# EAGLE schematic pdp8i-io (EAGLE 6.6.0), part 1 of 2

## Sheet 1 of 40
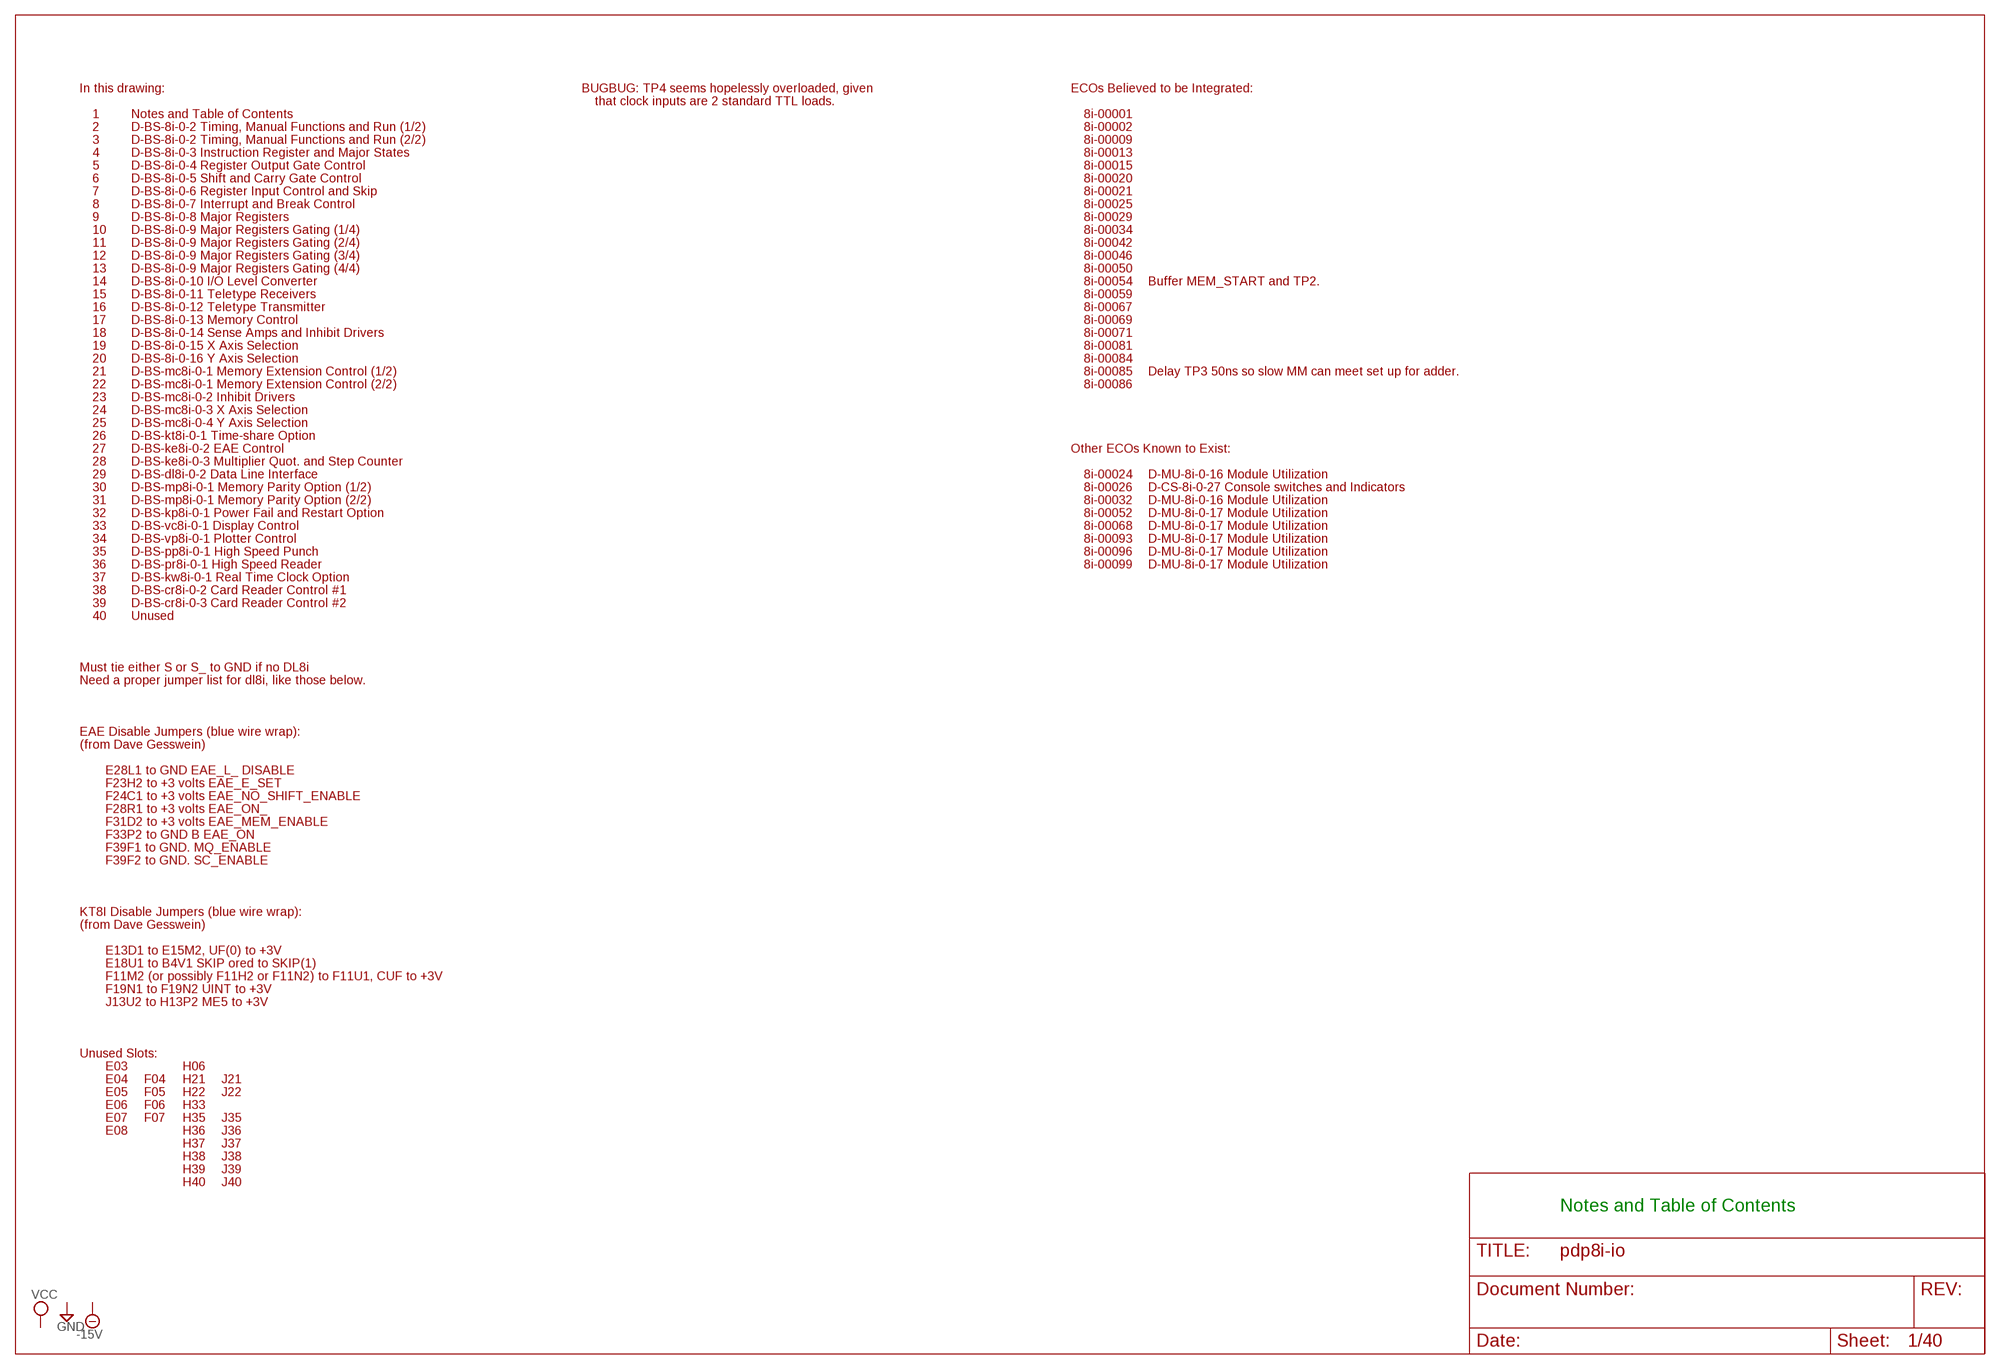
[diagram p0: schematic, sheet 1]

### Parts
E03  EMPTY  [H807]
E04  EMPTY  [H807]
E05  EMPTY  [H807]
E06  EMPTY  [H807]
E07  EMPTY  [H807]
E08  EMPTY  [H807]
F04  EMPTY  [H807]
F05  EMPTY  [H807]
F06  EMPTY  [H807]
F07  EMPTY  [H807]
H06  EMPTY  [H807]
H21  EMPTY  [H807]
H22  EMPTY  [H807]
H33  EMPTY  [H807]
H35  EMPTY  [H807]
H36  EMPTY  [H807]
H37  EMPTY  [H807]
H38  EMPTY  [H807]
H39  EMPTY  [H807]
H40  EMPTY  [H807]
J21  EMPTY  [H807]
J22  EMPTY  [H807]
J35  EMPTY  [H807]
J36  EMPTY  [H807]
J37  EMPTY  [H807]
J38  EMPTY  [H807]
J39  EMPTY  [H807]
J40  EMPTY  [H807]

### Notes on the sheet
- In this drawing: | BUGBUG: TP4 seems hopelessly overloaded, given | ECOs Believed to be Integrated:
- that clock inputs are 2 standard TTL loads.
- 1 | Notes and Table of Contents | 8i-00001
- 2 | D-BS-8i-0-2 Timing, Manual Functions and Run (1/2) | 8i-00002
- 3 | D-BS-8i-0-2 Timing, Manual Functions and Run (2/2) | 8i-00009
- 4 | D-BS-8i-0-3 Instruction Register and Major States | 8i-00013
- 5 | D-BS-8i-0-4 Register Output Gate Control | 8i-00015
- 6 | D-BS-8i-0-5 Shift and Carry Gate Control | 8i-00020
- 7 | D-BS-8i-0-6 Register Input Control and Skip | 8i-00021
- 8 | D-BS-8i-0-7 Interrupt and Break Control | 8i-00025
- 9 | D-BS-8i-0-8 Major Registers | 8i-00029
- 10 | D-BS-8i-0-9 Major Registers Gating (1/4) | 8i-00034
- 11 | D-BS-8i-0-9 Major Registers Gating (2/4) | 8i-00042
- 12 | D-BS-8i-0-9 Major Registers Gating (3/4) | 8i-00046
- 13 | D-BS-8i-0-9 Major Registers Gating (4/4) | 8i-00050
- 14 | D-BS-8i-0-10 I/O Level Converter | 8i-00054 | Buffer MEM_START and TP2.
- 15 | D-BS-8i-0-11 Teletype Receivers | 8i-00059
- 16 | D-BS-8i-0-12 Teletype Transmitter | 8i-00067
- 17 | D-BS-8i-0-13 Memory Control | 8i-00069
- 18 | D-BS-8i-0-14 Sense Amps and Inhibit Drivers | 8i-00071
- 19 | D-BS-8i-0-15 X Axis Selection | 8i-00081
- 20 | D-BS-8i-0-16 Y Axis Selection | 8i-00084
- 21 | D-BS-mc8i-0-1 Memory Extension Control (1/2) | 8i-00085 | Delay TP3 50ns so slow MM can meet set up for adder.
- 22 | D-BS-mc8i-0-1 Memory Extension Control (2/2) | 8i-00086
- 23 | D-BS-mc8i-0-2 Inhibit Drivers
- 24 | D-BS-mc8i-0-3 X Axis Selection
- 25 | D-BS-mc8i-0-4 Y Axis Selection
- 26 | D-BS-kt8i-0-1 Time-share Option
- 27 | D-BS-ke8i-0-2 EAE Control | Other ECOs Known to Exist:
- 28 | D-BS-ke8i-0-3 Multiplier Quot. and Step Counter
- 29 | D-BS-dl8i-0-2 Data Line Interface | 8i-00024 | D-MU-8i-0-16 Module Utilization
- 30 | D-BS-mp8i-0-1 Memory Parity Option (1/2) | 8i-00026 | D-CS-8i-0-27 Console switches and Indicators
- 31 | D-BS-mp8i-0-1 Memory Parity Option (2/2) | 8i-00032 | D-MU-8i-0-16 Module Utilization
- 32 | D-BS-kp8i-0-1 Power Fail and Restart Option | 8i-00052 | D-MU-8i-0-17 Module Utilization
- 33 | D-BS-vc8i-0-1 Display Control | 8i-00068 | D-MU-8i-0-17 Module Utilization
- 34 | D-BS-vp8i-0-1 Plotter Control | 8i-00093 | D-MU-8i-0-17 Module Utilization
- 35 | D-BS-pp8i-0-1 High Speed Punch | 8i-00096 | D-MU-8i-0-17 Module Utilization
- 36 | D-BS-pr8i-0-1 High Speed Reader | 8i-00099 | D-MU-8i-0-17 Module Utilization
- 37 | D-BS-kw8i-0-1 Real Time Clock Option
- 38 | D-BS-cr8i-0-2 Card Reader Control #1
- 39 | D-BS-cr8i-0-3 Card Reader Control #2
- 40 | Unused
- Must tie either S or S_ to GND if no DL8i
- Need a proper jumper list for dl8i, like those below.
- EAE Disable Jumpers (blue wire wrap):
- (from Dave Gesswein)
- E28L1 to GND EAE_L_ DISABLE
- F23H2 to +3 volts EAE_E_SET
- F24C1 to +3 volts EAE_NO_SHIFT_ENABLE
- F28R1 to +3 volts EAE_ON_
- F31D2 to +3 volts EAE_MEM_ENABLE
- F33P2 to GND B EAE_ON
- F39F1 to GND. MQ_ENABLE
- F39F2 to GND. SC_ENABLE
- KT8I Disable Jumpers (blue wire wrap):
- (from Dave Gesswein)
- E13D1 to E15M2, UF(0) to +3V
- E18U1 to B4V1 SKIP ored to SKIP(1)
- F11M2 (or possibly F11H2 or F11N2) to F11U1, CUF to +3V
- F19N1 to F19N2 UINT to +3V
- J13U2 to H13P2 ME5 to +3V
- Unused Slots:
- Notes and Table of Contents

## Sheet 2 of 40
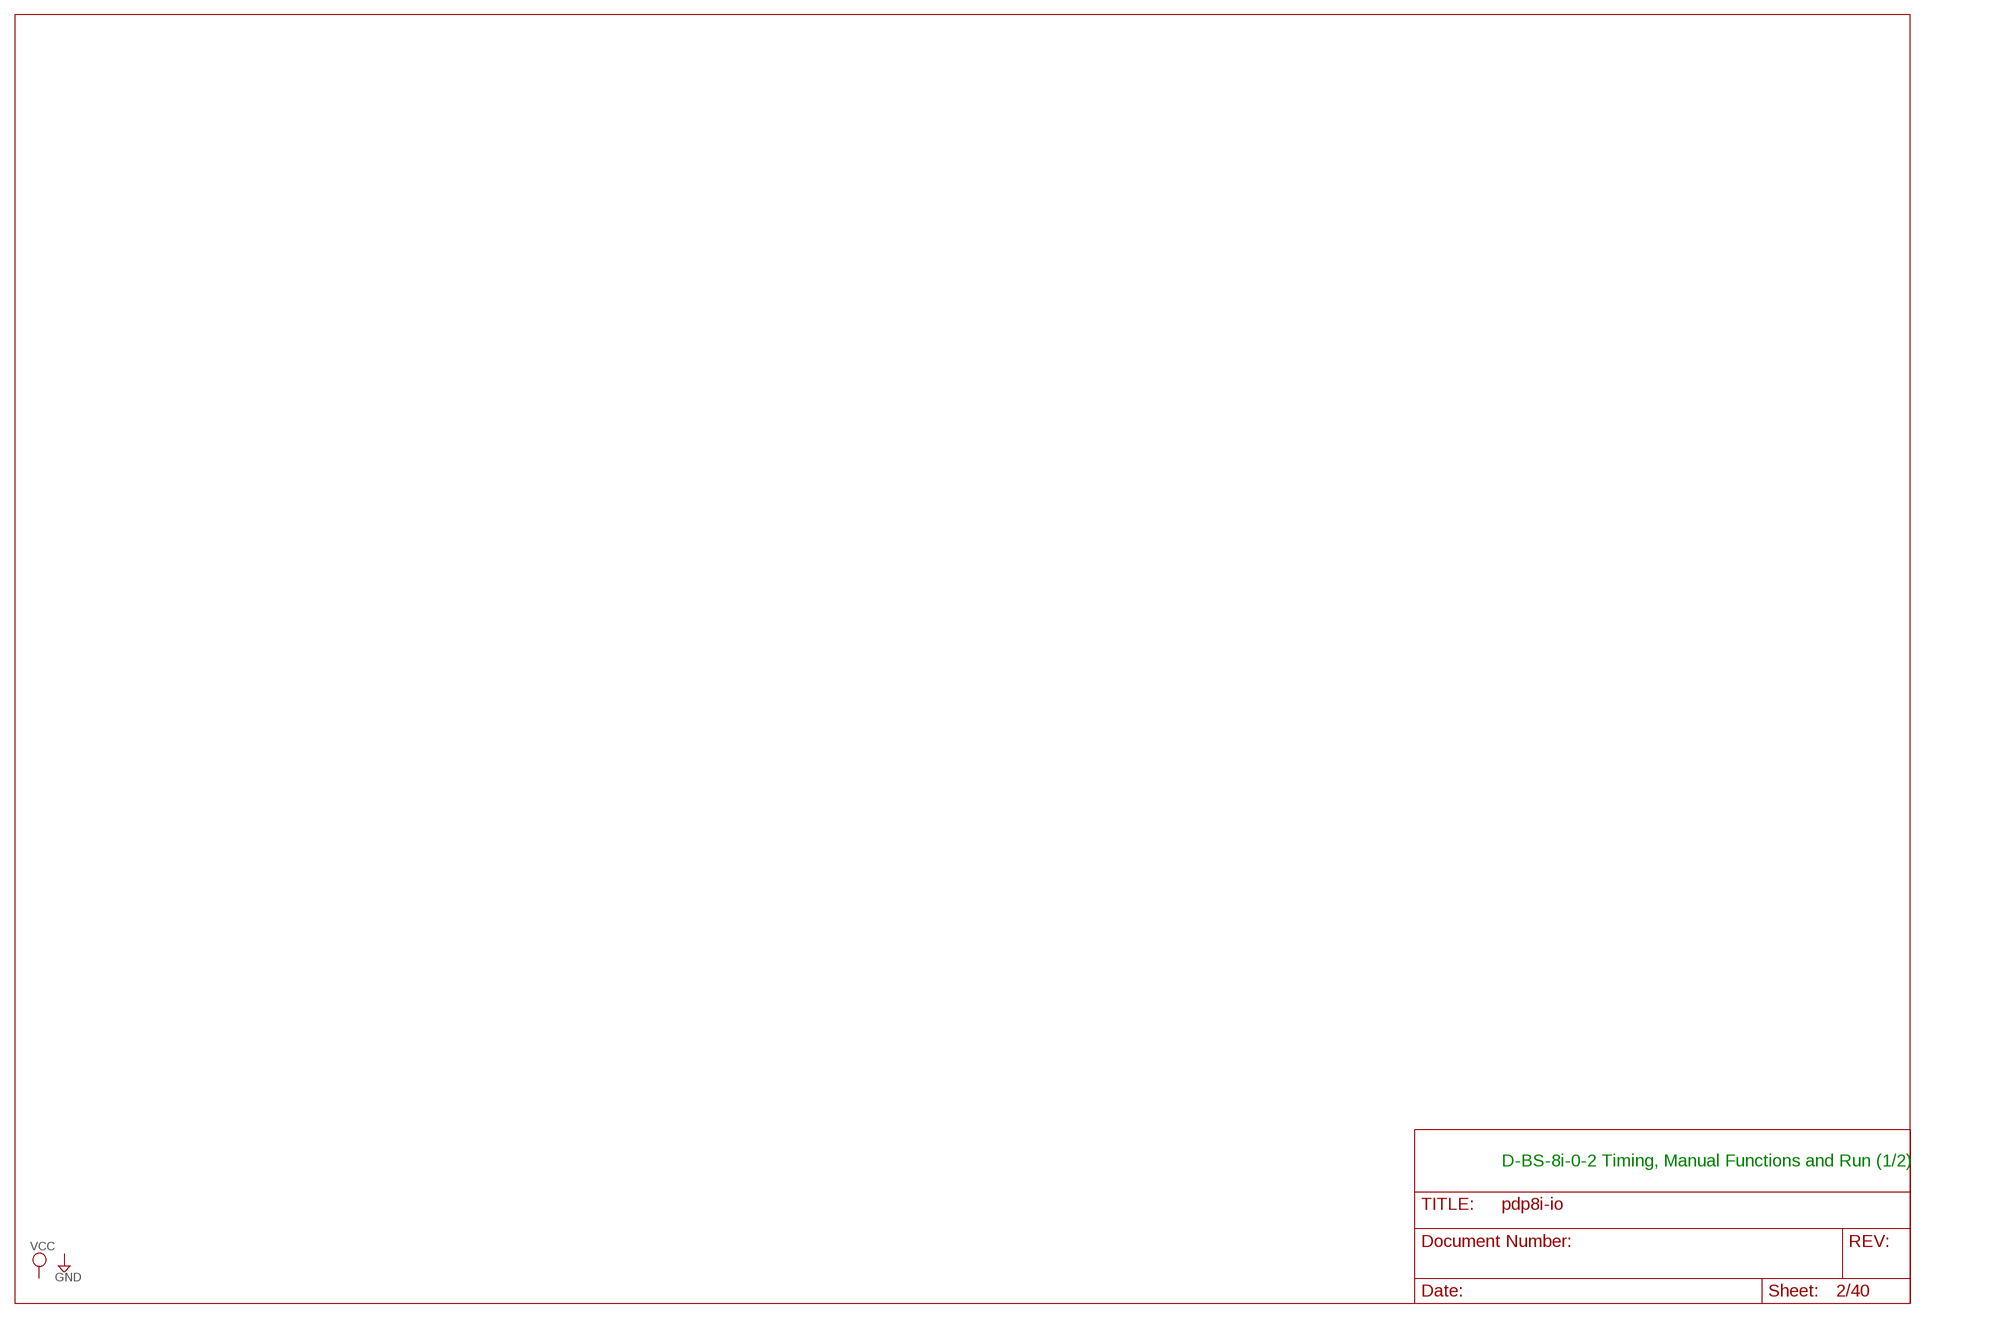
[diagram p1: schematic, sheet 2]

### Notes on the sheet
- D-BS-8i-0-2 Timing, Manual Functions and Run (1/2)

## Sheet 3 of 40
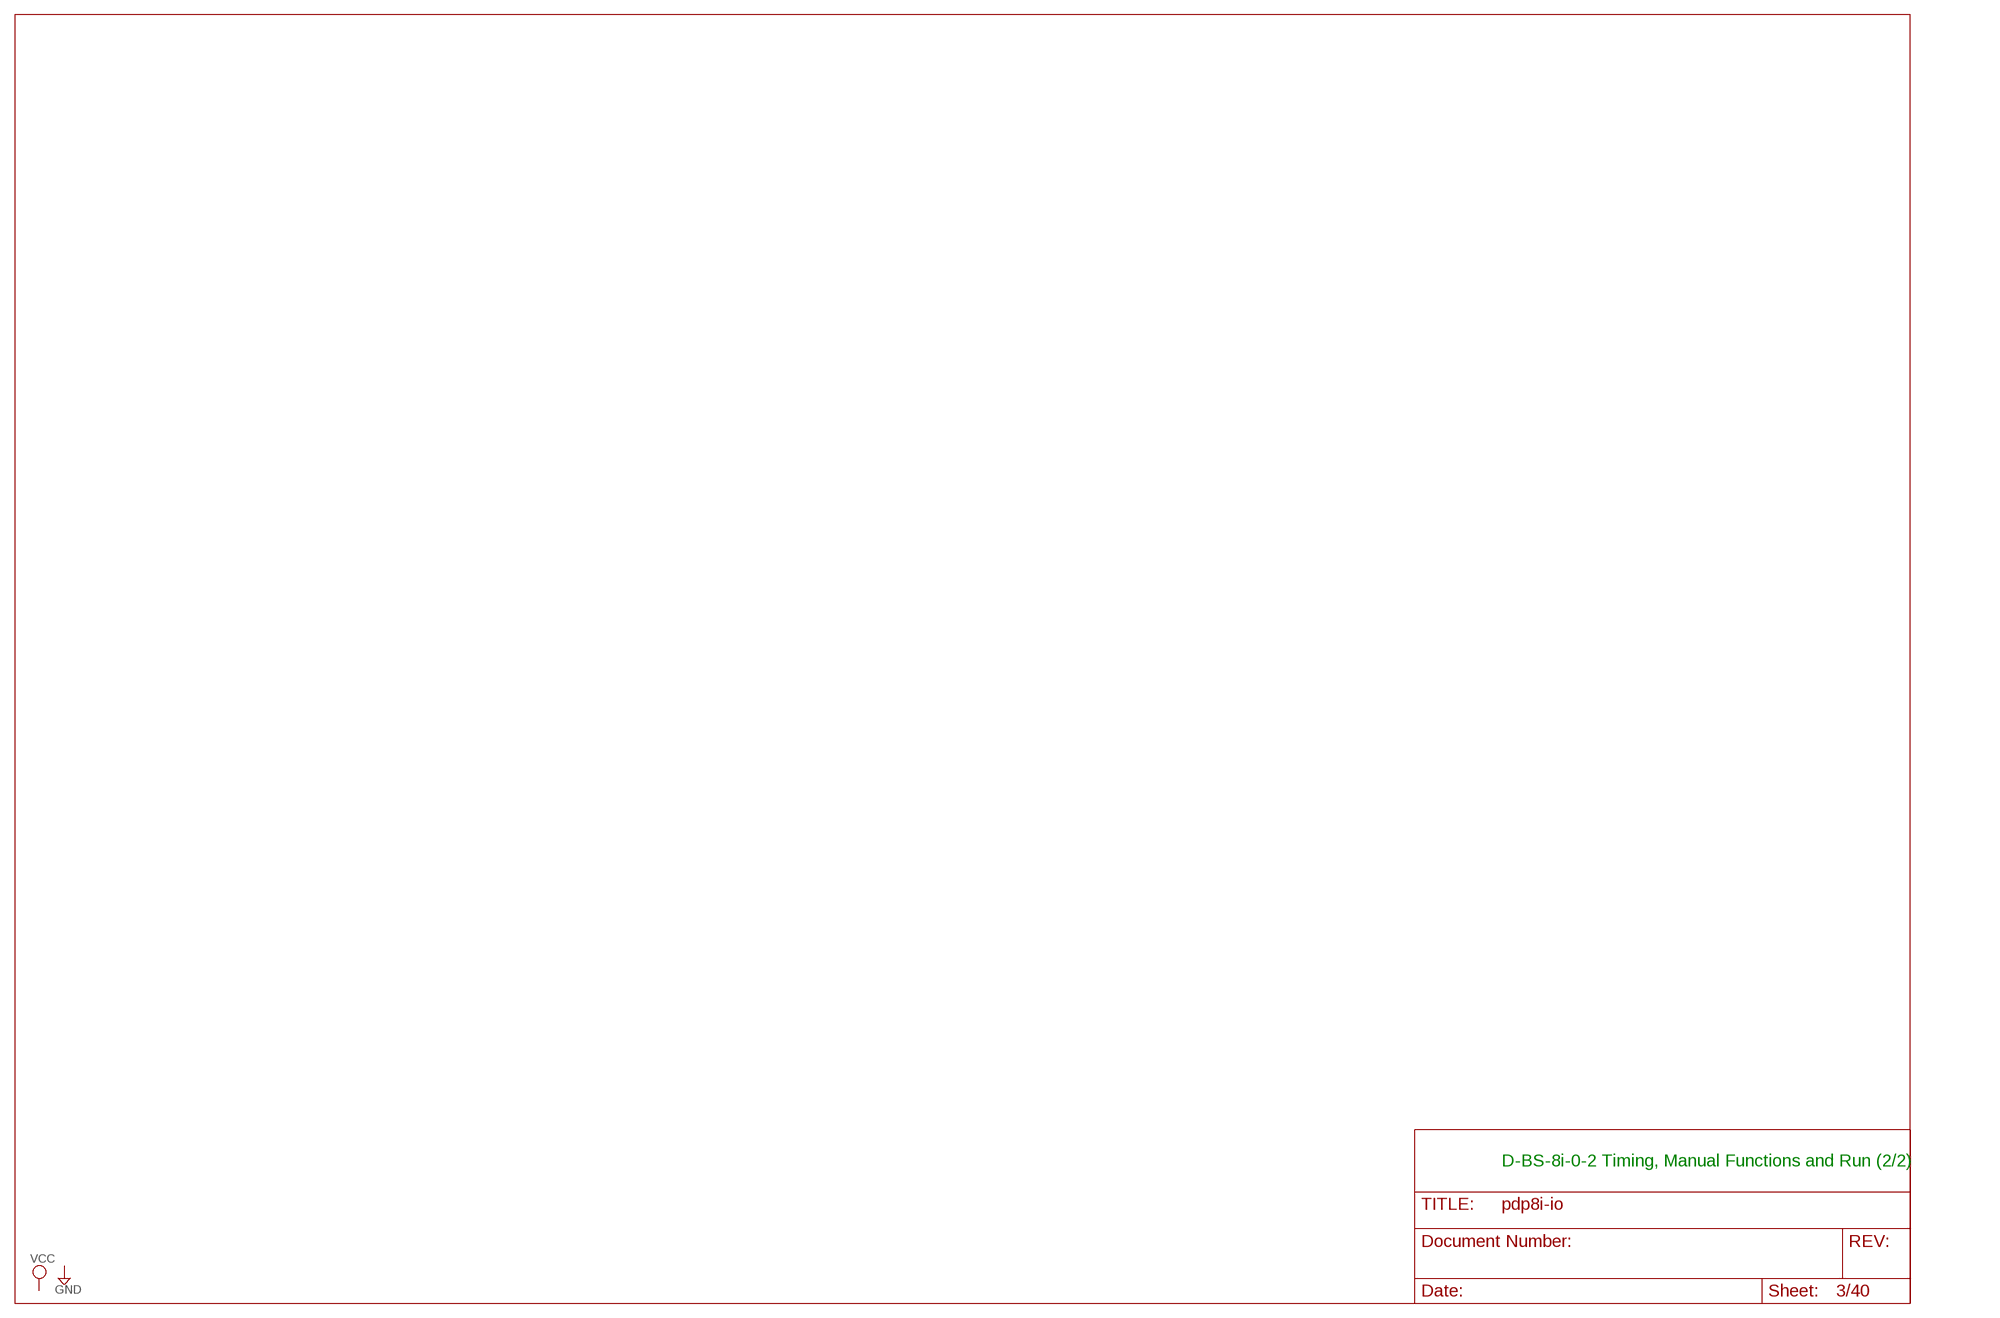
[diagram p2: schematic, sheet 3]

### Notes on the sheet
- D-BS-8i-0-2 Timing, Manual Functions and Run (2/2)

## Sheet 4 of 40
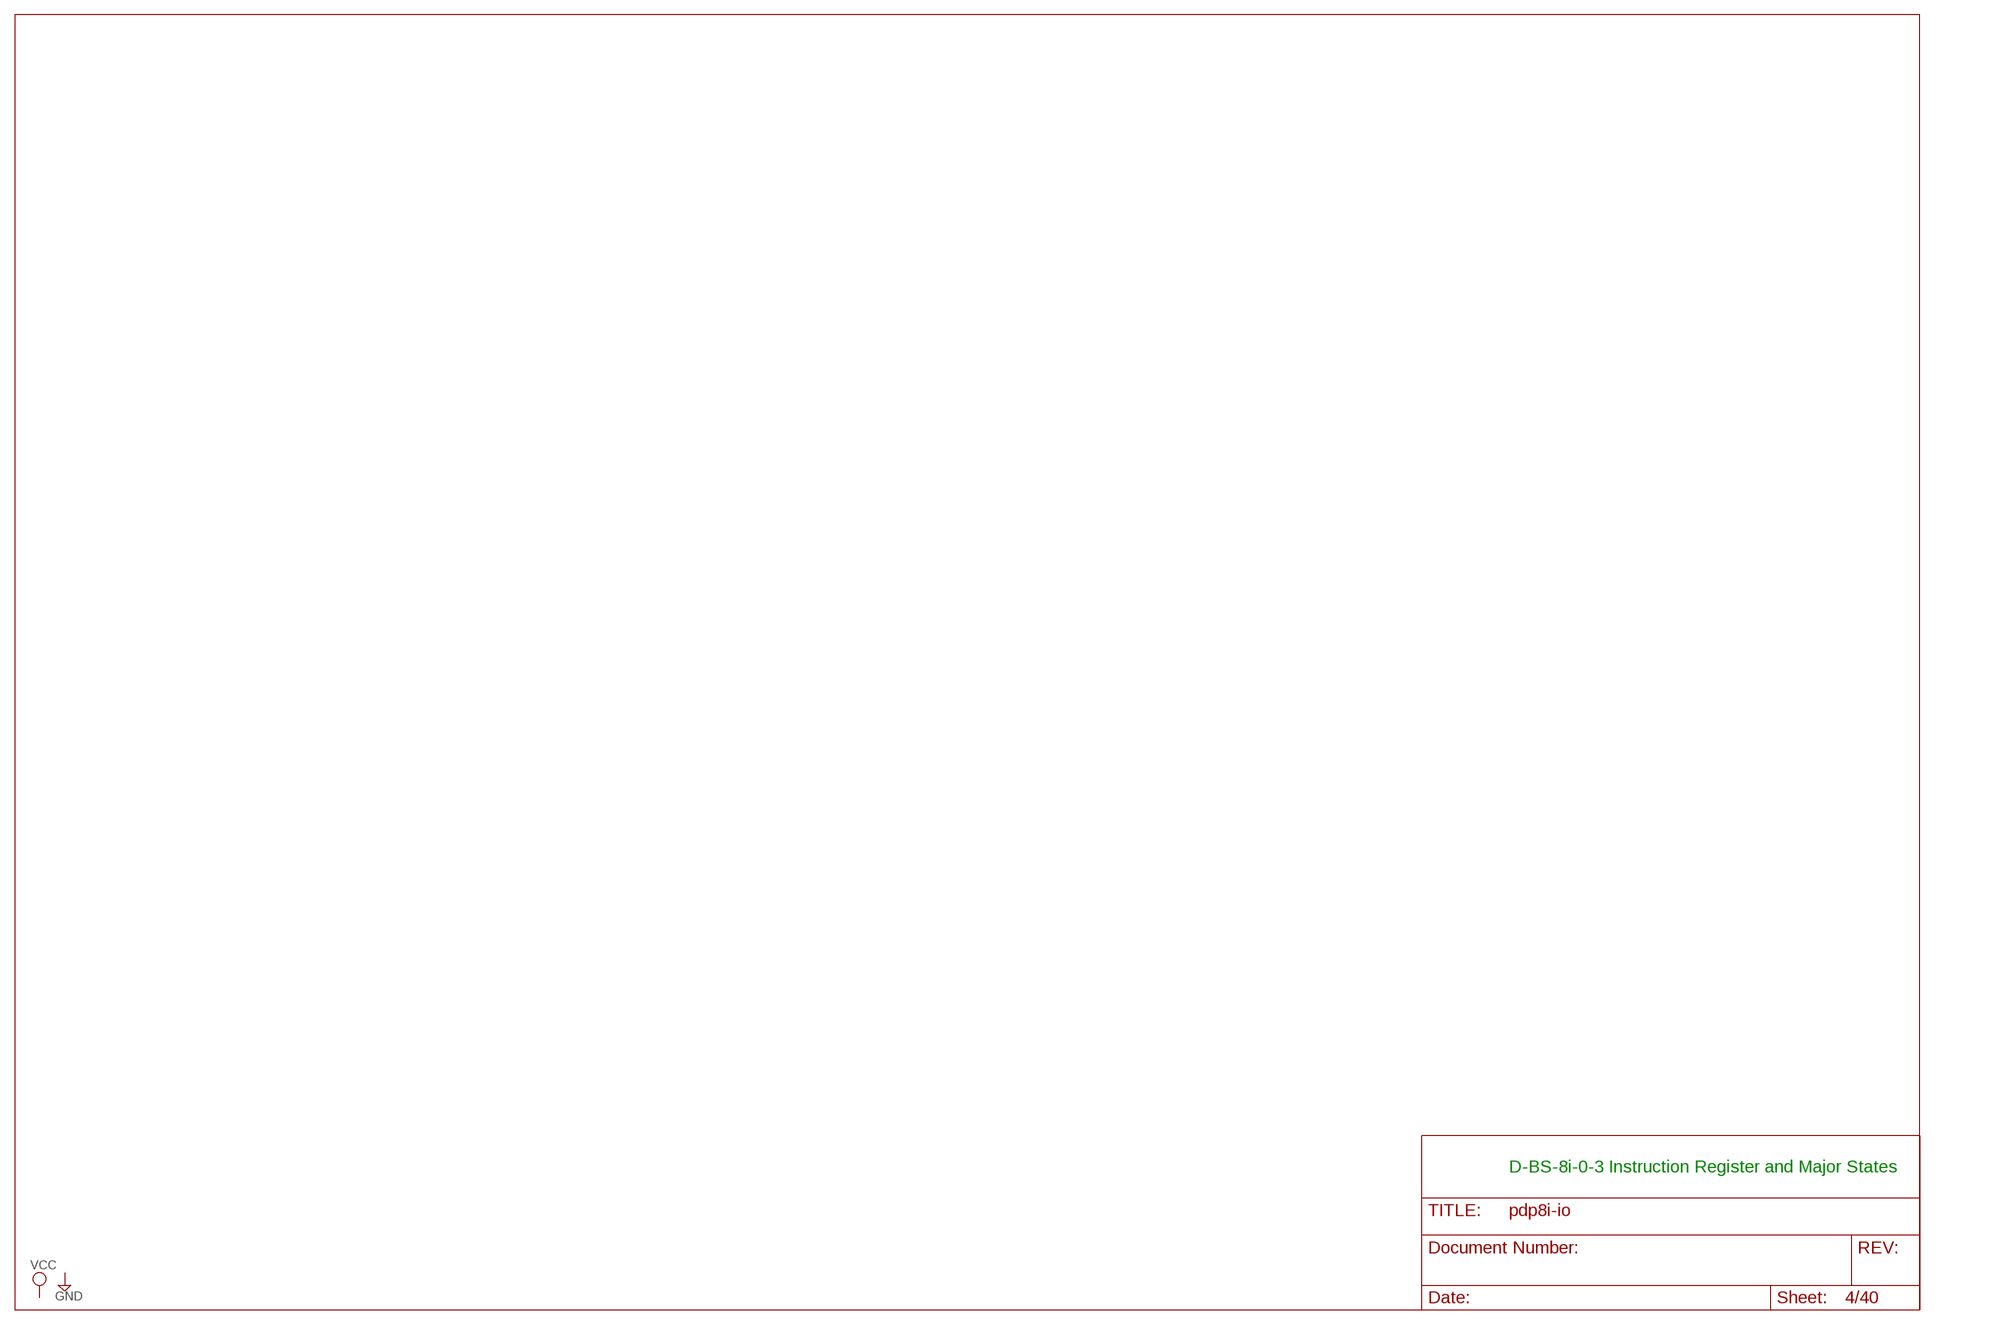
[diagram p3: schematic, sheet 4]

### Notes on the sheet
- D-BS-8i-0-3 Instruction Register and Major States

## Sheet 5 of 40
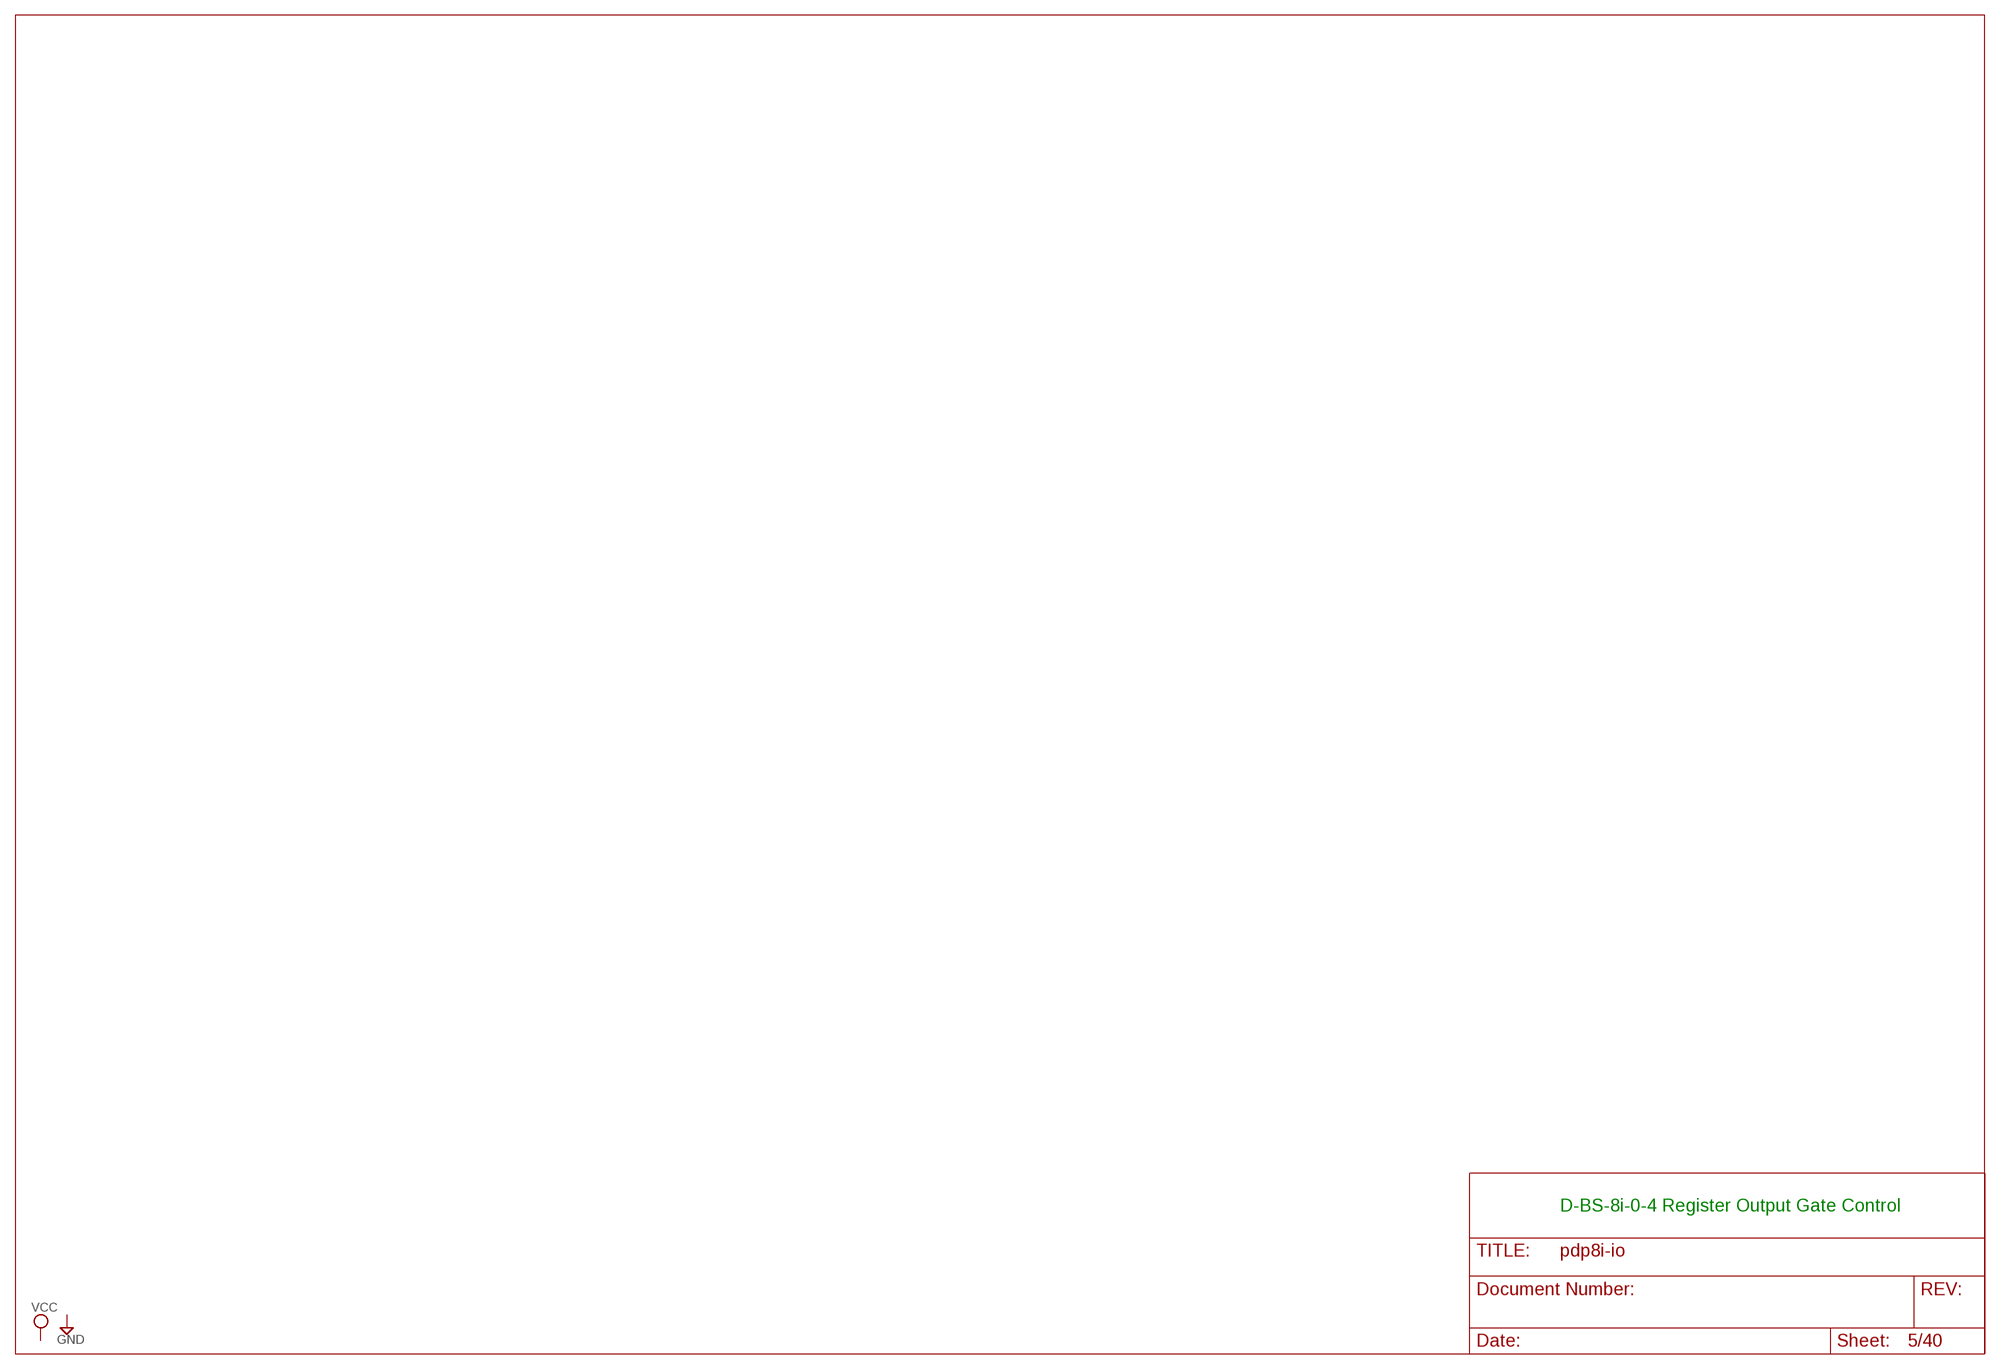
[diagram p4: schematic, sheet 5]

### Notes on the sheet
- D-BS-8i-0-4 Register Output Gate Control

## Sheet 6 of 40
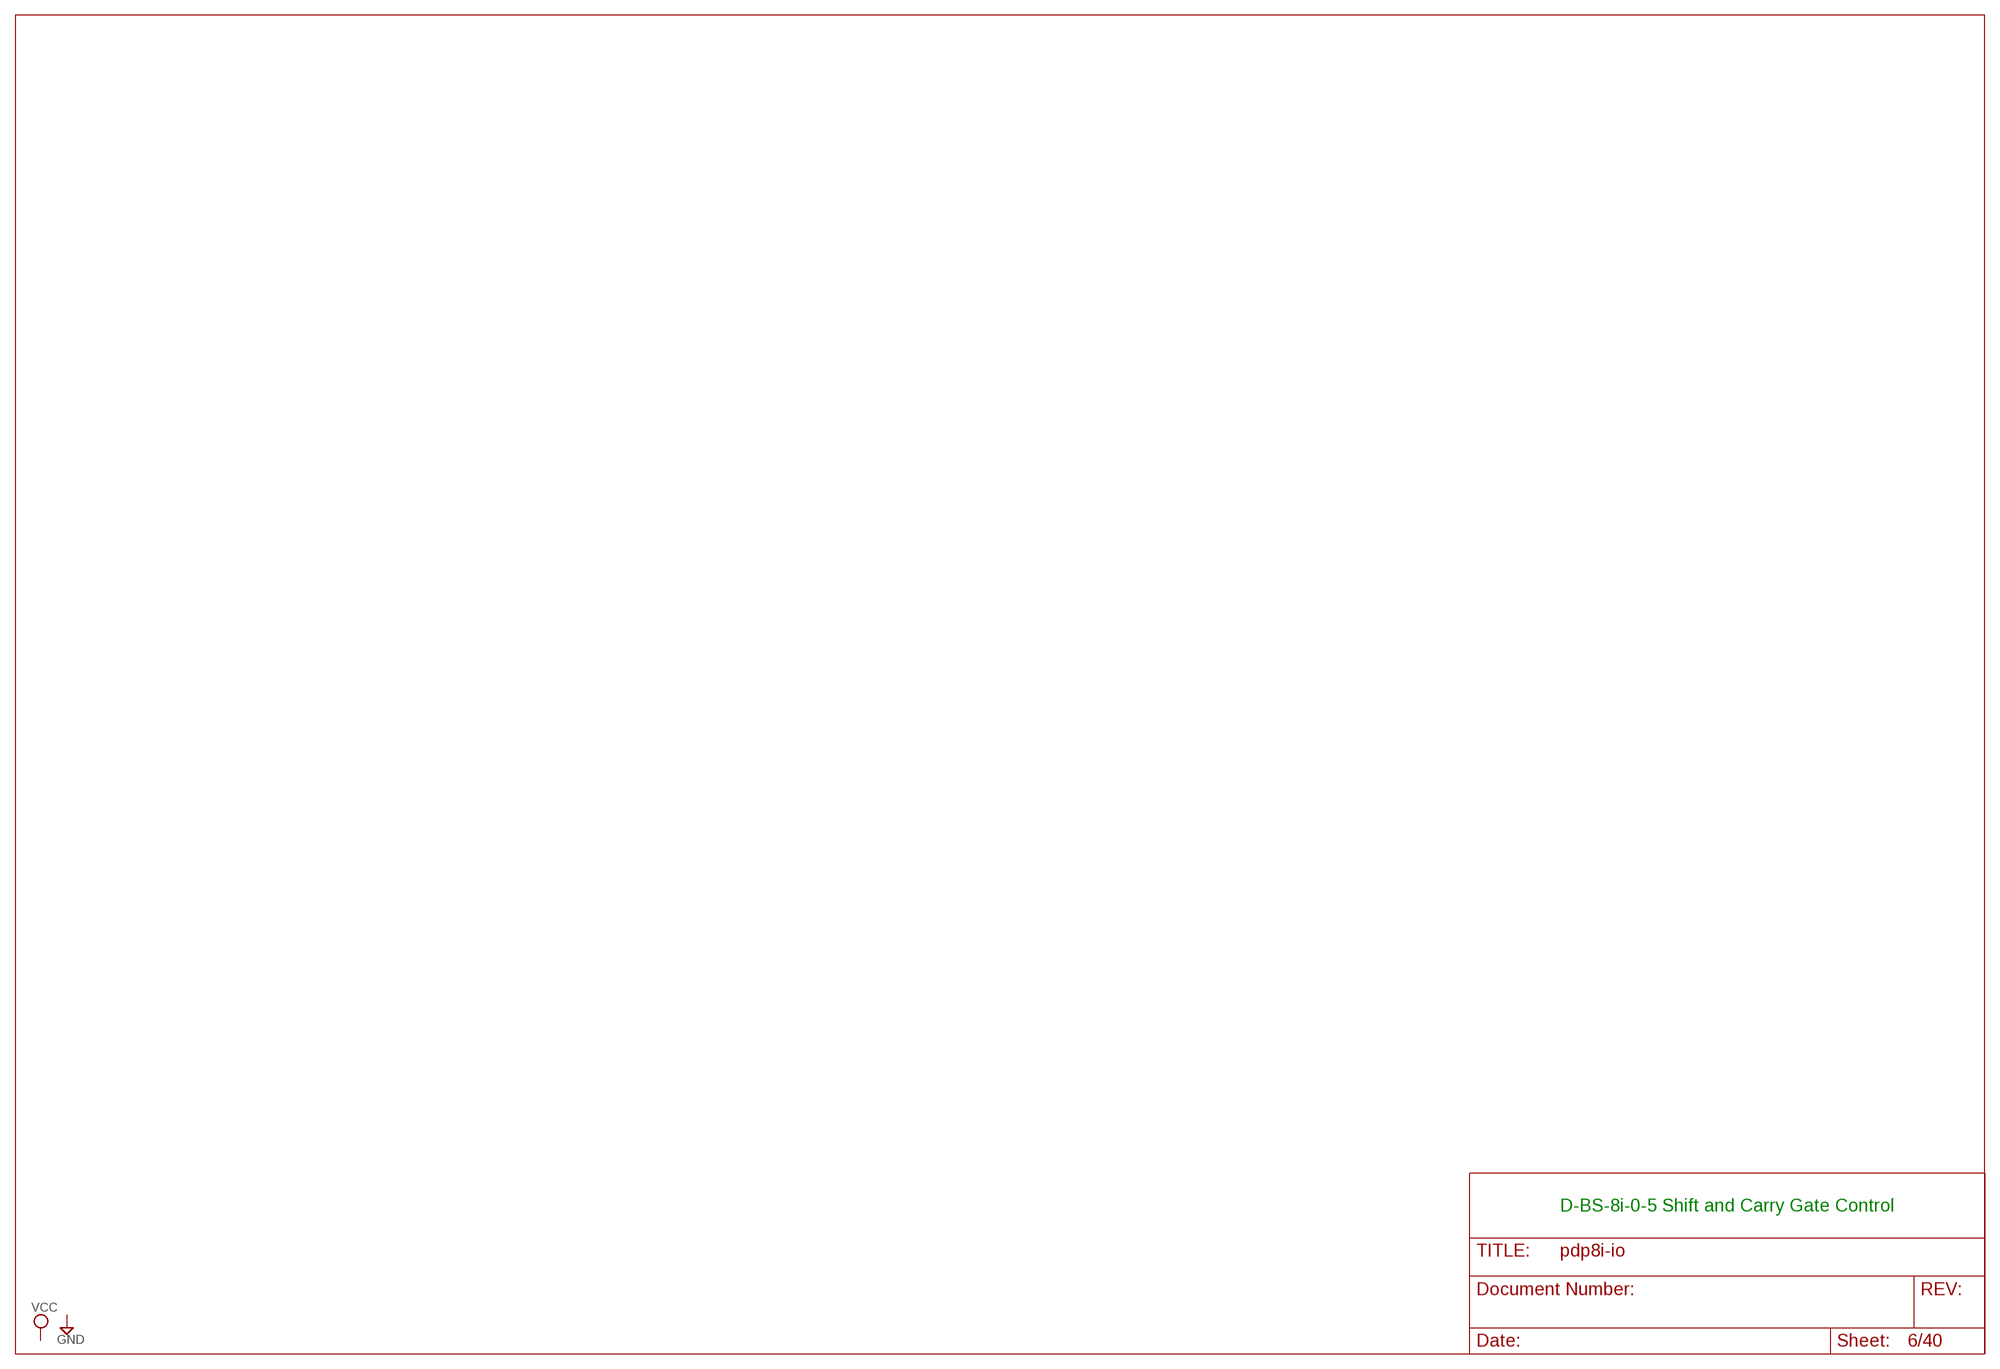
[diagram p5: schematic, sheet 6]

### Notes on the sheet
- D-BS-8i-0-5 Shift and Carry Gate Control

## Sheet 7 of 40
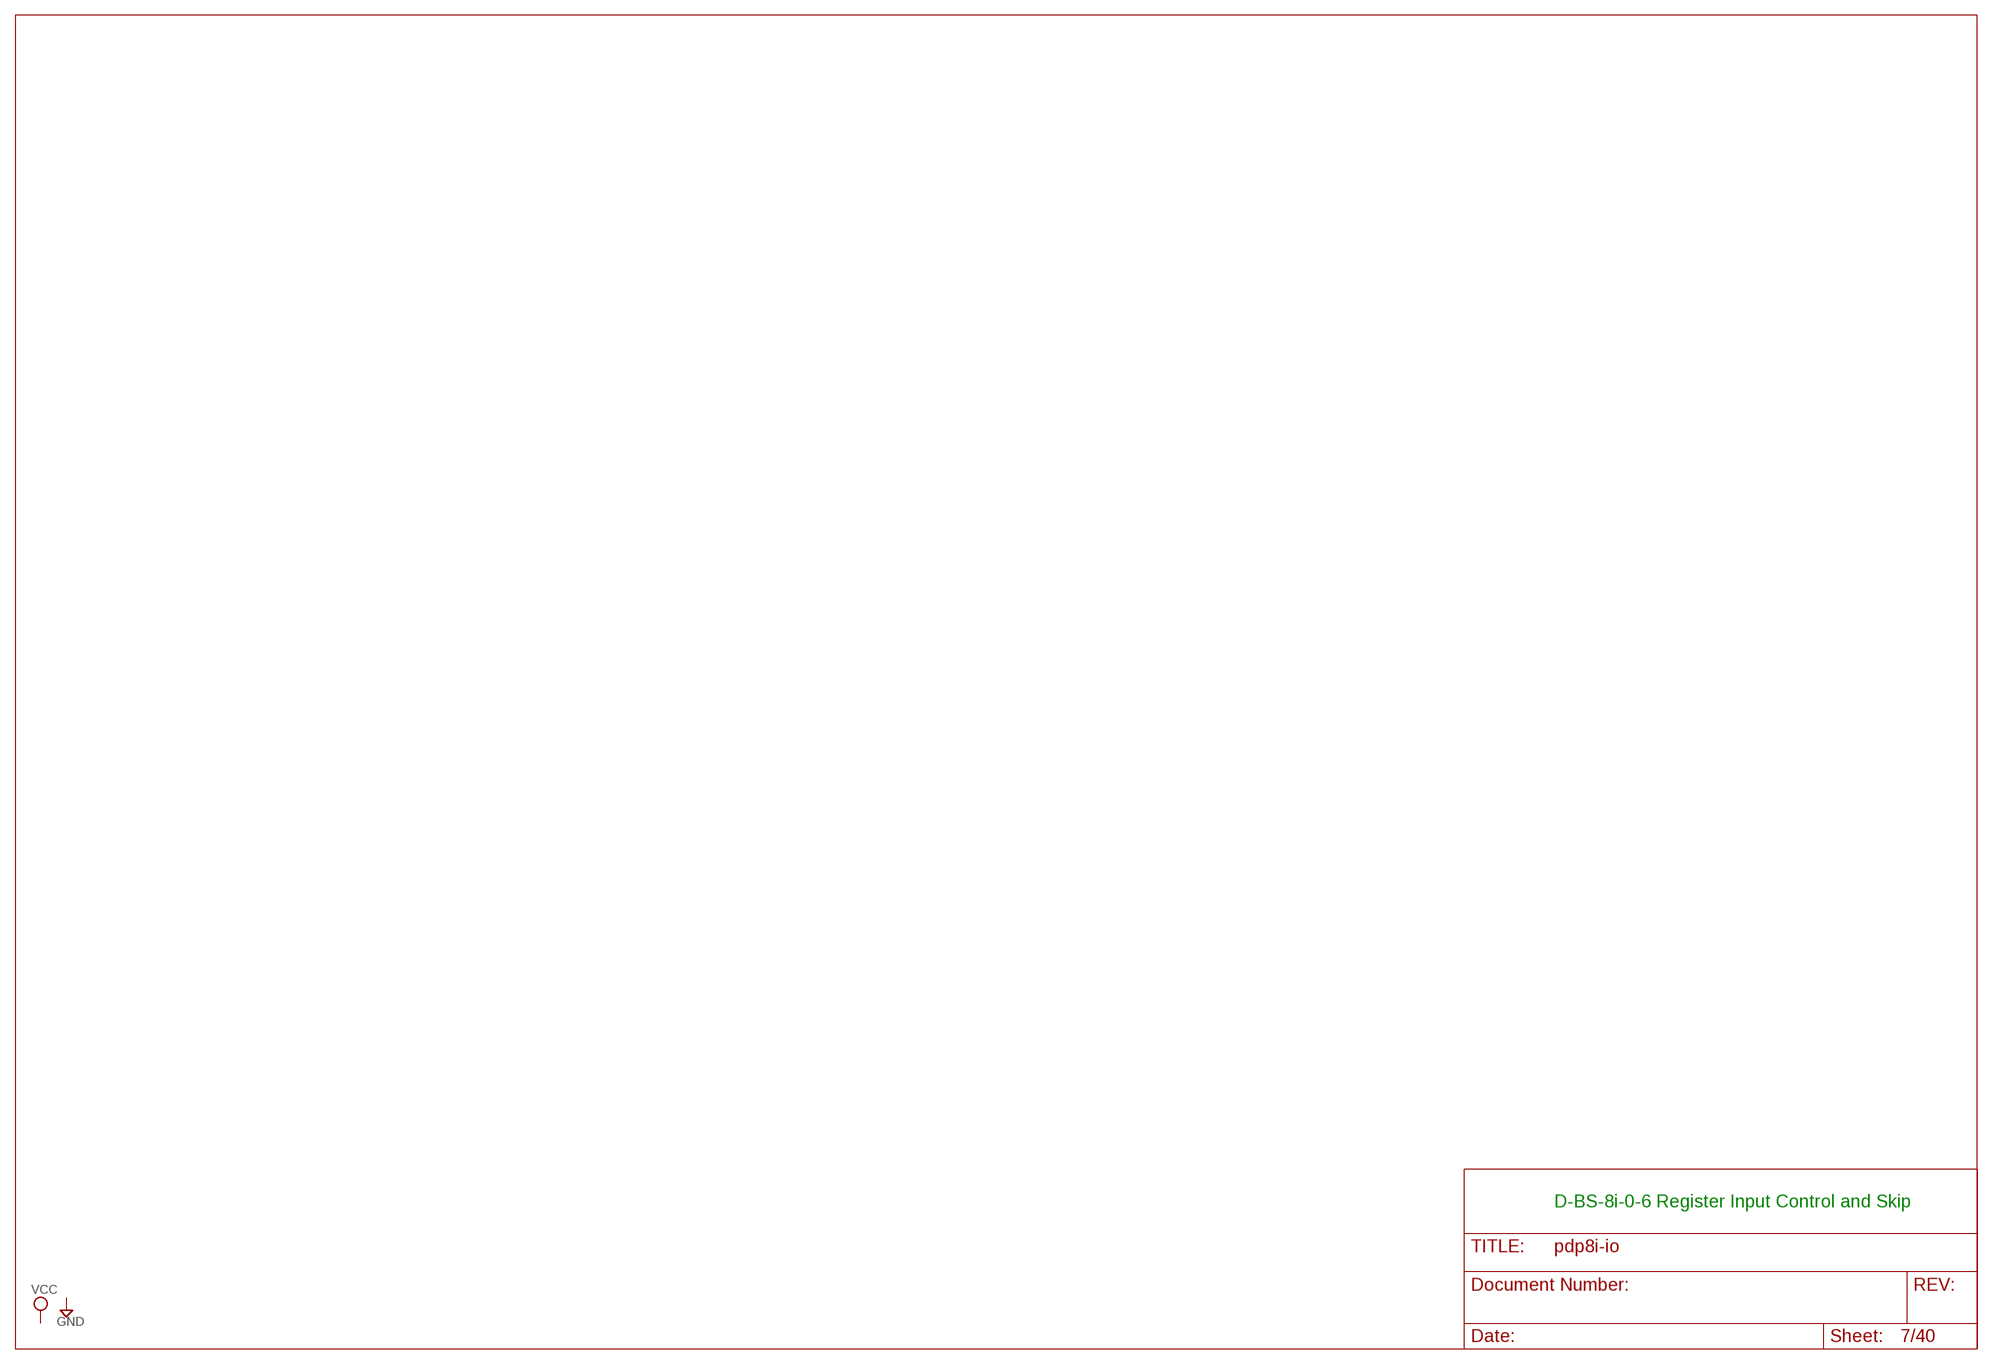
[diagram p6: schematic, sheet 7]

### Notes on the sheet
- D-BS-8i-0-6 Register Input Control and Skip

## Sheet 8 of 40
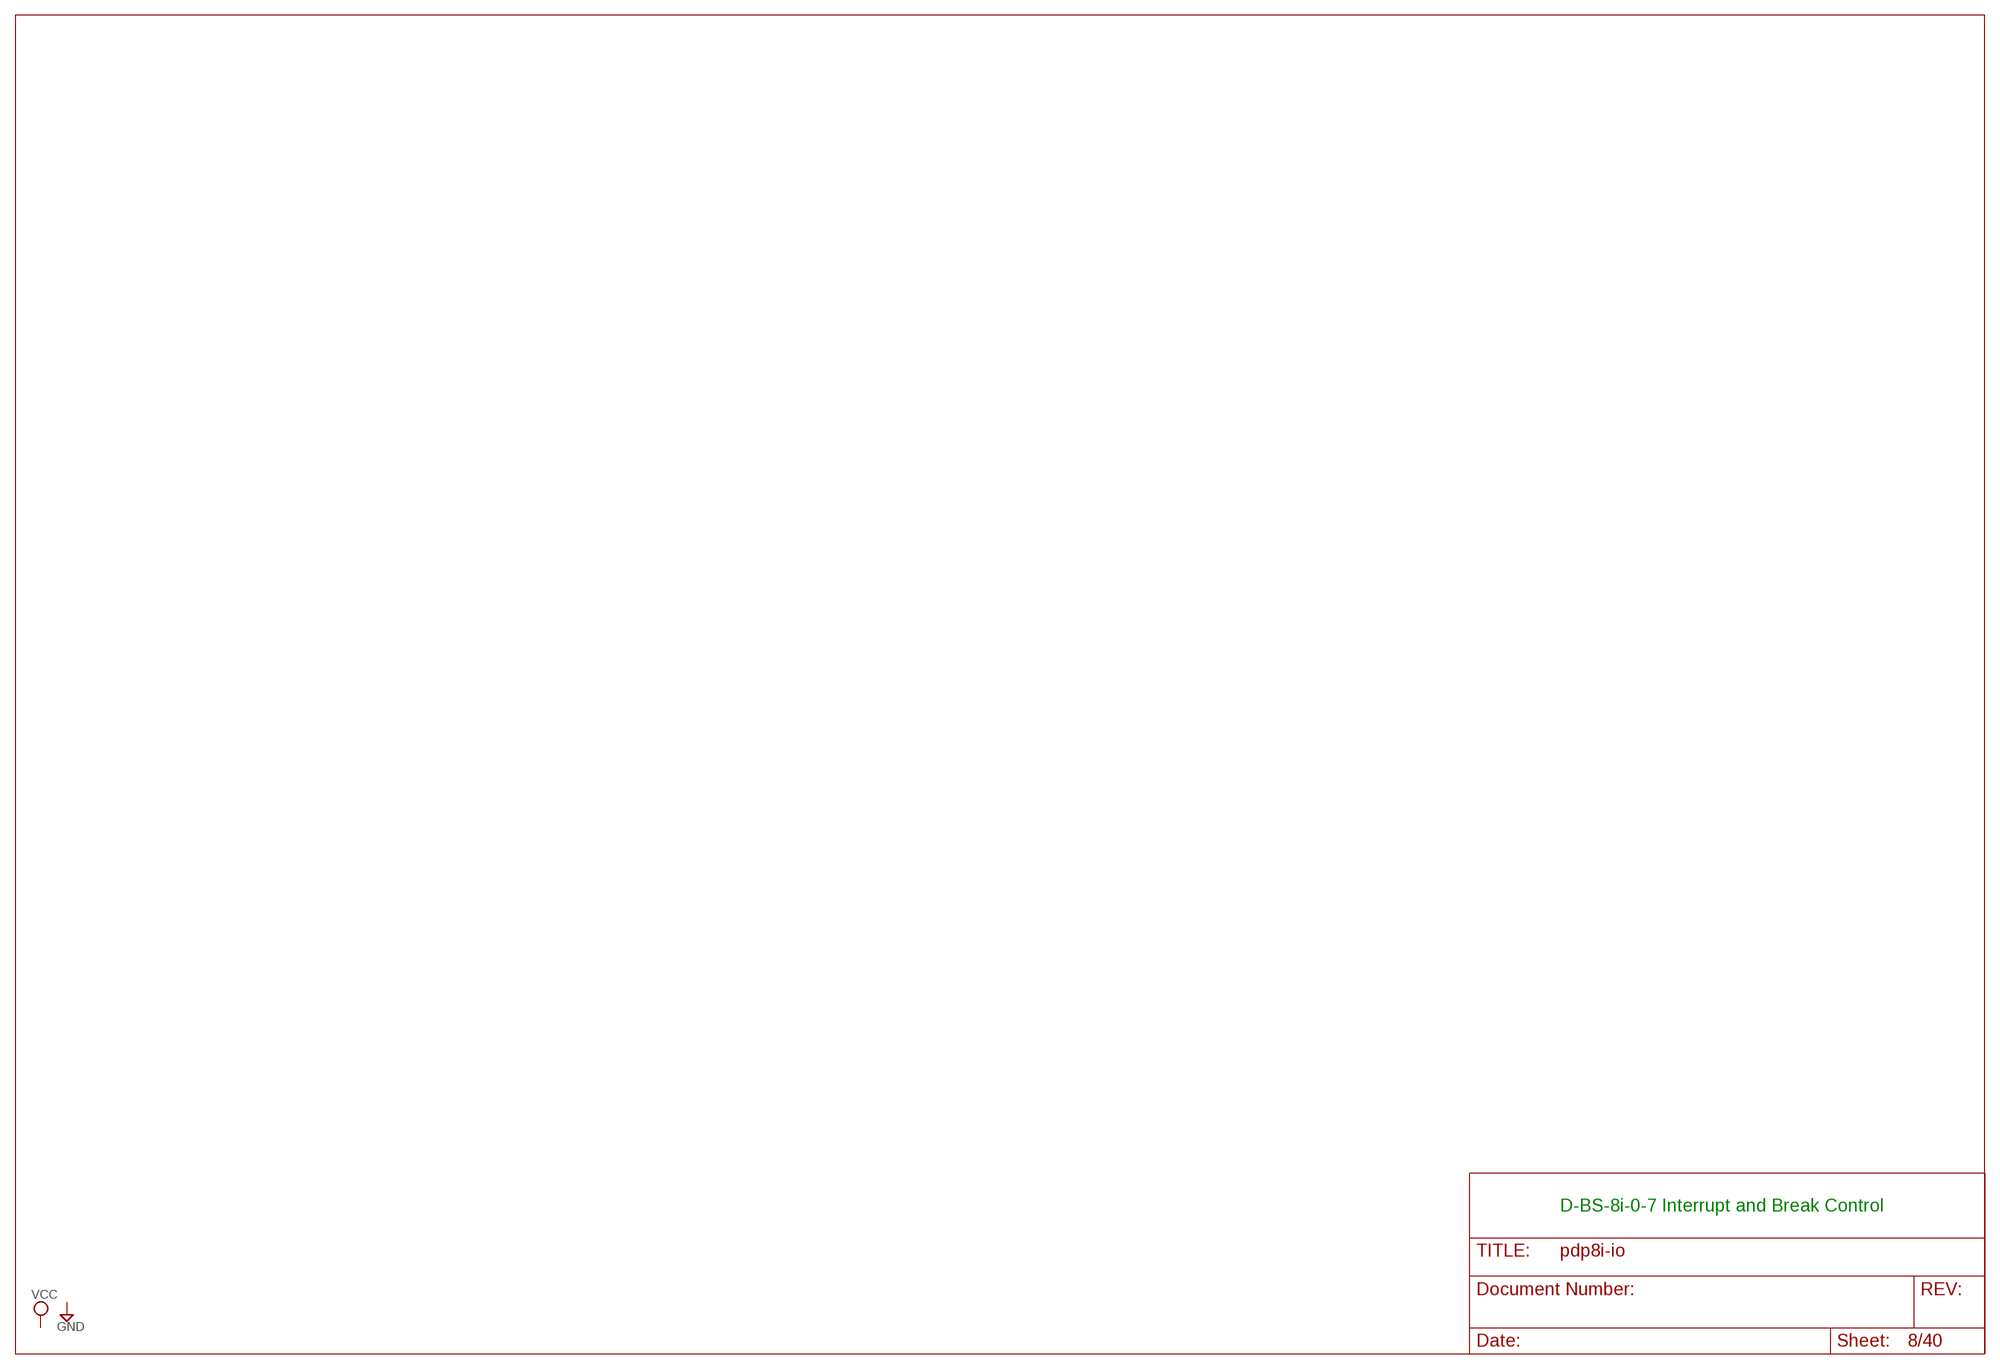
[diagram p7: schematic, sheet 8]

### Notes on the sheet
- D-BS-8i-0-7 Interrupt and Break Control

## Sheet 9 of 40
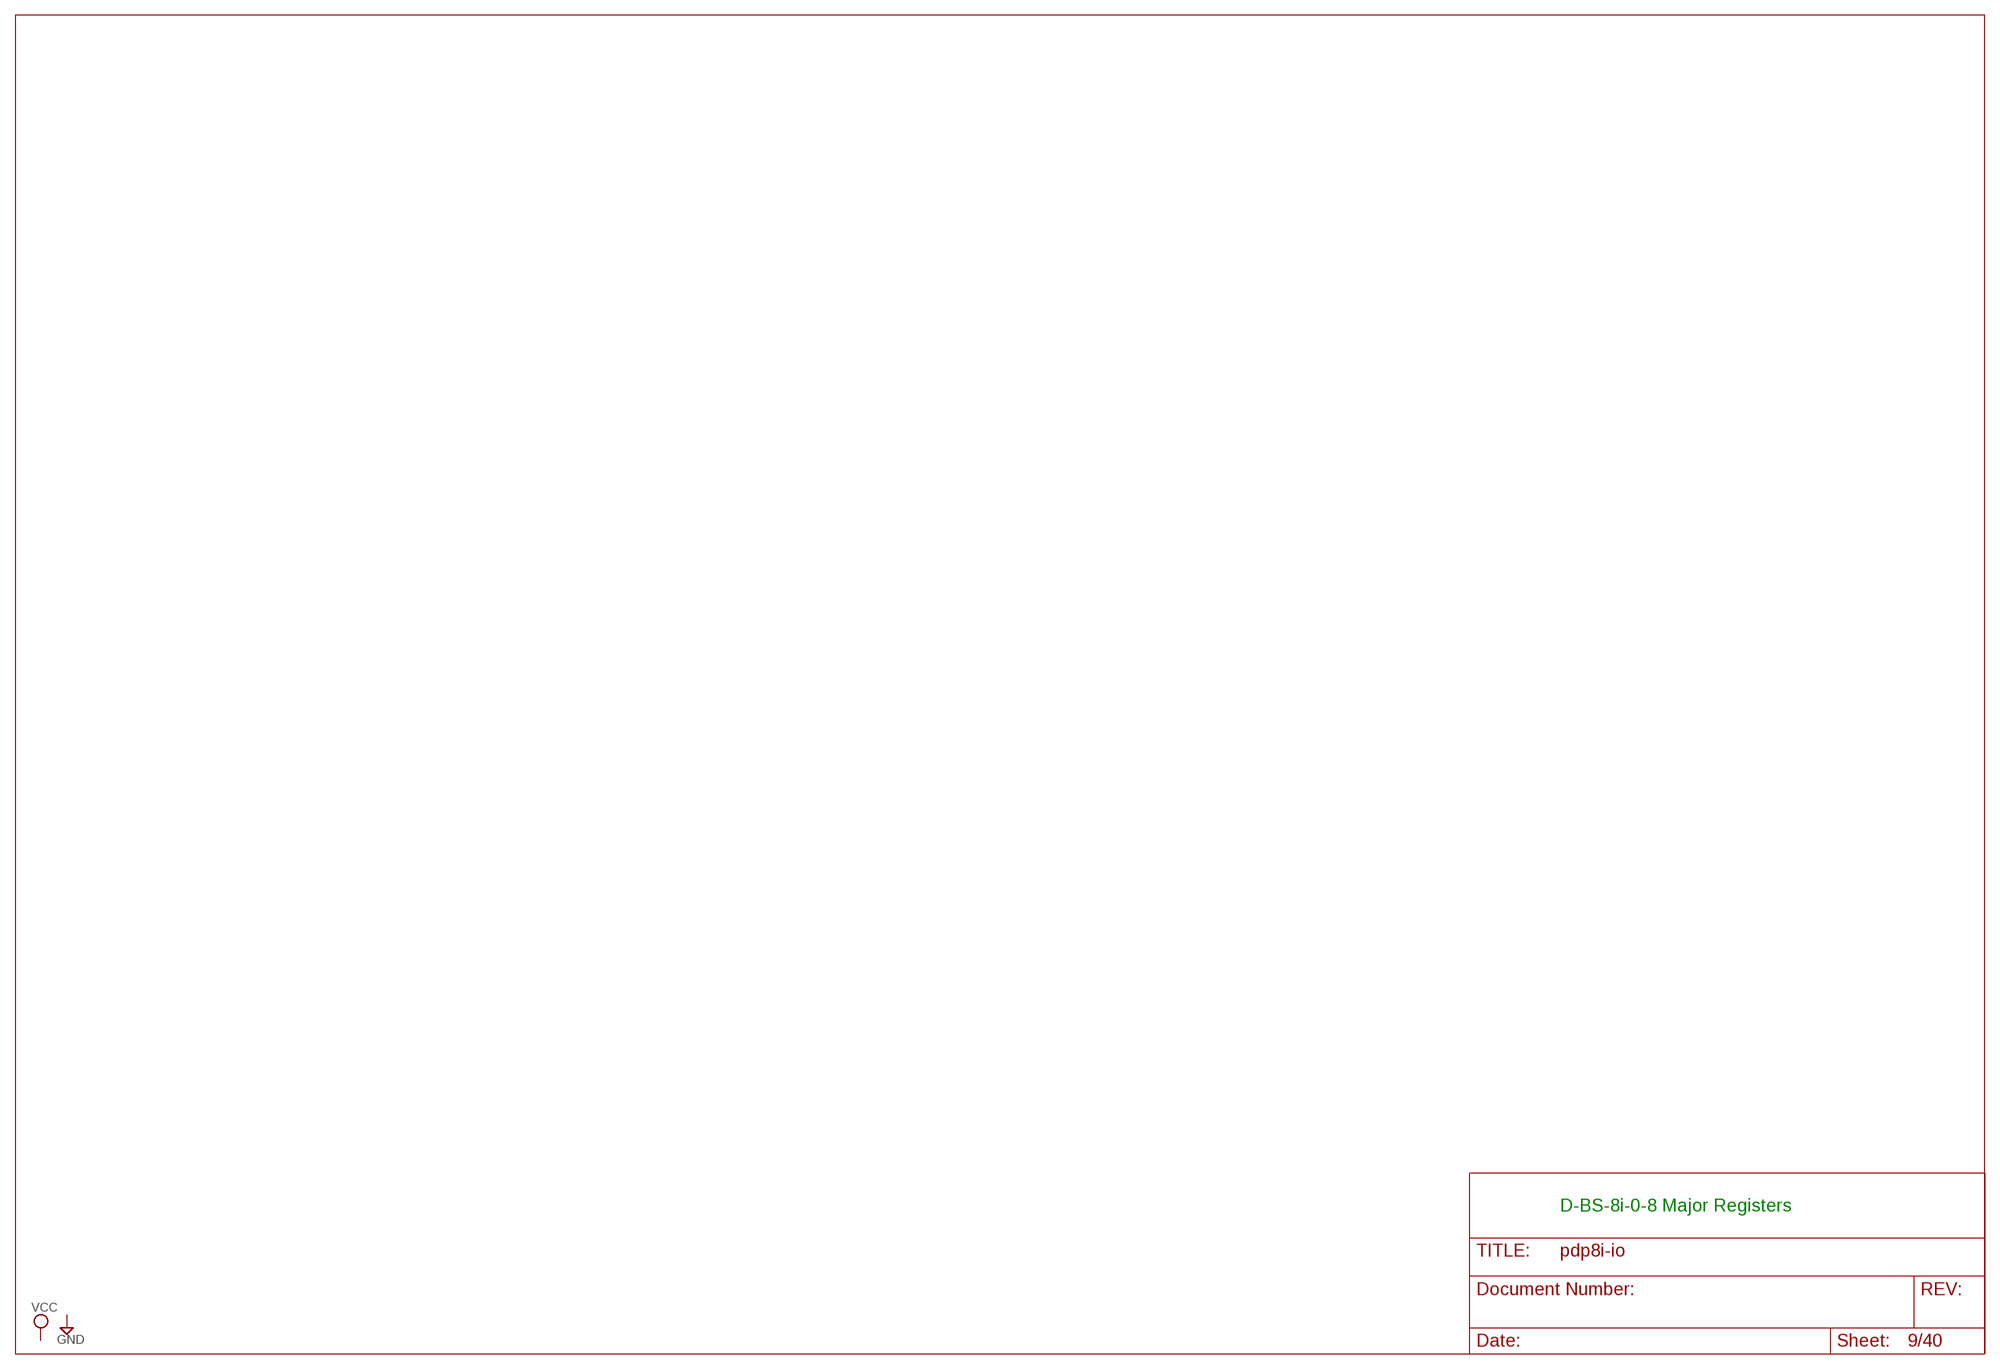
[diagram p8: schematic, sheet 9]

### Notes on the sheet
- D-BS-8i-0-8 Major Registers

## Sheet 10 of 40
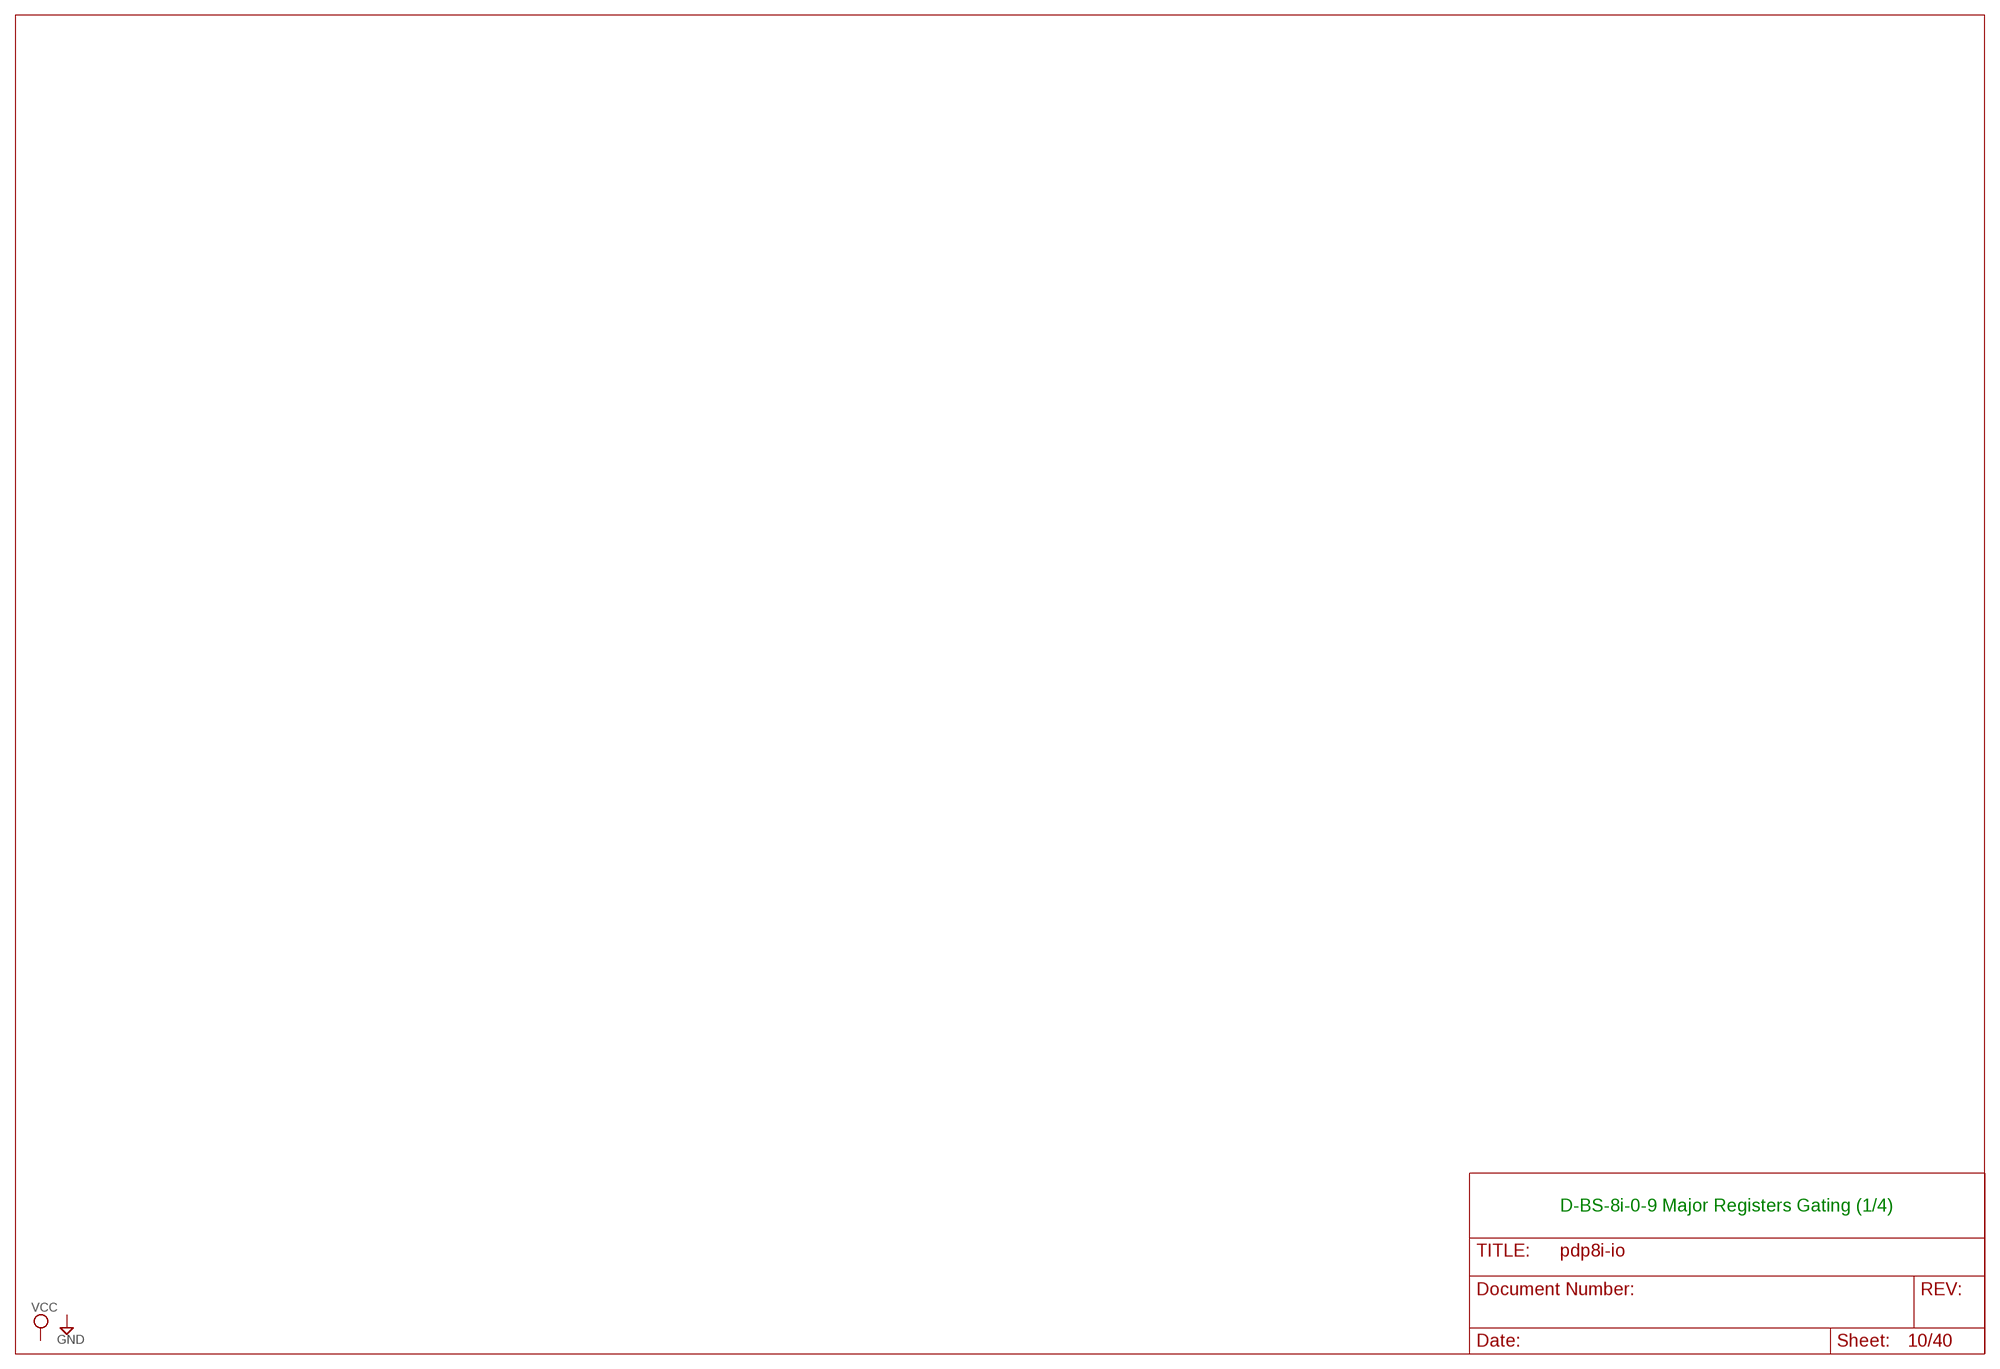
[diagram p9: schematic, sheet 10]

### Notes on the sheet
- D-BS-8i-0-9 Major Registers Gating (1/4)

## Sheet 11 of 40
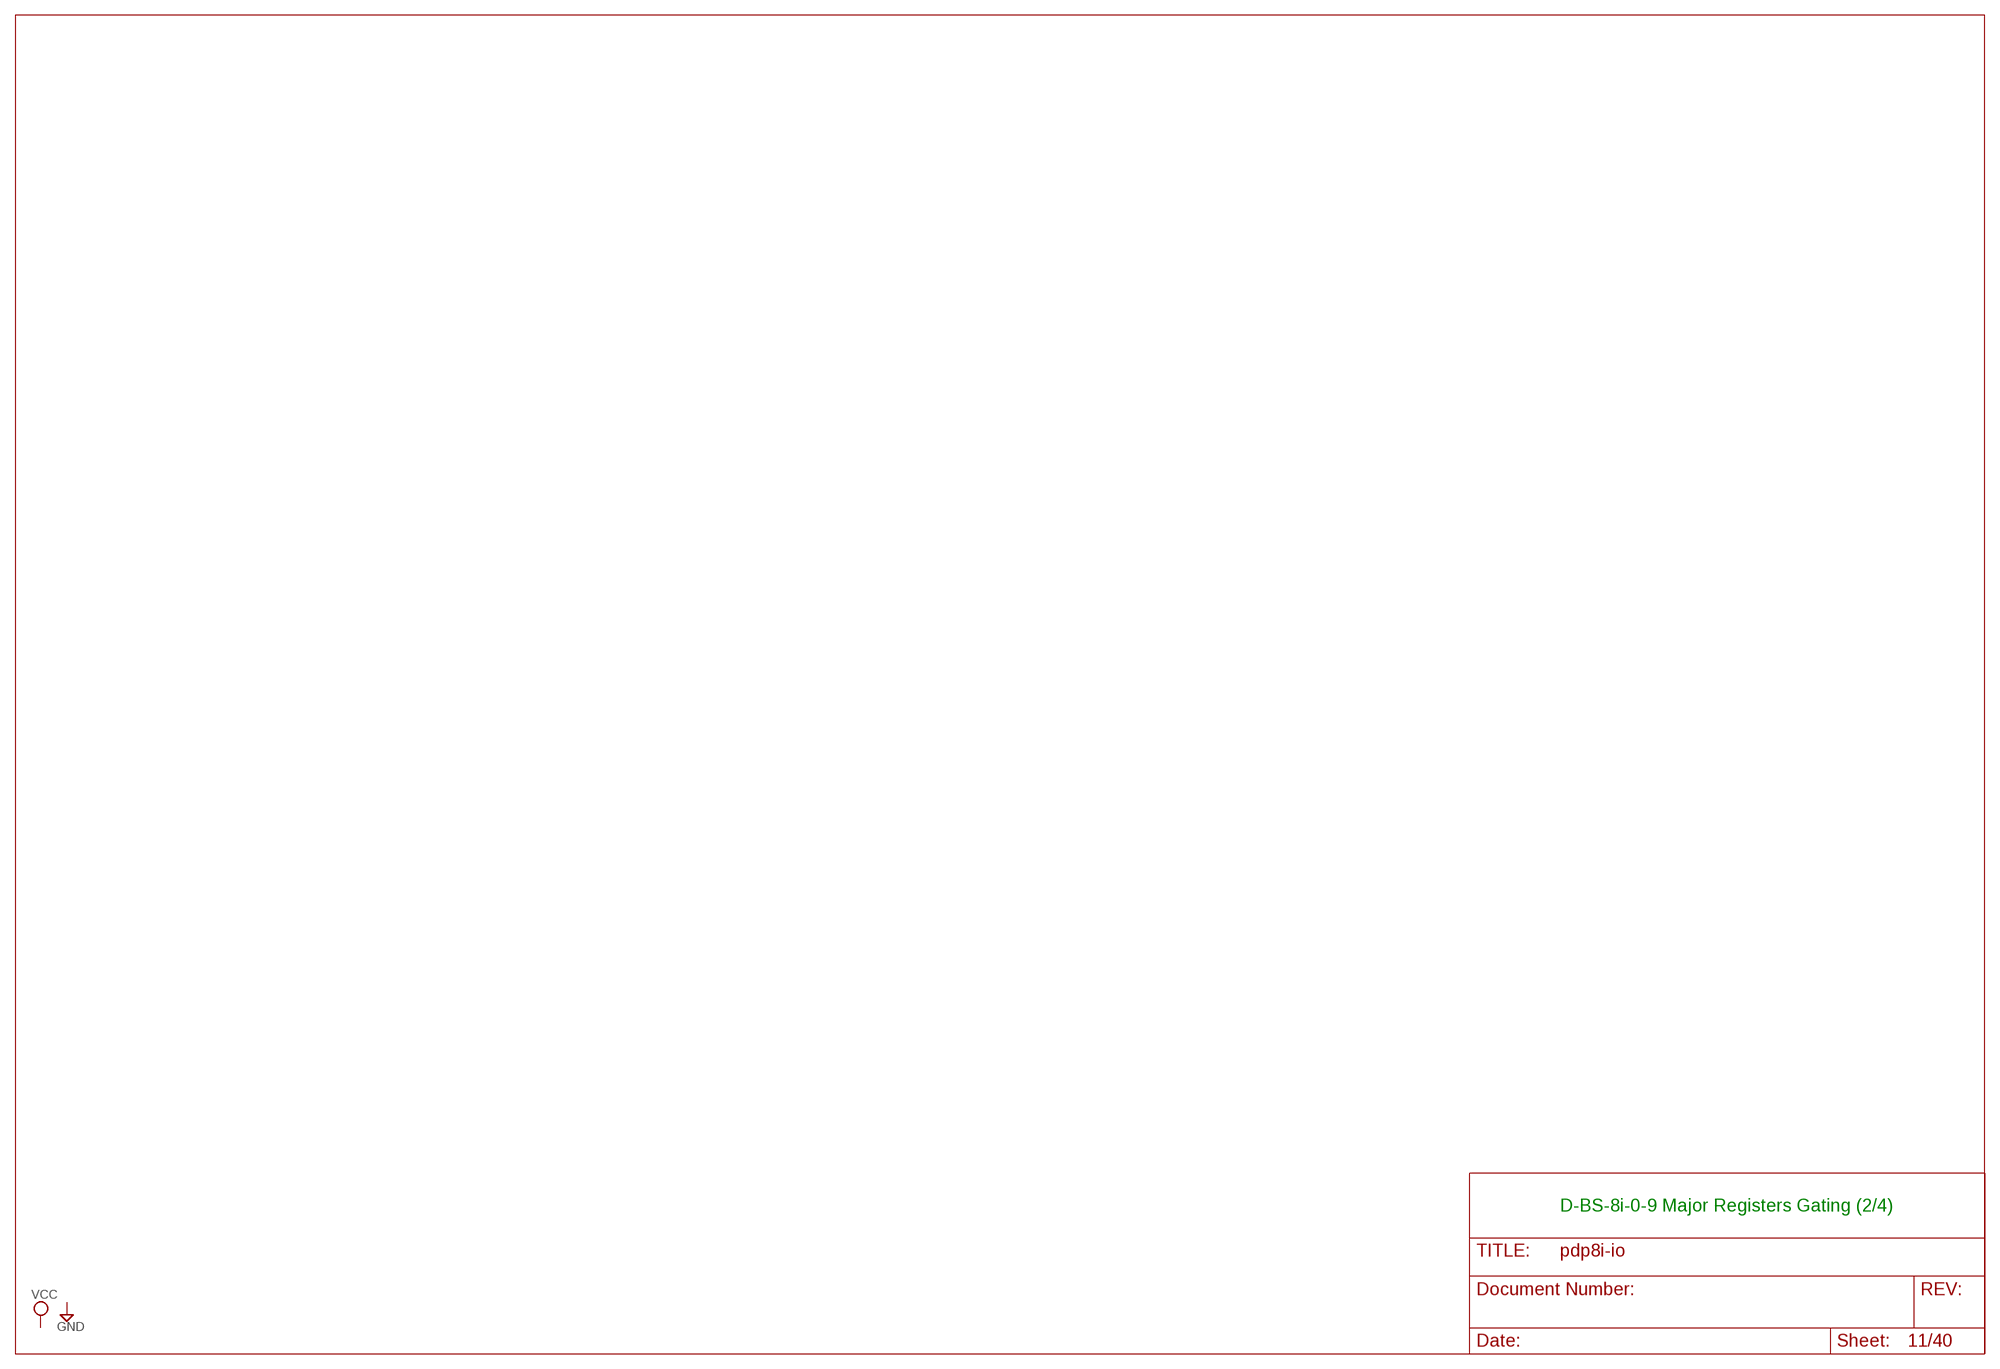
[diagram p10: schematic, sheet 11]

### Notes on the sheet
- D-BS-8i-0-9 Major Registers Gating (2/4)

## Sheet 12 of 40
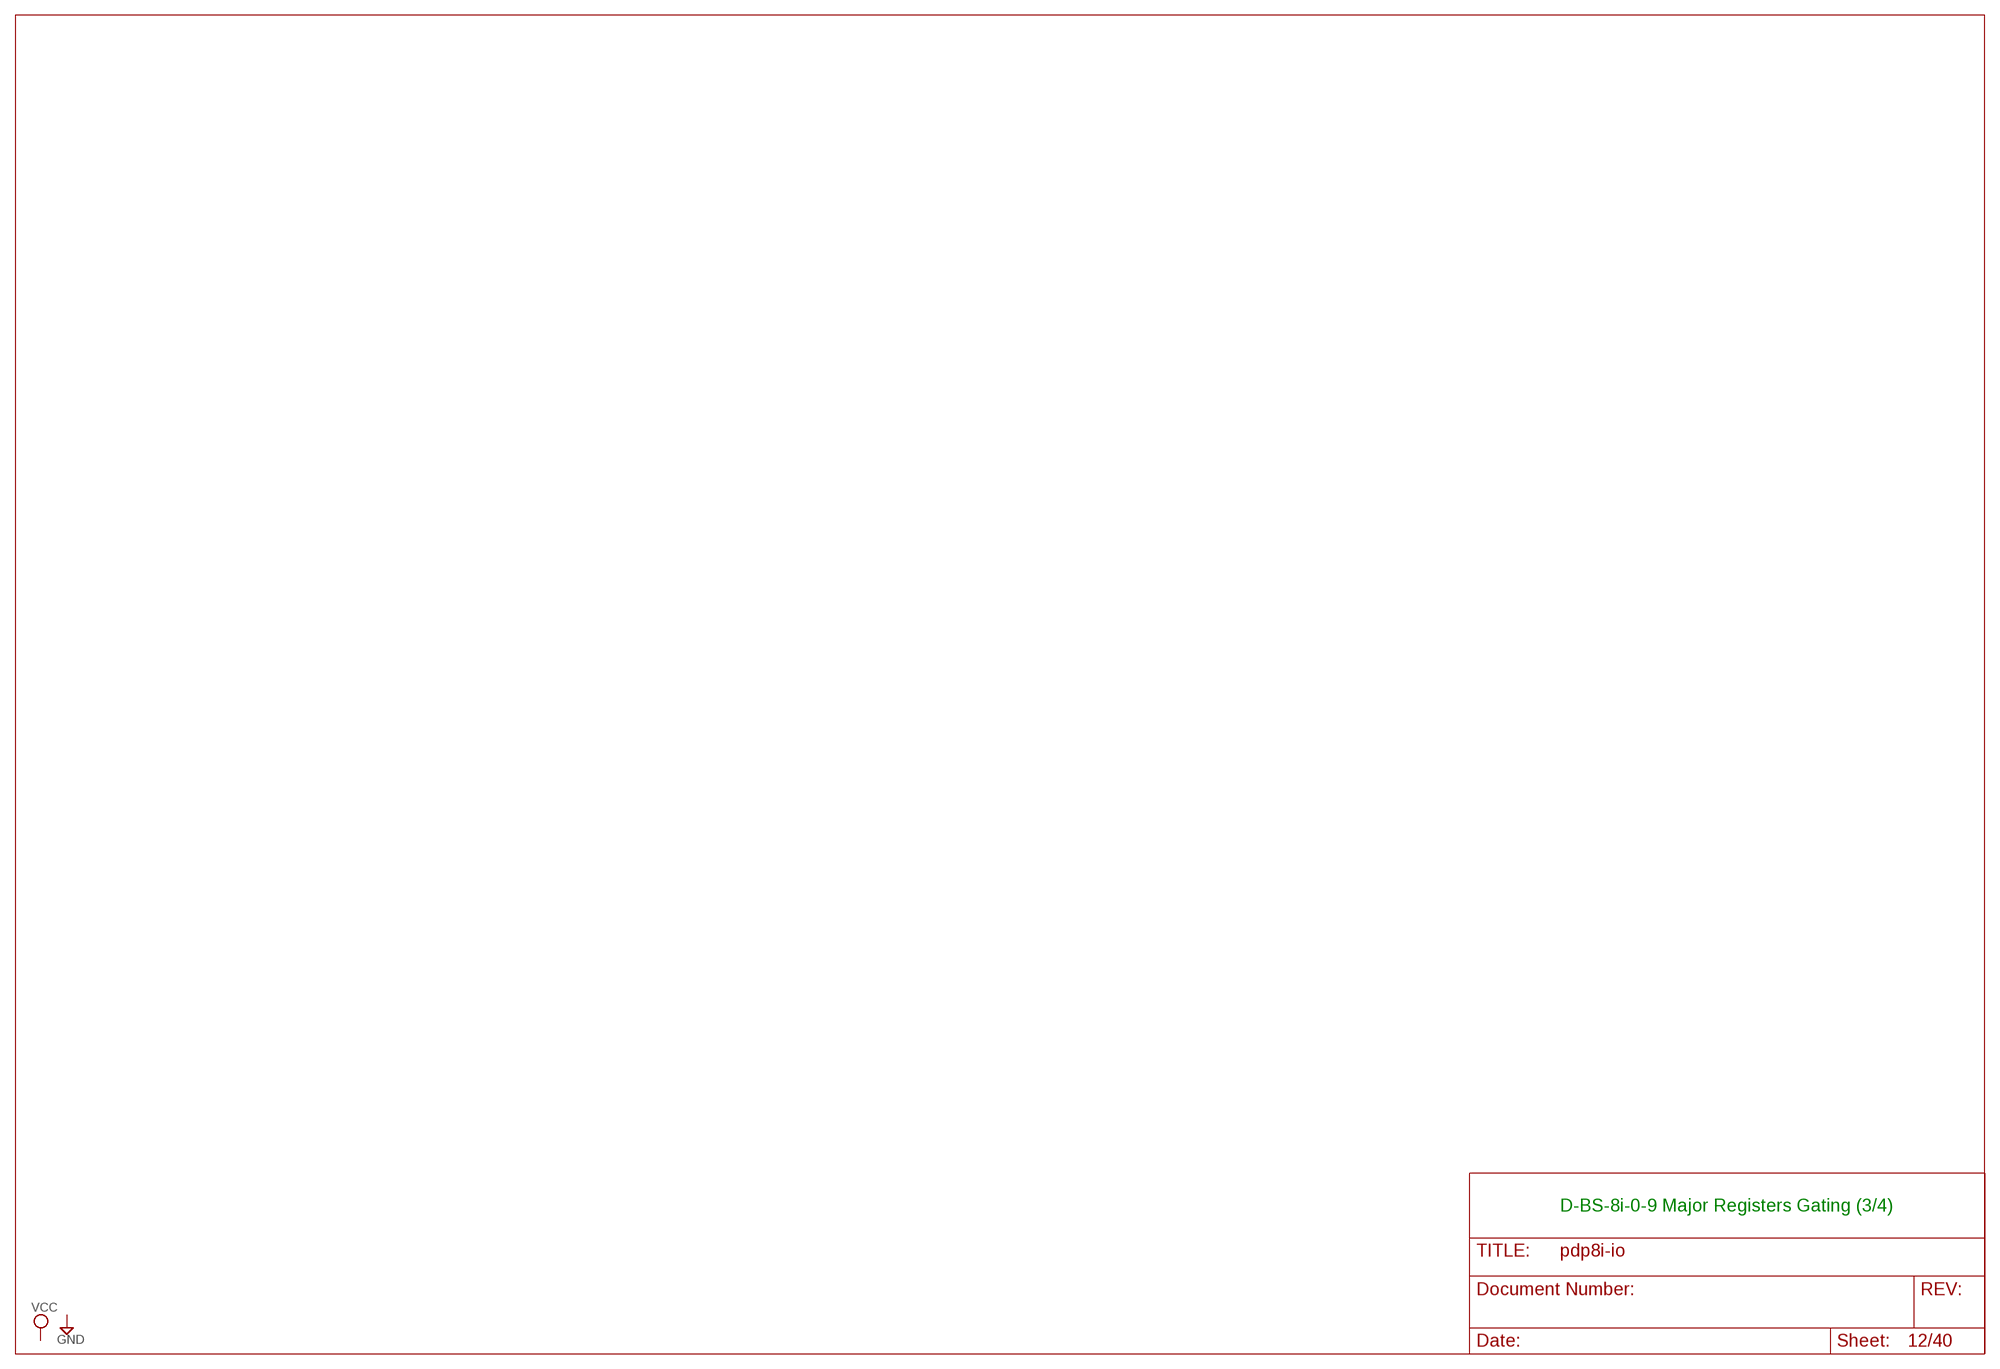
[diagram p11: schematic, sheet 12]

### Notes on the sheet
- D-BS-8i-0-9 Major Registers Gating (3/4)

## Sheet 13 of 40
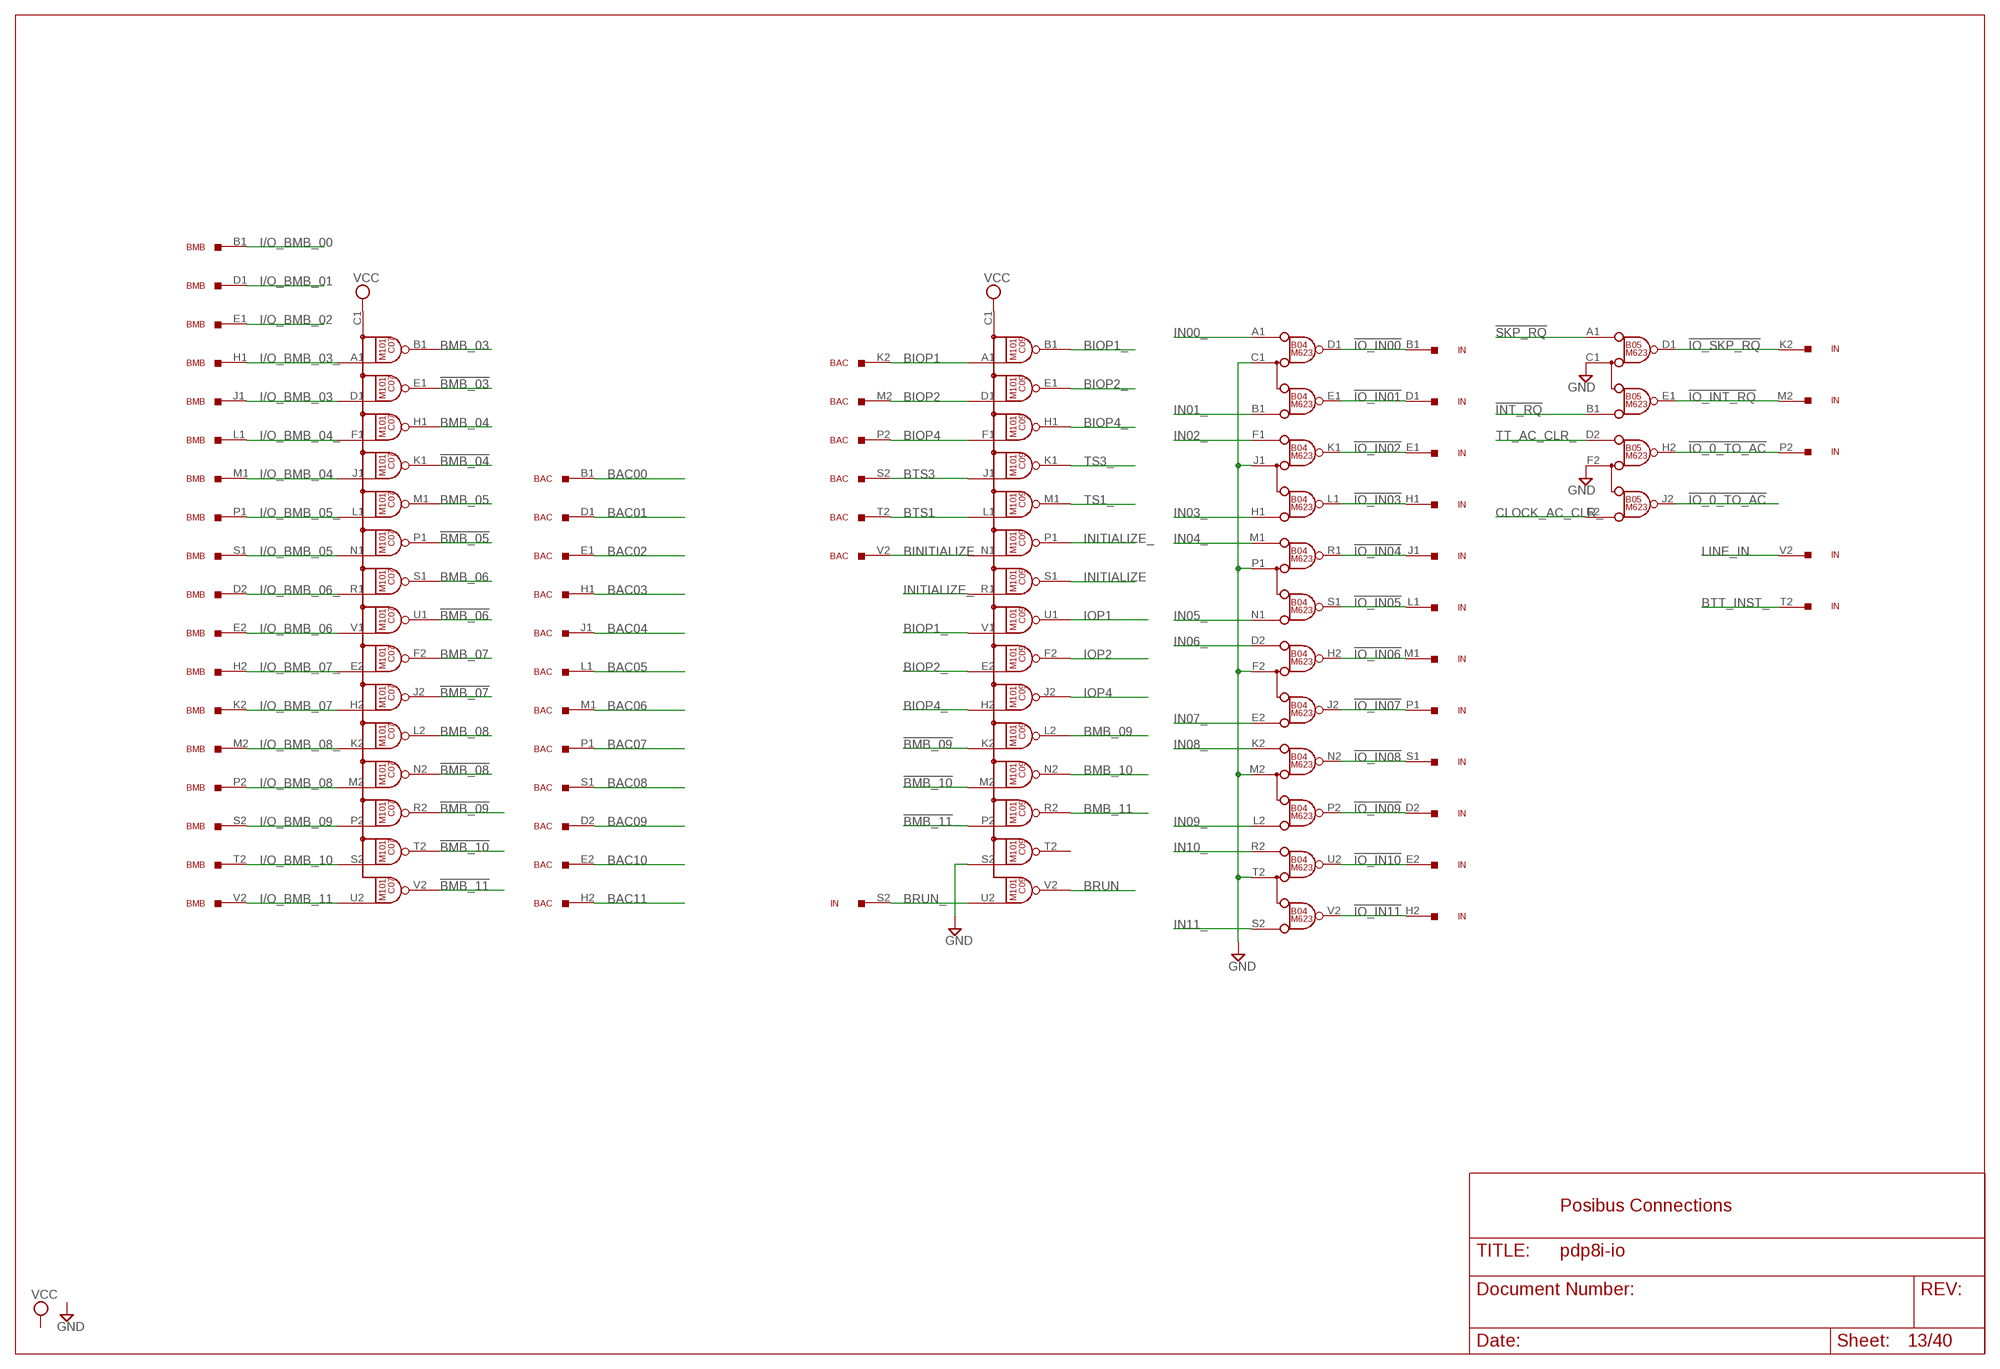
[diagram p12: schematic, sheet 13]

### Parts
B04  M623  [H807]
B05  M623  [H807]
BAC  M903  [H807]
BMB  M903  [H807]
C07  M101  M101-ARRAY  [H807]
C09  M101  M101-ARRAY  [H807]
IN  M903  [H807]

### Nets
!BMB_03: C07.E1(O2) ; also sheet 15,16,33,35,36,37
!BMB_04: C07.K1(O4) ; also sheet 15,16,33,34,35,36,37
!BMB_05: C07.P1(O6) ; also sheet 15,16,33,35,36,38
!BMB_06: C07.U1(O8) ; also sheet 15,34,35,36,37,38
!BMB_07: C07.J2(O10) ; also sheet 16,33,34,36
!BMB_08: C07.N2(O12) ; also sheet 16,33,34,35
!BMB_09: C07.R2(O13) C09.K2(IN11) ; also sheet 33,37
!BMB_10: C07.T2(O14) C09.M2(IN12) ; also sheet 37
!BMB_11: C07.V2(O15) C09.P2(IN13)
!INT_RQ: B05.B1(D1:B) ; also sheet 33,34,35,36,37,38
!IO_0_TO_AC: B05.H2(H2:D) B05.J2(H2:E) IN.P2 ; also sheet 14,16
!IO_IN00: B04.D1(D1:D) IN.B1 ; also sheet 14
!IO_IN01: B04.E1(D1:E) IN.D1 ; also sheet 14
!IO_IN02: B04.K1(K1:D) IN.E1 ; also sheet 14
!IO_IN03: B04.L1(K1:E) IN.H1 ; also sheet 14
!IO_IN04: B04.R1(R1:D) IN.J1 ; also sheet 14,15
!IO_IN05: B04.S1(R1:E) IN.L1 ; also sheet 14,15
!IO_IN06: B04.H2(H2:D) IN.M1 ; also sheet 14,15
!IO_IN07: B04.J2(H2:E) IN.P1 ; also sheet 14,15
!IO_IN08: B04.N2(N2:D) IN.S1 ; also sheet 14,15
!IO_IN09: B04.P2(N2:E) IN.D2 ; also sheet 14,15
!IO_IN10: B04.U2(U2:D) IN.E2 ; also sheet 14,15
!IO_IN11: B04.V2(U2:E) IN.H2 ; also sheet 14,15
!IO_INT_RQ: B05.E1(D1:E) IN.M2 ; also sheet 14,16
!IO_SKP_RQ: B05.D1(D1:D) IN.K2 ; also sheet 14,16
!SKP_RQ: B05.A1(D1:A) ; also sheet 33,34,35,36,37,38
BAC00: BAC.B1 ; also sheet 14,37
BAC01: BAC.D1 ; also sheet 14,37
BAC02: BAC.E1 ; also sheet 14,33,37
BAC03: BAC.H1 ; also sheet 14,33,37
BAC04: BAC.J1 ; also sheet 14,16,33,35,37
BAC05: BAC.L1 ; also sheet 14,16,33,35,37
BAC06: BAC.M1 ; also sheet 14,16,33,35,37
BAC07: BAC.P1 ; also sheet 14,16,33,35,37
BAC08: BAC.S1 ; also sheet 14,16,33,35,37
BAC09: BAC.D2 ; also sheet 14,16,33,35,37
BAC10: BAC.E2 ; also sheet 14,16,33,35,37
BAC11: BAC.H2 ; also sheet 14,16,33,35,37
BINITIALIZE: BAC.V2 C09.N1(IN6)
BIOP1: BAC.K2 C09.A1(IN1) ; also sheet 38
BIOP1_: C09.B1(O1) C09.V1(IN8) ; also sheet 14,34,37
BIOP2: BAC.M2 C09.D1(IN2) ; also sheet 38
BIOP2_: C09.E1(O2) C09.E2(IN9) ; also sheet 14,34,37
BIOP4: BAC.P2 C09.F1(IN3) ; also sheet 38
BIOP4_: C09.H1(O3) C09.H2(IN10) ; also sheet 14,37
BMB_03: C07.B1(O1) ; also sheet 34,38
BMB_04: C07.H1(O3) ; also sheet 38
BMB_05: C07.M1(O5) ; also sheet 34,37
BMB_06: C07.S1(O7) ; also sheet 16,33,38
BMB_07: C07.F2(O9) ; also sheet 15,33,34,35,37,38
BMB_08: C07.L2(O11) ; also sheet 15,33,34,36,37,38
BMB_09: C09.L2(O11) ; also sheet 37
BMB_10: C09.N2(O12) ; also sheet 33,37
BMB_11: C09.R2(O13) ; also sheet 33,37
BRUN: C09.V2(O15)
BRUN_: C09.U2(IN15) IN.S2 ; also sheet 14
BTS1: BAC.T2 C09.L1(IN5) ; also sheet 14
BTS3: BAC.S2 C09.J1(IN4) ; also sheet 14
BTT_INST_: IN.T2 ; also sheet 14
CLOCK_AC_CLR_: B05.E2(H2:B) ; also sheet 37
GND [Suppply]: B04.C1(D1:C) B04.F2(H2:C) B04.J1(K1:C) B04.M2(N2:C) B04.P1(R1:C) B04.T2(U2:C) B05.C1(D1:C) B05.F2(H2:C) C09.S2(IN14) ; also sheet 15,16,33,34,35,39
I/O_BMB_00: BMB.B1 ; also sheet 14
I/O_BMB_01: BMB.D1 ; also sheet 14
I/O_BMB_02: BMB.E1 ; also sheet 14
I/O_BMB_03: BMB.J1 C07.D1(IN2) ; also sheet 14
I/O_BMB_03_: BMB.H1 C07.A1(IN1) ; also sheet 14
I/O_BMB_04: BMB.M1 C07.J1(IN4) ; also sheet 14
I/O_BMB_04_: BMB.L1 C07.F1(IN3) ; also sheet 14
I/O_BMB_05: BMB.S1 C07.N1(IN6) ; also sheet 14
I/O_BMB_05_: BMB.P1 C07.L1(IN5) ; also sheet 14
I/O_BMB_06: BMB.E2 C07.V1(IN8) ; also sheet 14
I/O_BMB_06_: BMB.D2 C07.R1(IN7) ; also sheet 14
I/O_BMB_07: BMB.K2 C07.H2(IN10) ; also sheet 14
I/O_BMB_07_: BMB.H2 C07.E2(IN9) ; also sheet 14
I/O_BMB_08: BMB.P2 C07.M2(IN12) ; also sheet 14
I/O_BMB_08_: BMB.M2 C07.K2(IN11) ; also sheet 14
I/O_BMB_09: BMB.S2 C07.P2(IN13) ; also sheet 14
I/O_BMB_10: BMB.T2 C07.S2(IN14) ; also sheet 14
I/O_BMB_11: BMB.V2 C07.U2(IN15) ; also sheet 14
IN00_: B04.A1(D1:A) ; also sheet 37,39
IN01_: B04.B1(D1:B) ; also sheet 37,39
IN02_: B04.F1(K1:A) ; also sheet 37,39
IN03_: B04.H1(K1:B) ; also sheet 37,39
IN04_: B04.M1(R1:A) ; also sheet 36,37,39
IN05_: B04.N1(R1:B) ; also sheet 36,37,39
IN06_: B04.D2(H2:A) ; also sheet 36,37,39
IN07_: B04.E2(H2:B) ; also sheet 36,37,39
IN08_: B04.K2(N2:A) ; also sheet 36,37,39
IN09_: B04.L2(N2:B) ; also sheet 36,37,39
IN10_: B04.R2(U2:A) ; also sheet 36,37,39
IN11_: B04.S2(U2:B) ; also sheet 36,37,39
INITIALIZE: C09.S1(O7) ; also sheet 15,16,33,34,36
INITIALIZE_: C09.P1(O6) C09.R1(IN7)
IOP1: C09.U1(O8) ; also sheet 15,16,33,34,35,36
IOP2: C09.F2(O9) ; also sheet 15,16,33,34,35,36
IOP4: C09.J2(O10) ; also sheet 15,16,33,34,35,36
LINE_IN: IN.V2 ; also sheet 14
TS1_: C09.M1(O5)
TS3_: C09.K1(O4)
TT_AC_CLR_: B05.D2(H2:A) ; also sheet 15,16
VCC [Suppply]: C07.C1(ENABLE) C09.C1(ENABLE) ; also sheet 33
Unconnected: B05.F1(K1:A) B05.H1(K1:B) B05.J1(K1:C) B05.K1(K1:D) B05.K2(N2:A) B05.L1(K1:E) B05.L2(N2:B) B05.M1(R1:A) B05.M2(N2:C) B05.N1(R1:B) B05.N2(N2:D) B05.P1(R1:C) B05.P2(N2:E) B05.R1(R1:D) B05.R2(U2:A) B05.S1(R1:E) B05.S2(U2:B) B05.T2(U2:C) B05.U2(U2:D) B05.V2(U2:E) BAC.A2 BAC.B2 BAC.U1 BAC.V1 BMB.A2 BMB.B2 BMB.U1 BMB.V1 C09.T2(O14) IN.A2 IN.B2 IN.U1 IN.V1

### Notes on the sheet
- Posibus Connections

## Sheet 14 of 40
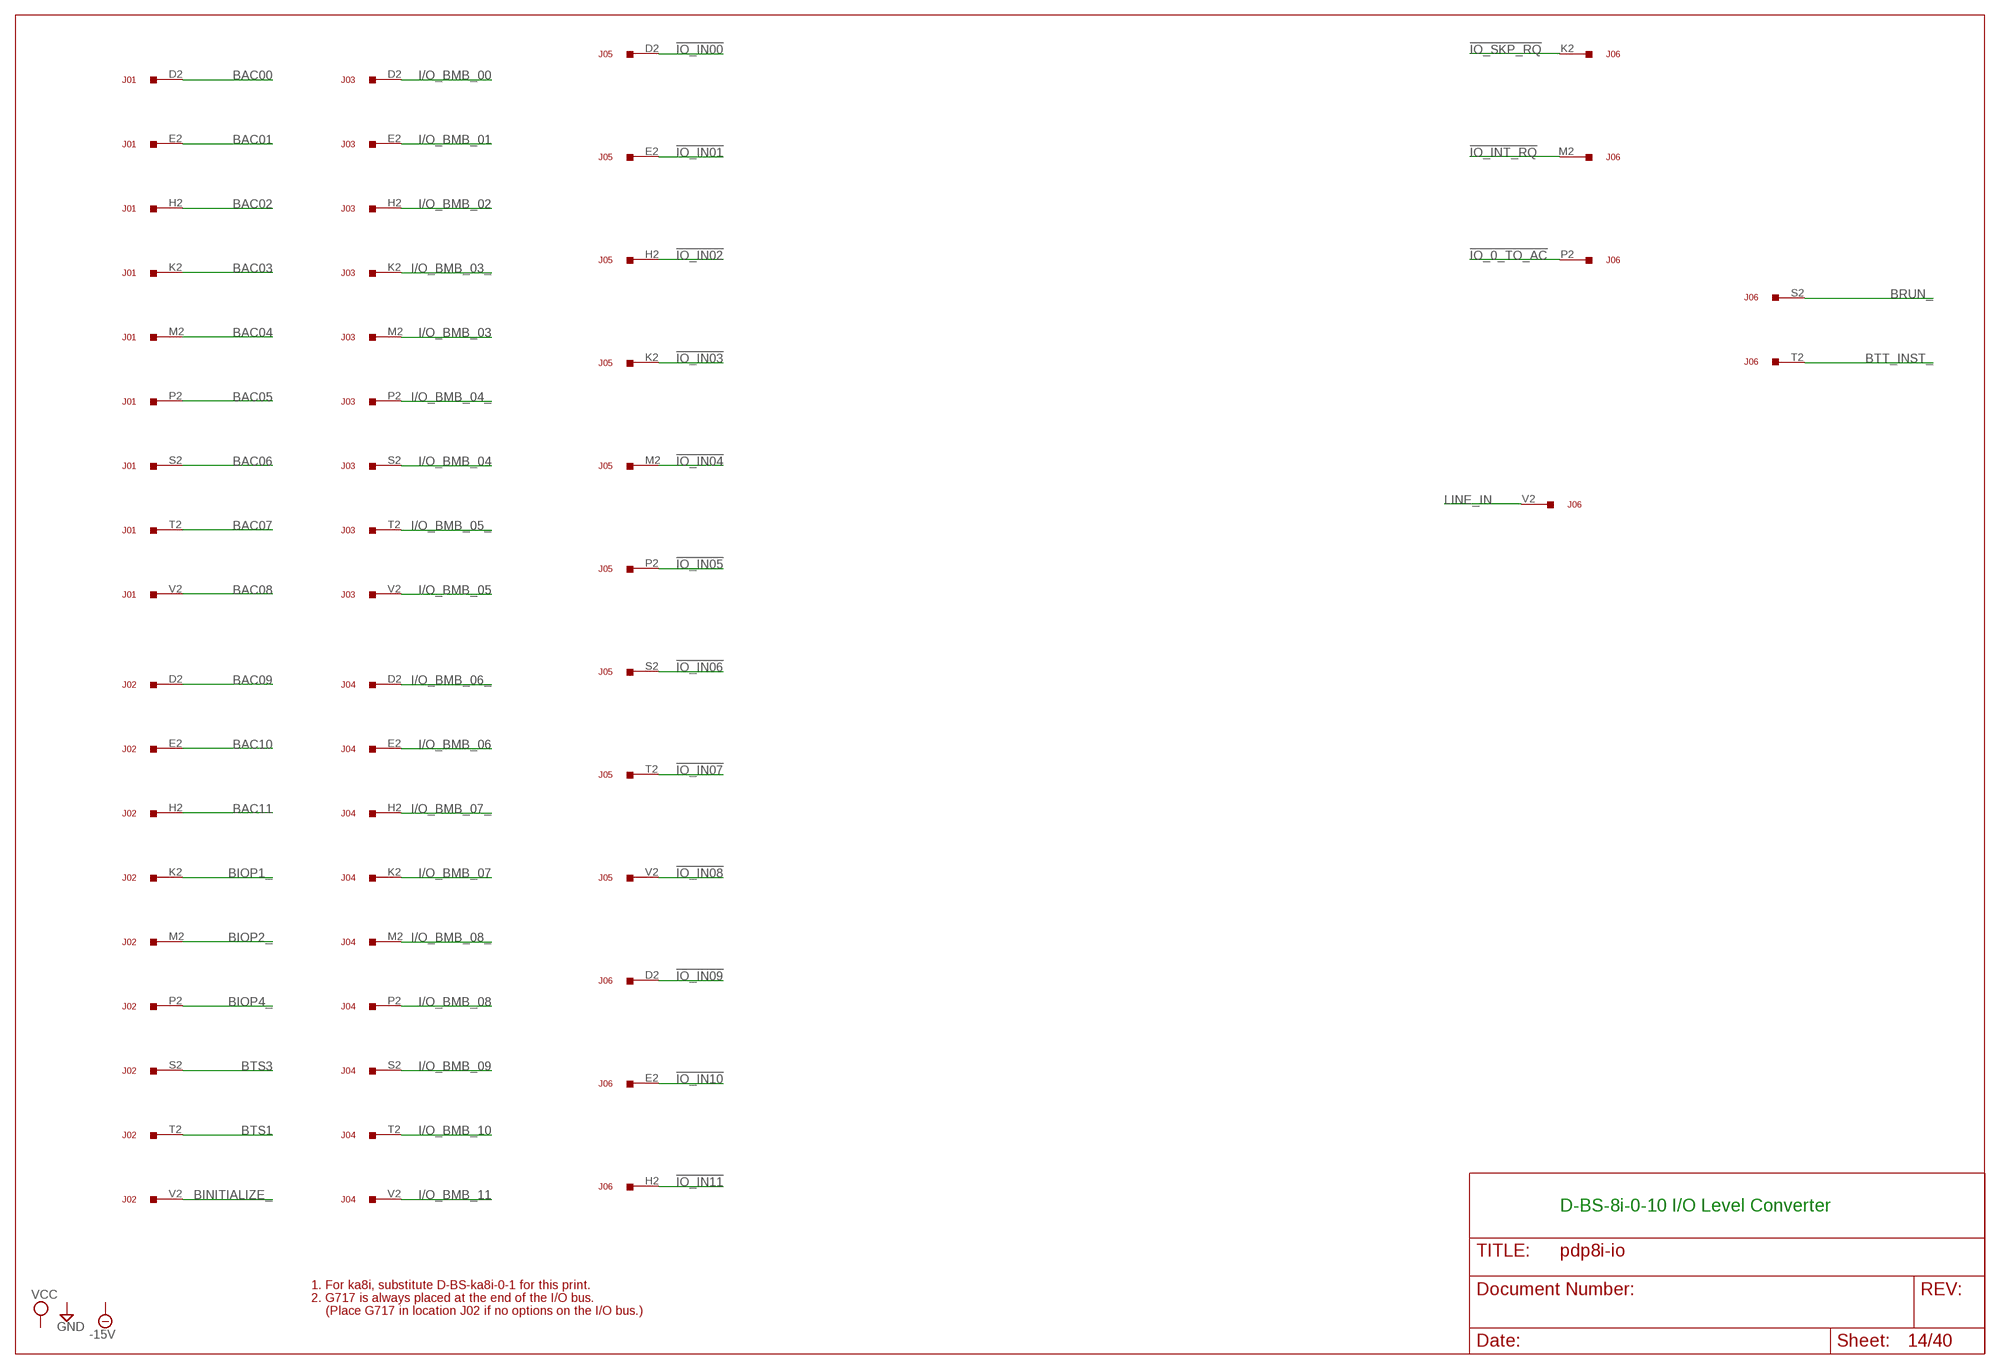
[diagram p13: schematic, sheet 14]

### Parts
J01  W011  [H807]
J02  W011  [H807]
J03  W011  [H807]
J04  W011  [H807]
J05  W011  [H807]
J06  W011  [H807]

### Nets
!IO_0_TO_AC: J06.P2 ; also sheet 13,16
!IO_IN00: J05.D2 ; also sheet 13
!IO_IN01: J05.E2 ; also sheet 13
!IO_IN02: J05.H2 ; also sheet 13
!IO_IN03: J05.K2 ; also sheet 13
!IO_IN04: J05.M2 ; also sheet 13,15
!IO_IN05: J05.P2 ; also sheet 13,15
!IO_IN06: J05.S2 ; also sheet 13,15
!IO_IN07: J05.T2 ; also sheet 13,15
!IO_IN08: J05.V2 ; also sheet 13,15
!IO_IN09: J06.D2 ; also sheet 13,15
!IO_IN10: J06.E2 ; also sheet 13,15
!IO_IN11: J06.H2 ; also sheet 13,15
!IO_INT_RQ: J06.M2 ; also sheet 13,16
!IO_SKP_RQ: J06.K2 ; also sheet 13,16
BAC00: J01.D2 ; also sheet 13,37
BAC01: J01.E2 ; also sheet 13,37
BAC02: J01.H2 ; also sheet 13,33,37
BAC03: J01.K2 ; also sheet 13,33,37
BAC04: J01.M2 ; also sheet 13,16,33,35,37
BAC05: J01.P2 ; also sheet 13,16,33,35,37
BAC06: J01.S2 ; also sheet 13,16,33,35,37
BAC07: J01.T2 ; also sheet 13,16,33,35,37
BAC08: J01.V2 ; also sheet 13,16,33,35,37
BAC09: J02.D2 ; also sheet 13,16,33,35,37
BAC10: J02.E2 ; also sheet 13,16,33,35,37
BAC11: J02.H2 ; also sheet 13,16,33,35,37
BINITIALIZE_: J02.V2 ; also sheet 35,36,37,38,39
BIOP1_: J02.K2 ; also sheet 13,34,37
BIOP2_: J02.M2 ; also sheet 13,34,37
BIOP4_: J02.P2 ; also sheet 13,37
BRUN_: J06.S2 ; also sheet 13
BTS1: J02.T2 ; also sheet 13
BTS3: J02.S2 ; also sheet 13
BTT_INST_: J06.T2 ; also sheet 13
I/O_BMB_00: J03.D2 ; also sheet 13
I/O_BMB_01: J03.E2 ; also sheet 13
I/O_BMB_02: J03.H2 ; also sheet 13
I/O_BMB_03: J03.M2 ; also sheet 13
I/O_BMB_03_: J03.K2 ; also sheet 13
I/O_BMB_04: J03.S2 ; also sheet 13
I/O_BMB_04_: J03.P2 ; also sheet 13
I/O_BMB_05: J03.V2 ; also sheet 13
I/O_BMB_05_: J03.T2 ; also sheet 13
I/O_BMB_06: J04.E2 ; also sheet 13
I/O_BMB_06_: J04.D2 ; also sheet 13
I/O_BMB_07: J04.K2 ; also sheet 13
I/O_BMB_07_: J04.H2 ; also sheet 13
I/O_BMB_08: J04.P2 ; also sheet 13
I/O_BMB_08_: J04.M2 ; also sheet 13
I/O_BMB_09: J04.S2 ; also sheet 13
I/O_BMB_10: J04.T2 ; also sheet 13
I/O_BMB_11: J04.V2 ; also sheet 13
LINE_IN: J06.V2 ; also sheet 13

### Notes on the sheet
- D-BS-8i-0-10 I/O Level Converter
- 1. For ka8i, substitute D-BS-ka8i-0-1 for this print.
- 2. G717 is always placed at the end of the I/O bus.
- (Place G717 in location J02 if no options on the I/O bus.)

## Sheet 15 of 40
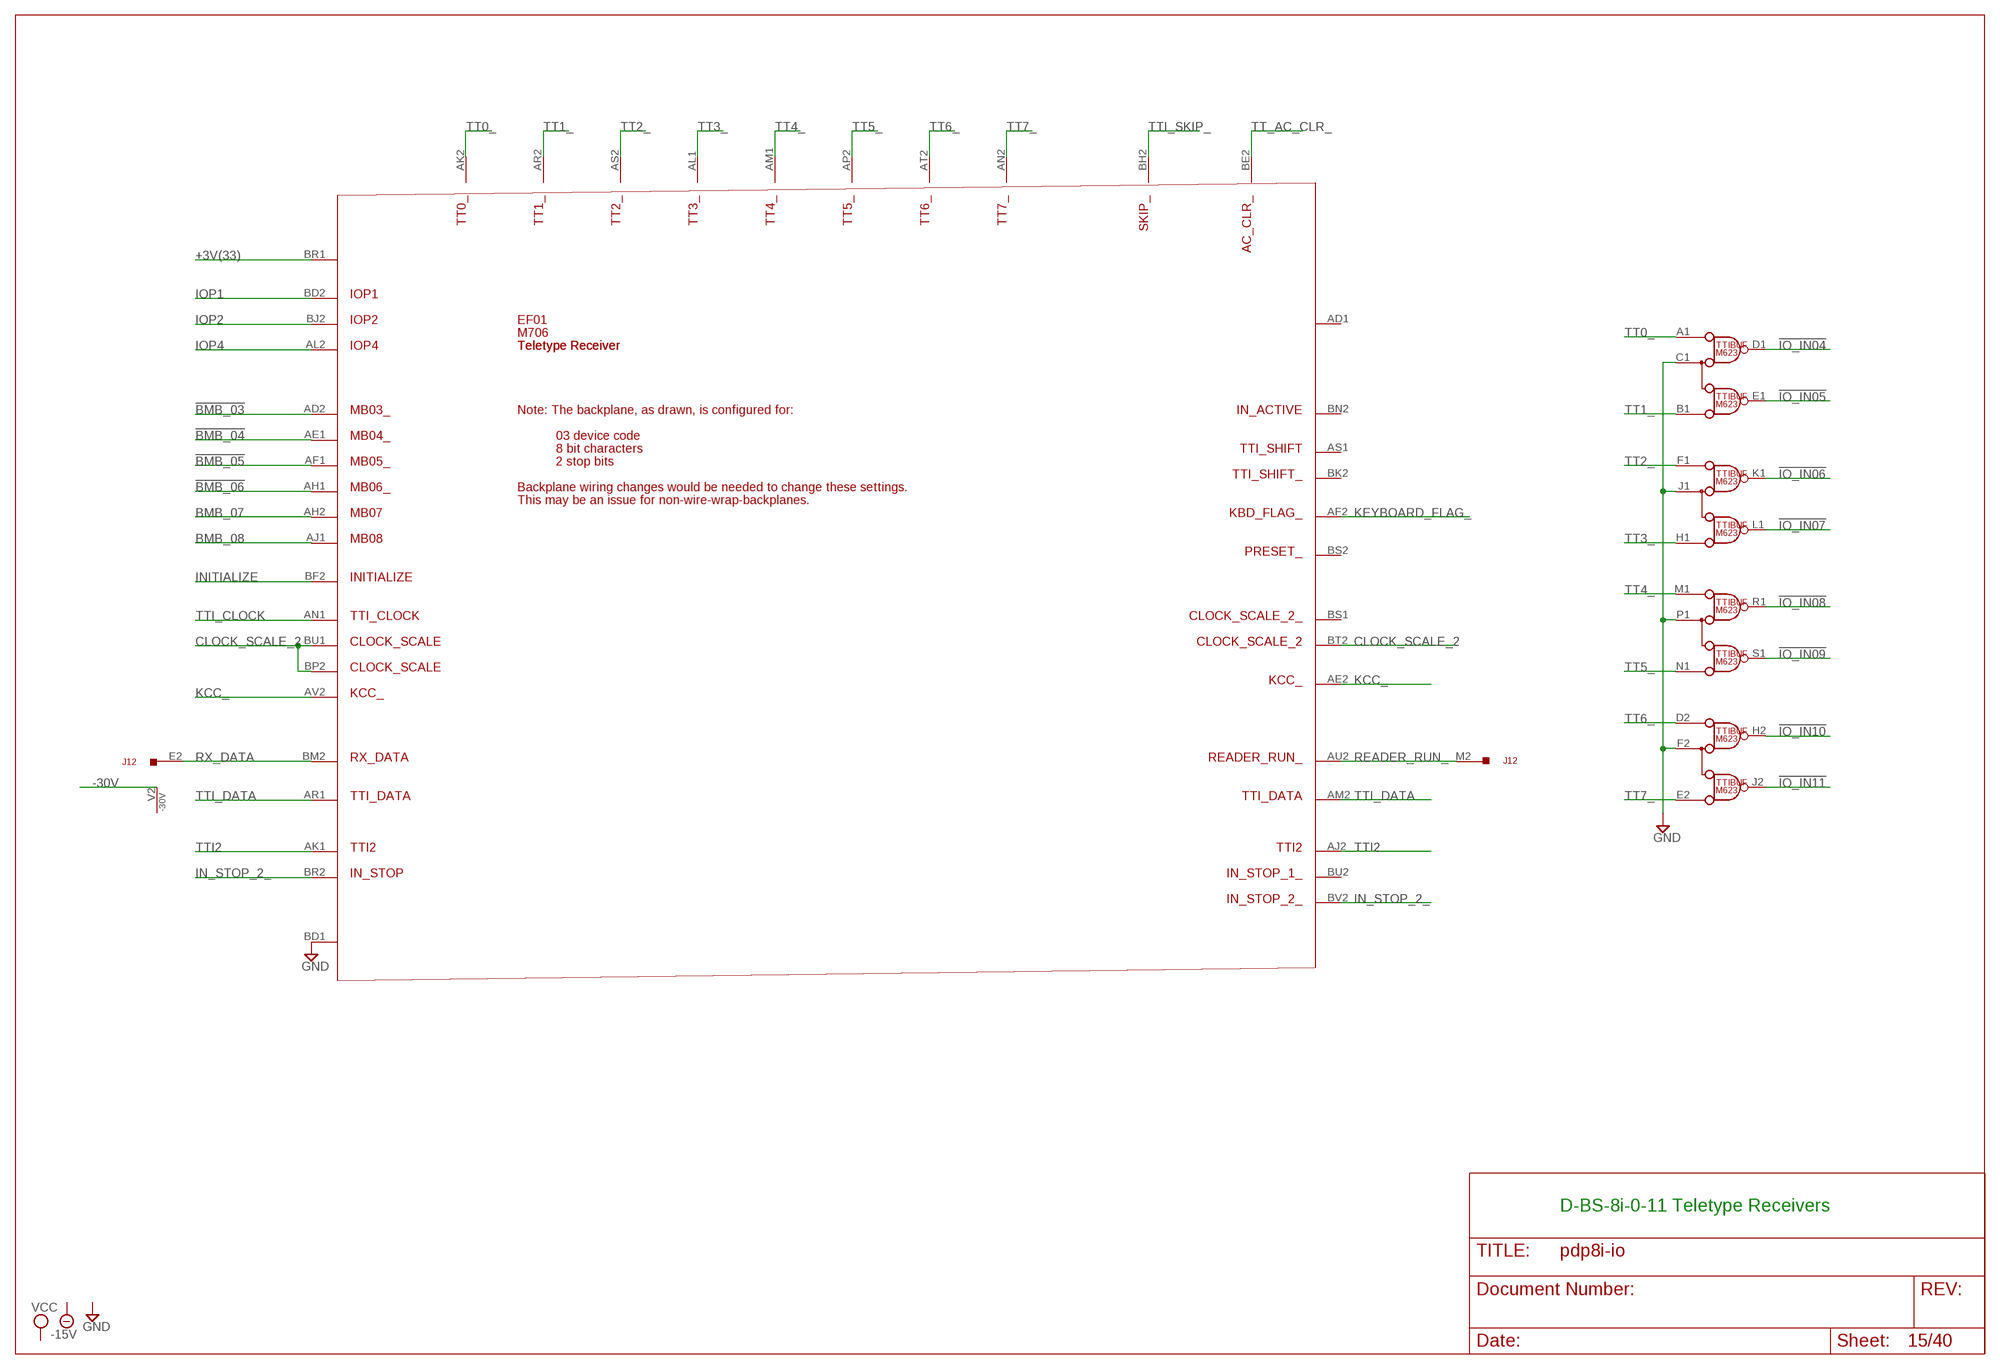
[diagram p14: schematic, sheet 15]

### Parts
EF01  M706  [H807-2]
J12  W076  [H807]
TTIBUF  M623  [H807]

### Nets
!BMB_03: EF01.AD2 ; also sheet 13,16,33,35,36,37
!BMB_04: EF01.AE1 ; also sheet 13,16,33,34,35,36,37
!BMB_05: EF01.AF1 ; also sheet 13,16,33,35,36,38
!BMB_06: EF01.AH1 ; also sheet 13,34,35,36,37,38
!IO_IN04: TTIBUF.D1(D1:D) ; also sheet 13,14
!IO_IN05: TTIBUF.E1(D1:E) ; also sheet 13,14
!IO_IN06: TTIBUF.K1(K1:D) ; also sheet 13,14
!IO_IN07: TTIBUF.L1(K1:E) ; also sheet 13,14
!IO_IN08: TTIBUF.R1(R1:D) ; also sheet 13,14
!IO_IN09: TTIBUF.S1(R1:E) ; also sheet 13,14
!IO_IN10: TTIBUF.H2(H2:D) ; also sheet 13,14
!IO_IN11: TTIBUF.J2(H2:E) ; also sheet 13,14
+3V(33): EF01.BR1 ; also sheet 16
-30V [Suppply]: J12.V2(-30V) ; also sheet 33
BMB_07: EF01.AH2 ; also sheet 13,33,34,35,37,38
BMB_08: EF01.AJ1 ; also sheet 13,33,34,36,37,38
CLOCK_SCALE_2: EF01.BP2 EF01.BT2 EF01.BU1
GND [Suppply]: EF01.BD1 TTIBUF.C1(D1:C) TTIBUF.F2(H2:C) TTIBUF.J1(K1:C) TTIBUF.P1(R1:C) ; also sheet 13,16,33,34,35,39
IN_STOP_2_: EF01.BR2 EF01.BV2
INITIALIZE: EF01.BF2 ; also sheet 13,16,33,34,36
IOP1: EF01.BD2 ; also sheet 13,16,33,34,35,36
IOP2: EF01.BJ2 ; also sheet 13,16,33,34,35,36
IOP4: EF01.AL2 ; also sheet 13,16,33,34,35,36
KCC_: EF01.AE2 EF01.AV2
KEYBOARD_FLAG_: EF01.AF2 ; also sheet 16
READER_RUN_: EF01.AU2 J12.M2
RX_DATA: EF01.BM2 J12.E2
TT0_: EF01.AK2 TTIBUF.A1(D1:A)
TT1_: EF01.AR2 TTIBUF.B1(D1:B)
TT2_: EF01.AS2 TTIBUF.F1(K1:A)
TT3_: EF01.AL1 TTIBUF.H1(K1:B)
TT4_: EF01.AM1 TTIBUF.M1(R1:A)
TT5_: EF01.AP2 TTIBUF.N1(R1:B)
TT6_: EF01.AT2 TTIBUF.D2(H2:A)
TT7_: EF01.AN2 TTIBUF.E2(H2:B)
TT_AC_CLR_: EF01.BE2 ; also sheet 13,16
TTI2: EF01.AJ2 EF01.AK1
TTI_CLOCK: EF01.AN1 ; also sheet 16
TTI_DATA: EF01.AM2 EF01.AR1
TTI_SKIP_: EF01.BH2 ; also sheet 16
Unconnected: EF01.AD1 EF01.AS1 EF01.BK2 EF01.BN2 EF01.BS1 EF01.BS2 EF01.BU2 J12.K2 J12.U2

### Notes on the sheet
- Teletype Receiver
- Note: The backplane, as drawn, is configured for:
- 03 device code
- 8 bit characters
- 2 stop bits
- Backplane wiring changes would be needed to change these settings.
- This may be an issue for non-wire-wrap-backplanes.
- D-BS-8i-0-11 Teletype Receivers

## Sheet 16 of 40
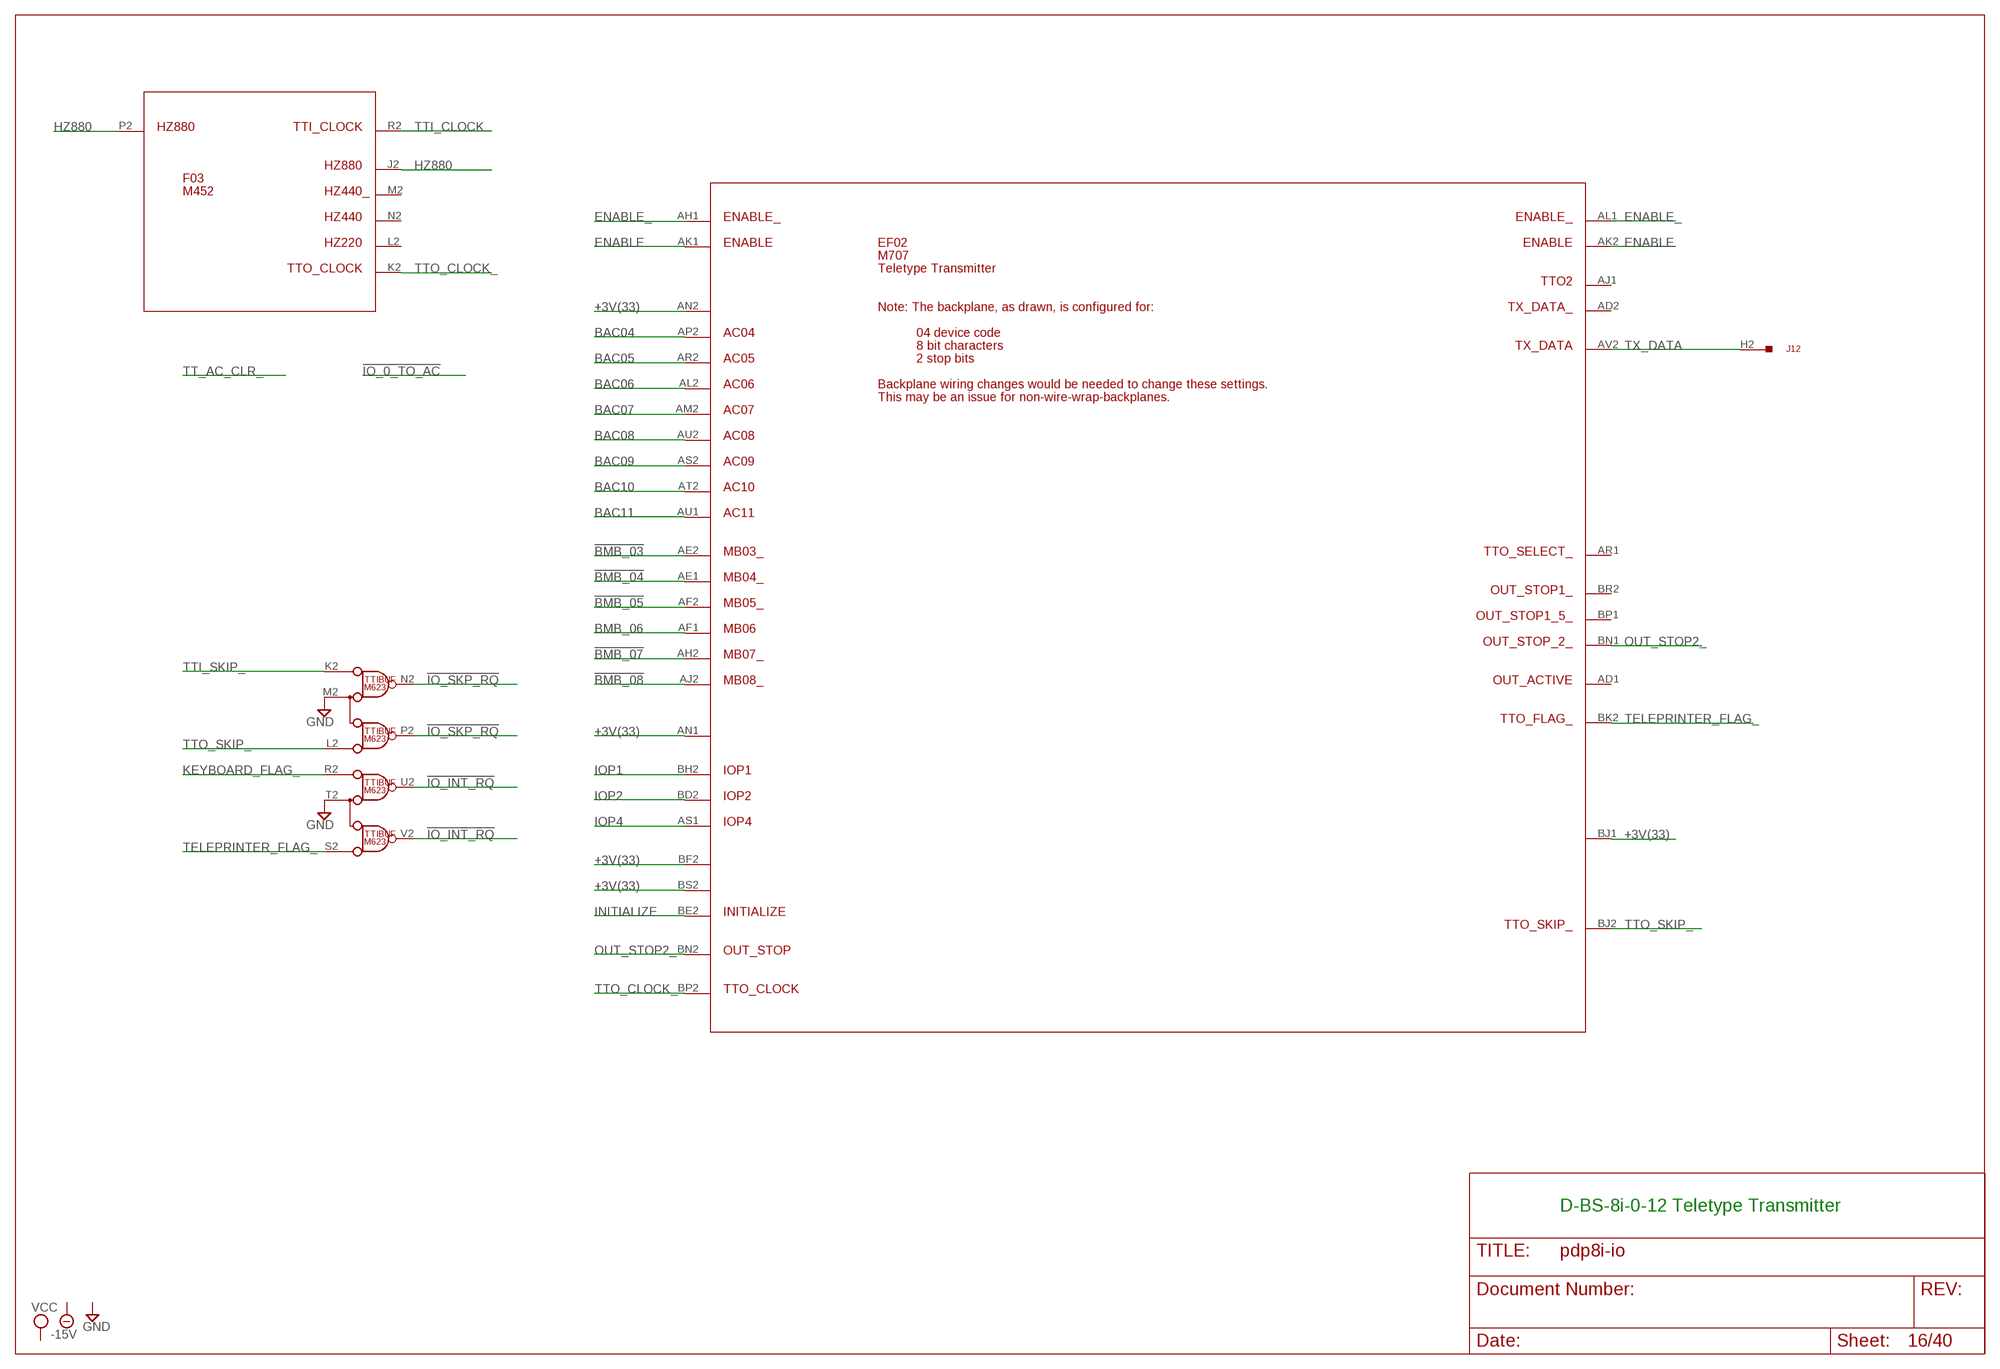
[diagram p15: schematic, sheet 16]

### Parts
EF02  M707  [H807-2]
F03  M452  [H807]

### Nets
!BMB_03: EF02.AE2 ; also sheet 13,15,33,35,36,37
!BMB_04: EF02.AE1 ; also sheet 13,15,33,34,35,36,37
!BMB_05: EF02.AF2 ; also sheet 13,15,33,35,36,38
!BMB_07: EF02.AH2 ; also sheet 13,33,34,36
!BMB_08: EF02.AJ2 ; also sheet 13,33,34,35
!IO_INT_RQ: TTIBUF.U2(U2:D) TTIBUF.V2(U2:E) ; also sheet 13,14
!IO_SKP_RQ: TTIBUF.N2(N2:D) TTIBUF.P2(N2:E) ; also sheet 13,14
+3V(33): EF02.AN1 EF02.AN2 EF02.BF2 EF02.BJ1 EF02.BS2 ; also sheet 15
BAC04: EF02.AP2 ; also sheet 13,14,33,35,37
BAC05: EF02.AR2 ; also sheet 13,14,33,35,37
BAC06: EF02.AL2 ; also sheet 13,14,33,35,37
BAC07: EF02.AM2 ; also sheet 13,14,33,35,37
BAC08: EF02.AU2 ; also sheet 13,14,33,35,37
BAC09: EF02.AS2 ; also sheet 13,14,33,35,37
BAC10: EF02.AT2 ; also sheet 13,14,33,35,37
BAC11: EF02.AU1 ; also sheet 13,14,33,35,37
BMB_06: EF02.AF1 ; also sheet 13,33,38
ENABLE: EF02.AK1 EF02.AK2
ENABLE_: EF02.AH1 EF02.AL1
GND [Suppply]: TTIBUF.M2(N2:C) TTIBUF.T2(U2:C) ; also sheet 13,15,33,34,35,39
HZ880: F03.J2 F03.P2
INITIALIZE: EF02.BE2 ; also sheet 13,15,33,34,36
IOP1: EF02.BH2 ; also sheet 13,15,33,34,35,36
IOP2: EF02.BD2 ; also sheet 13,15,33,34,35,36
IOP4: EF02.AS1 ; also sheet 13,15,33,34,35,36
KEYBOARD_FLAG_: TTIBUF.R2(U2:A) ; also sheet 15
OUT_STOP2_: EF02.BN1 EF02.BN2
TELEPRINTER_FLAG_: EF02.BK2 TTIBUF.S2(U2:B)
TTI_CLOCK: F03.R2 ; also sheet 15
TTI_SKIP_: TTIBUF.K2(N2:A) ; also sheet 15
TTO_CLOCK_: EF02.BP2 F03.K2
TTO_SKIP_: EF02.BJ2 TTIBUF.L2(N2:B)
TX_DATA: EF02.AV2 J12.H2
Unconnected: EF02.AD1 EF02.AD2 EF02.AJ1 EF02.AR1 EF02.BP1 EF02.BR2 F03.L2 F03.M2 F03.N2

### Notes on the sheet
- Note: The backplane, as drawn, is configured for:
- 04 device code
- 8 bit characters
- 2 stop bits
- Backplane wiring changes would be needed to change these settings.
- This may be an issue for non-wire-wrap-backplanes.
- D-BS-8i-0-12 Teletype Transmitter

## Sheet 17 of 40
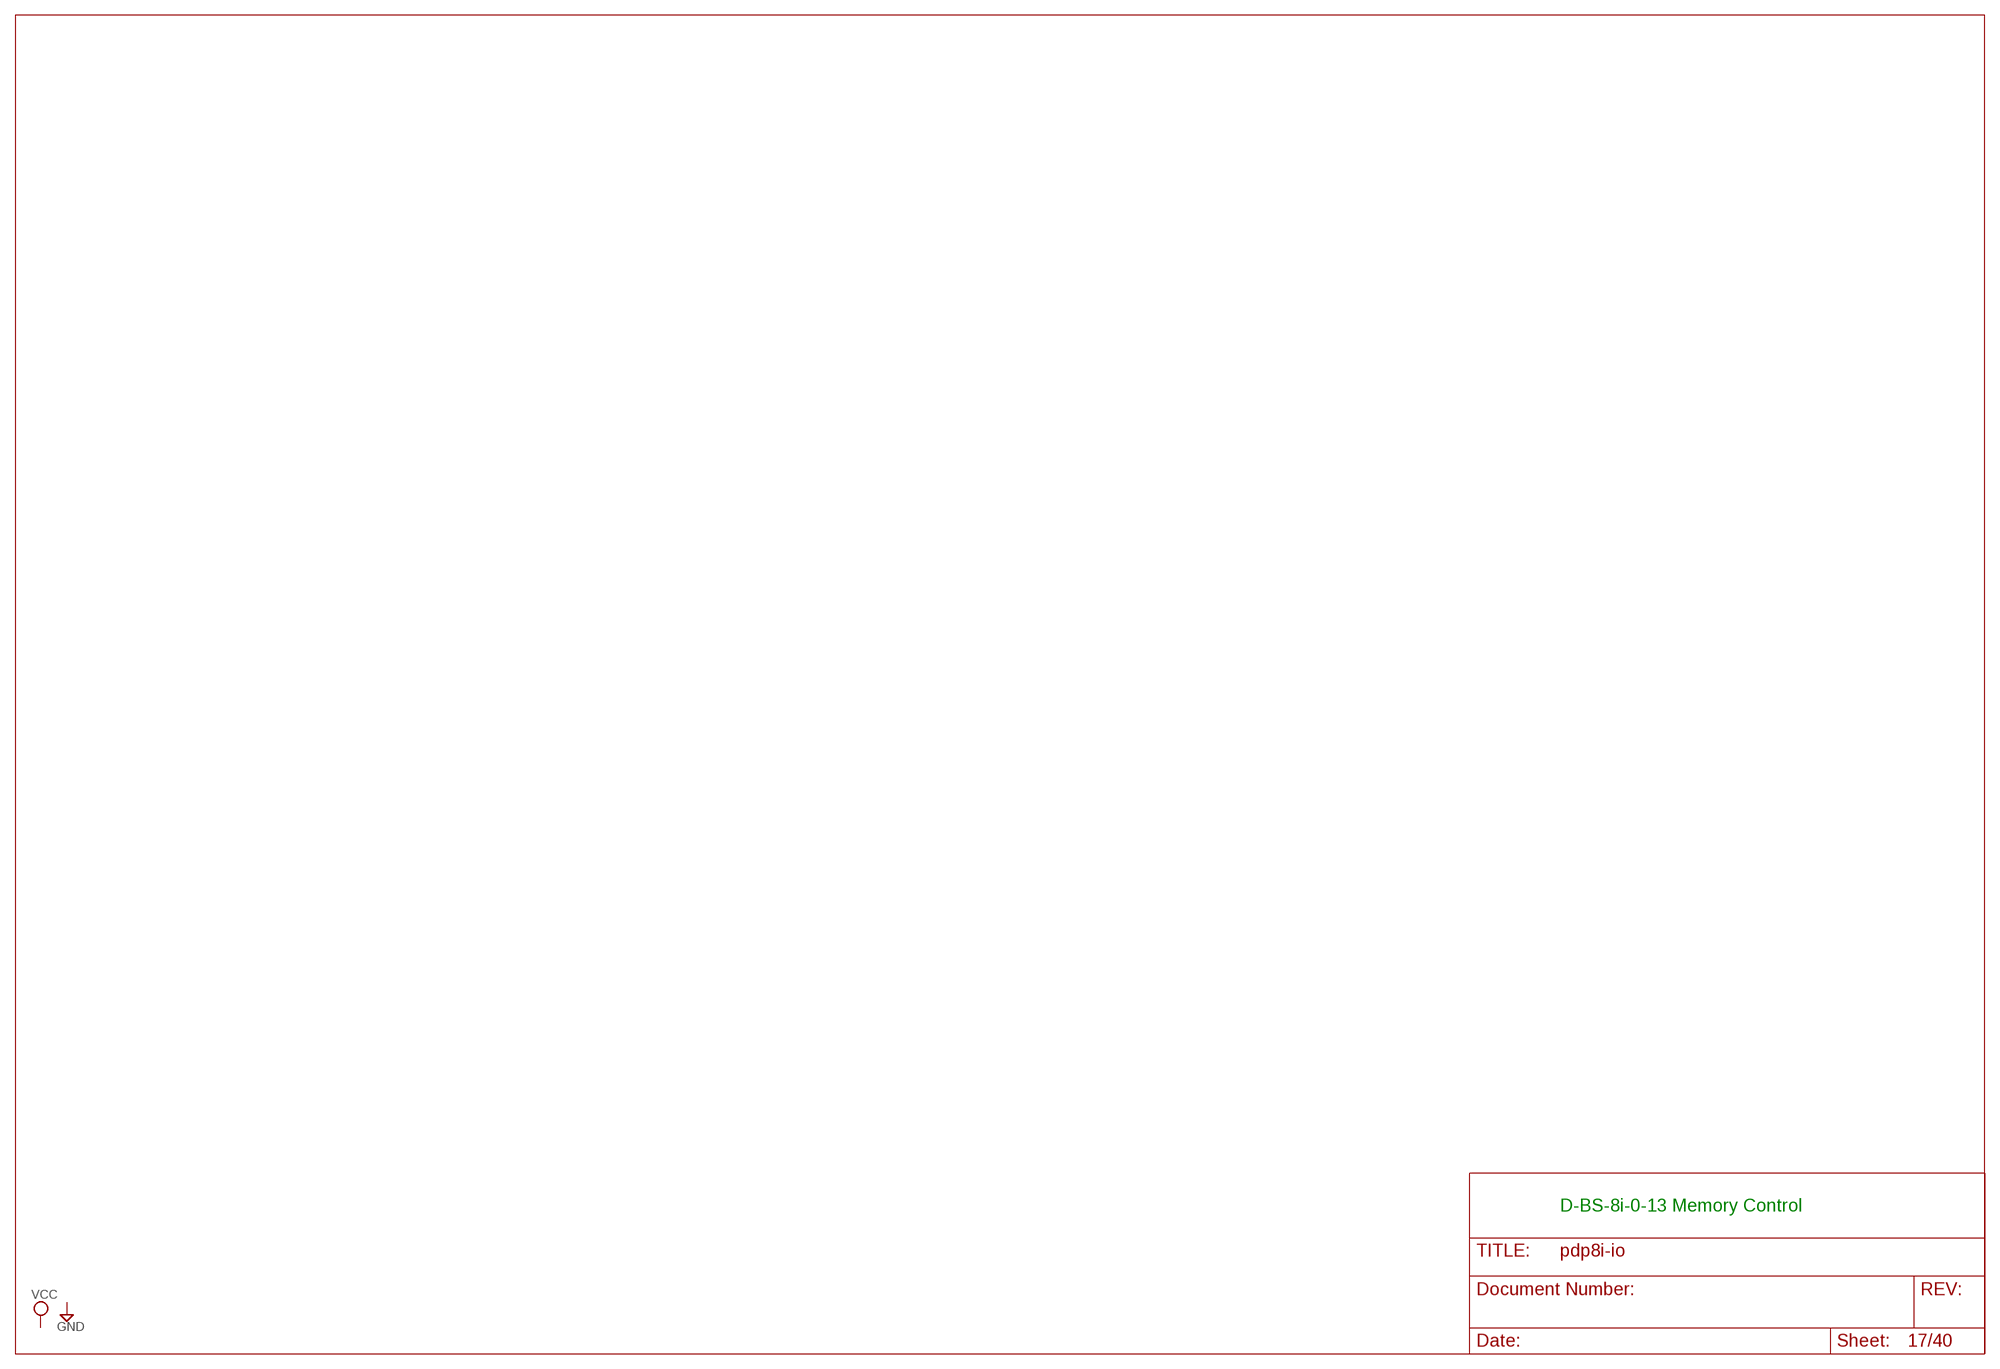
[diagram p16: schematic, sheet 17]

### Notes on the sheet
- D-BS-8i-0-13 Memory Control

## Sheet 18 of 40
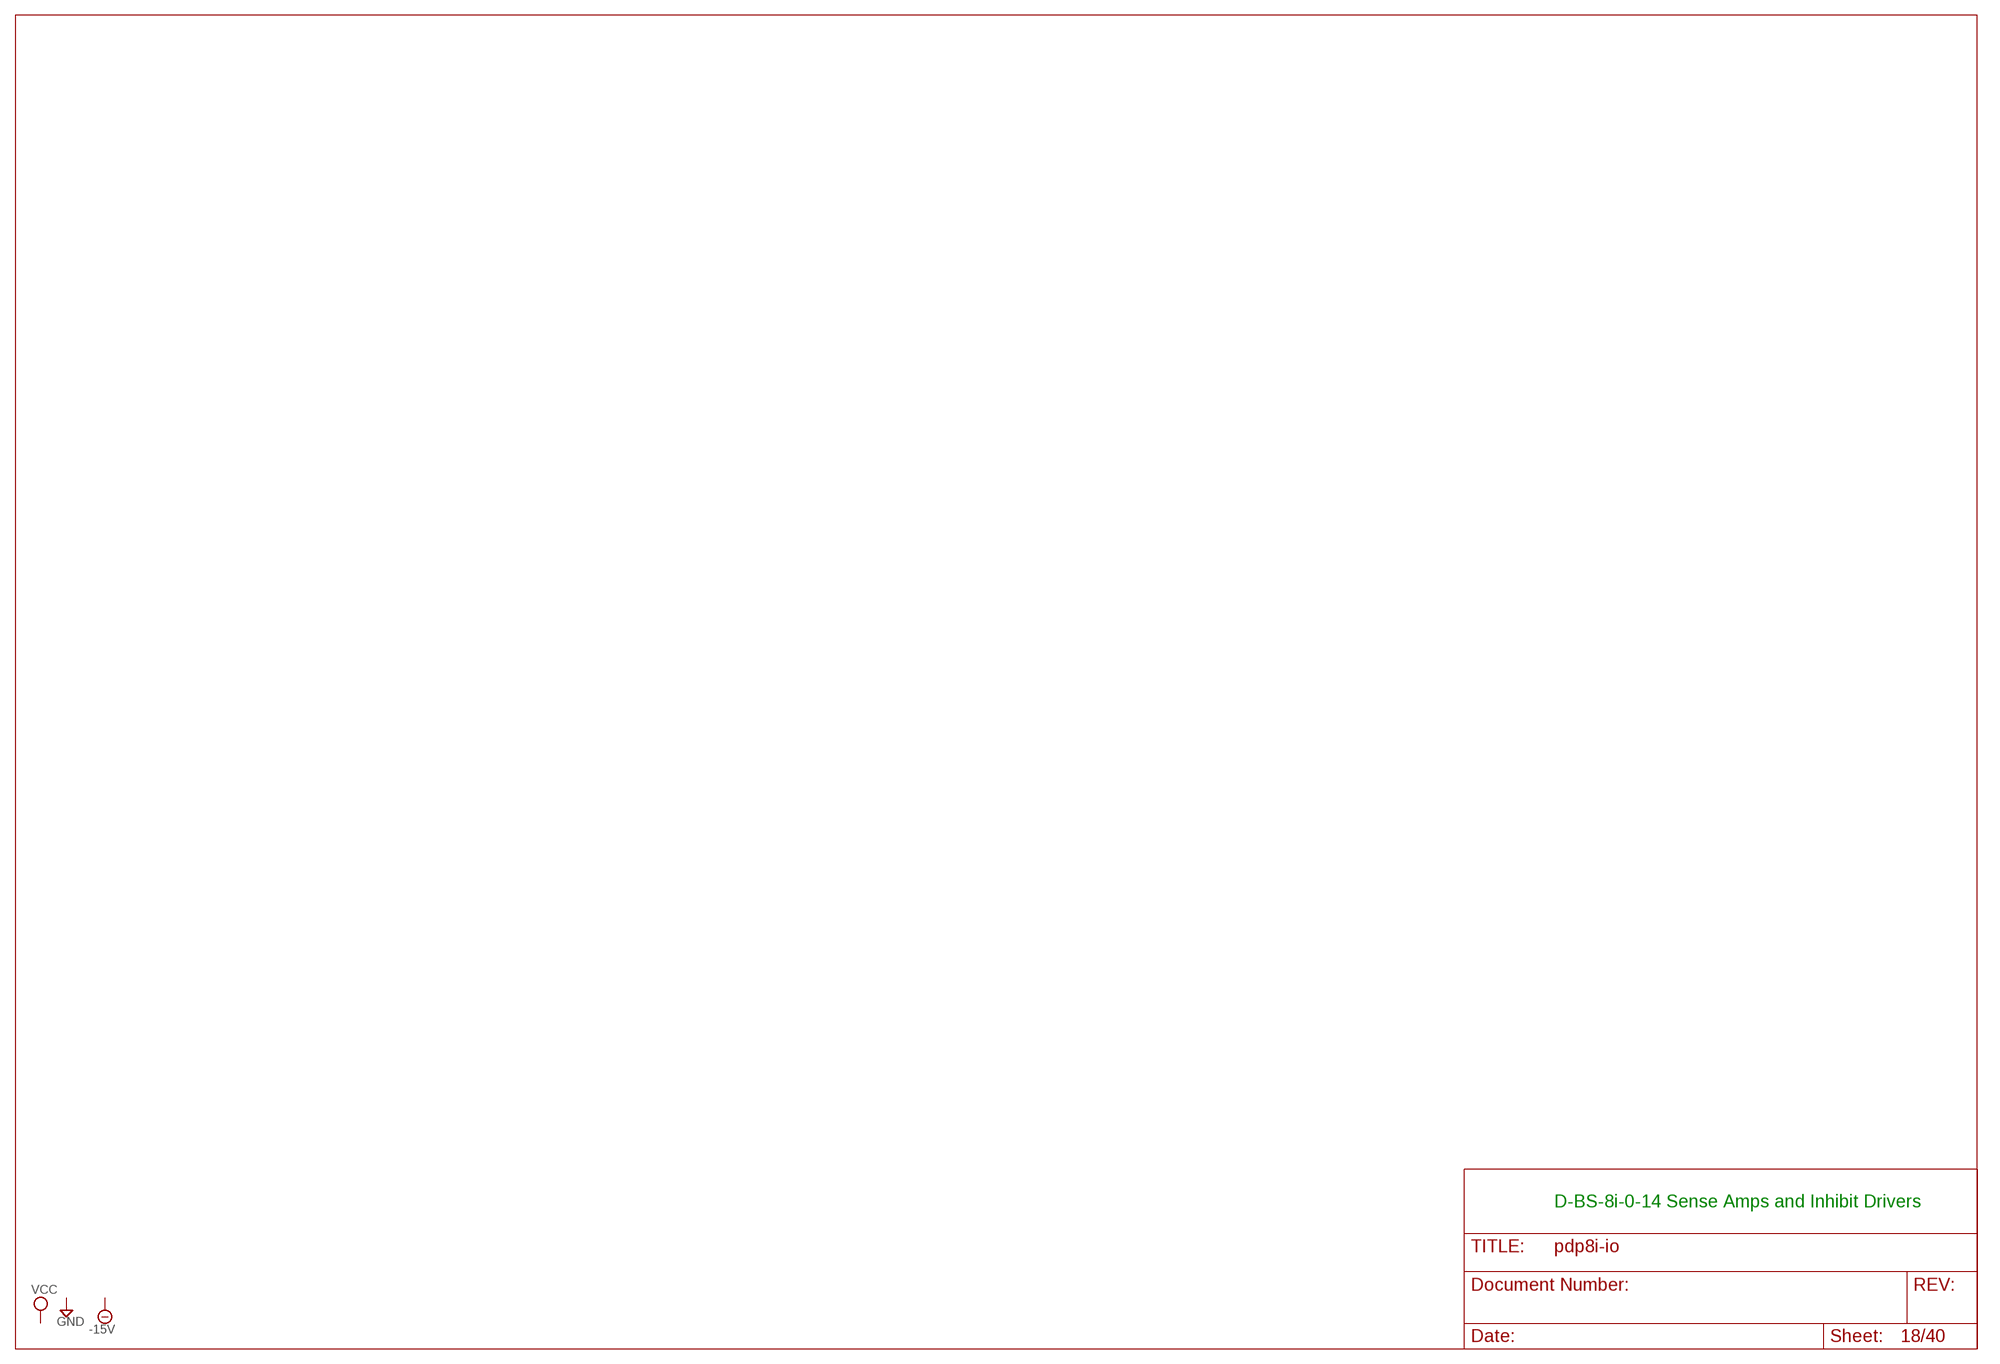
[diagram p17: schematic, sheet 18]

### Notes on the sheet
- D-BS-8i-0-14 Sense Amps and Inhibit Drivers

## Sheet 19 of 40
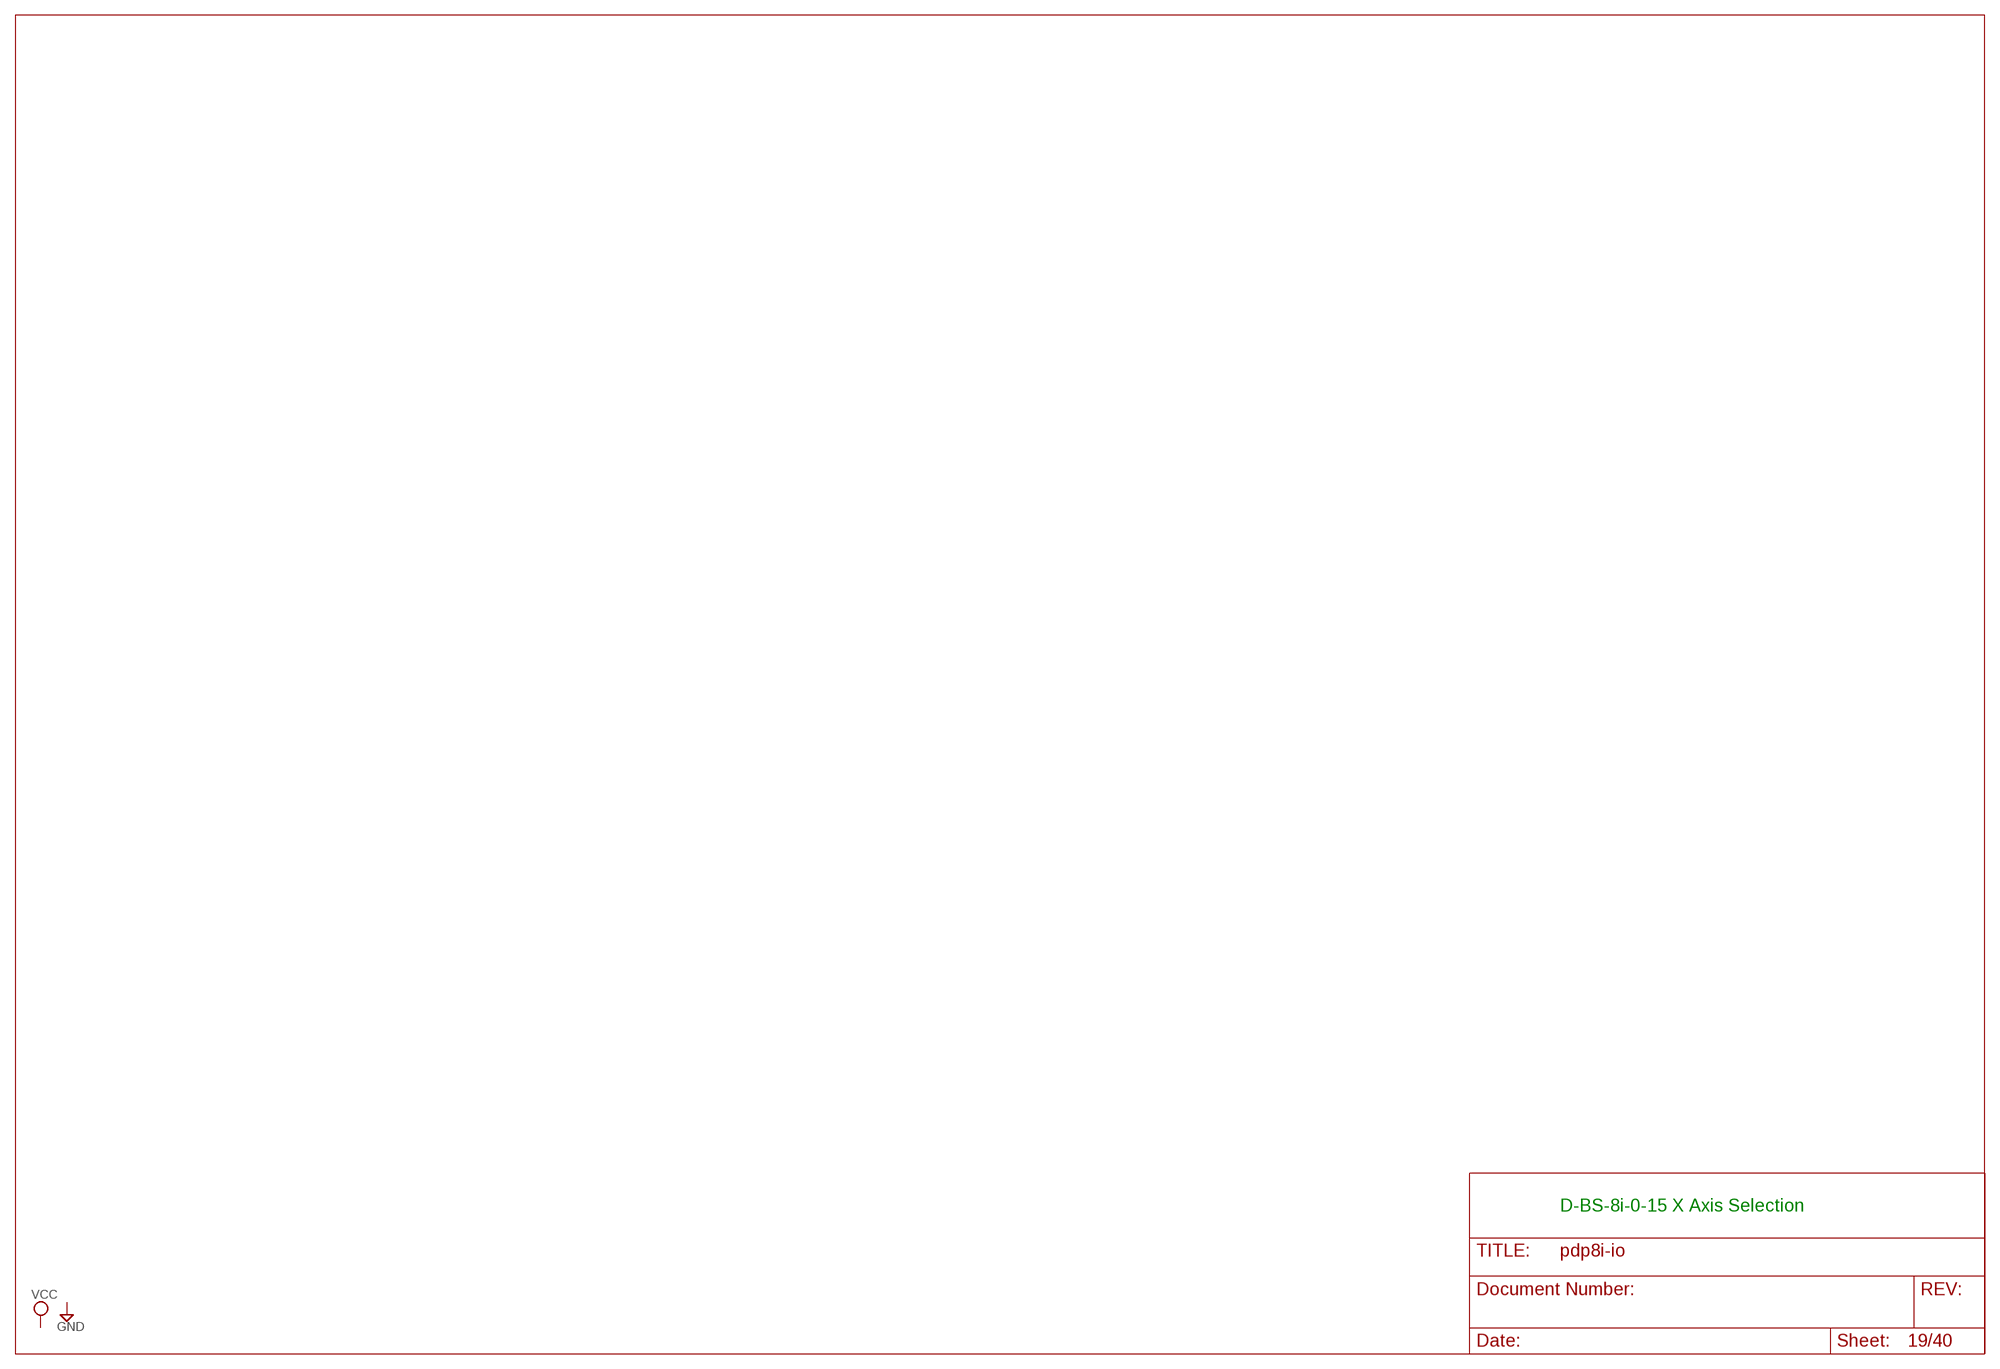
[diagram p18: schematic, sheet 19]

### Notes on the sheet
- D-BS-8i-0-15 X Axis Selection

## Sheet 20 of 40
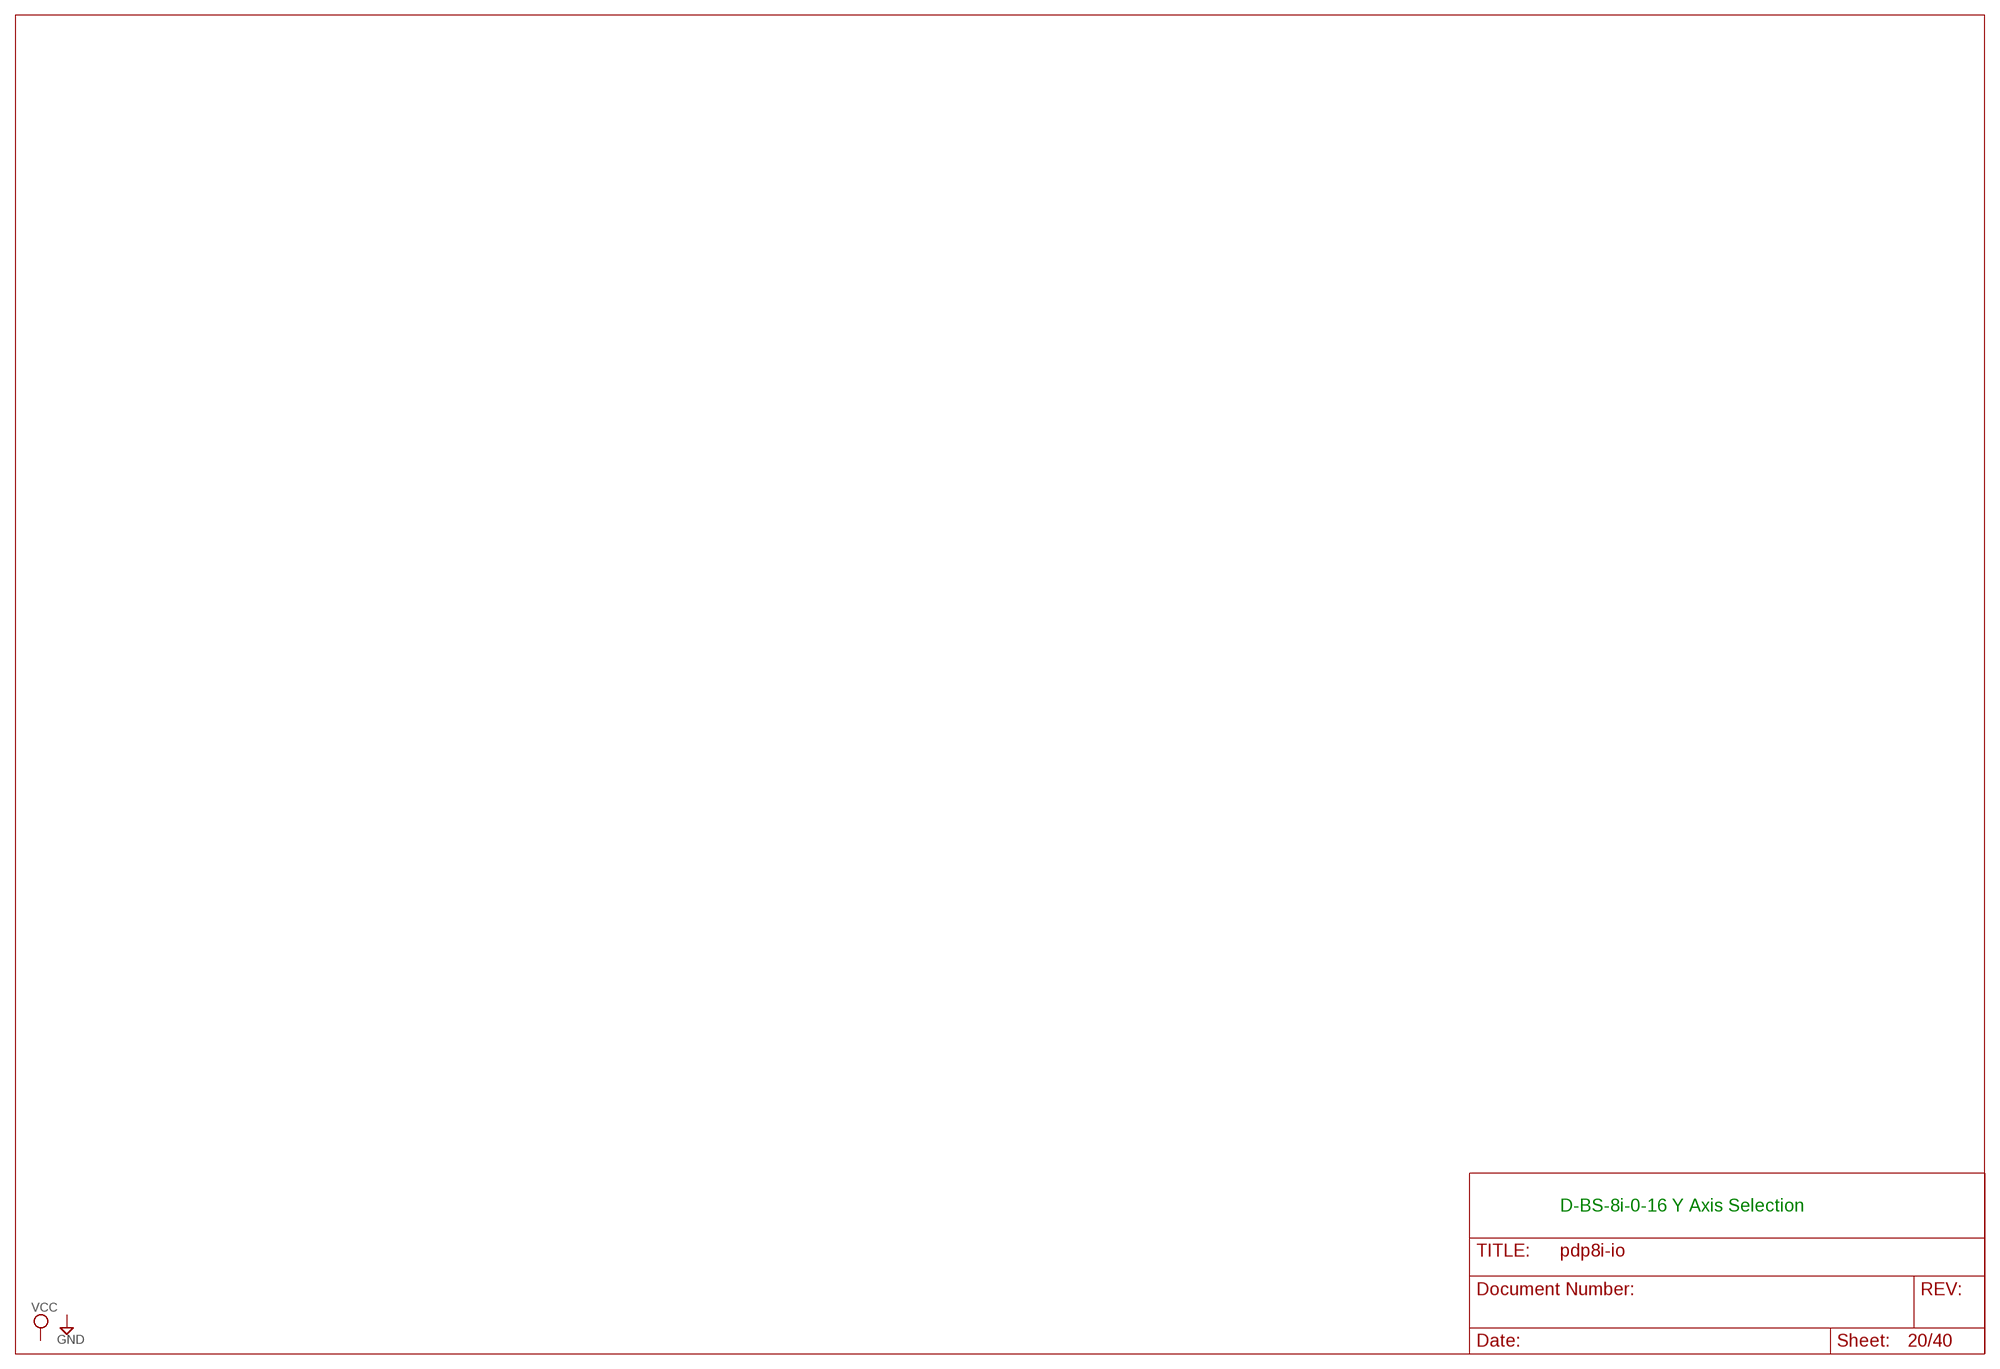
[diagram p19: schematic, sheet 20]

### Notes on the sheet
- D-BS-8i-0-16 Y Axis Selection

## Sheet 21 of 40
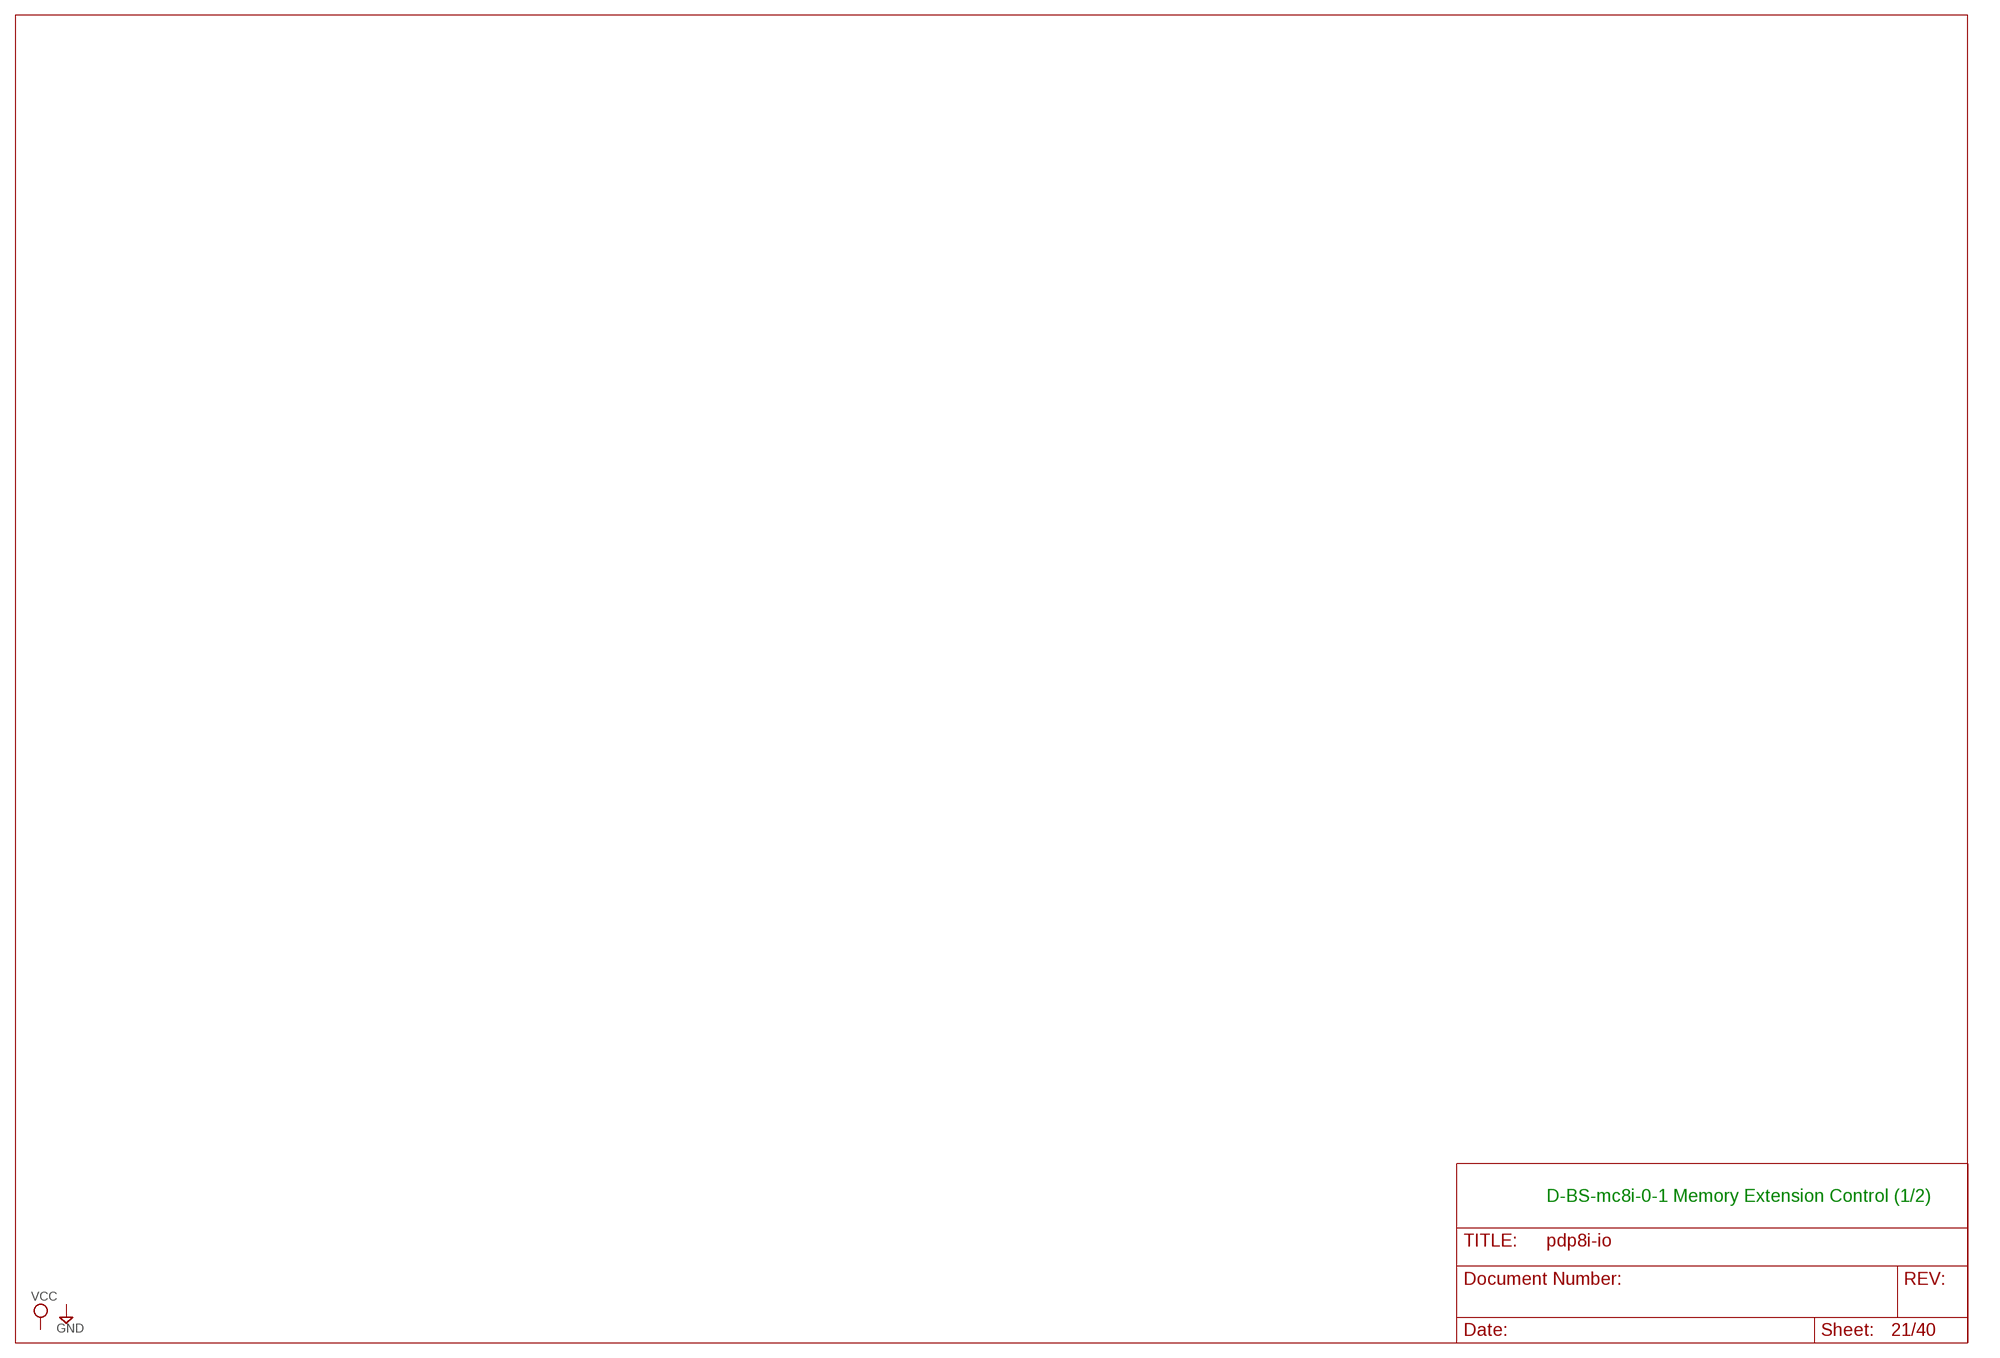
[diagram p20: schematic, sheet 21]

### Notes on the sheet
- D-BS-mc8i-0-1 Memory Extension Control (1/2)

## Sheet 22 of 40
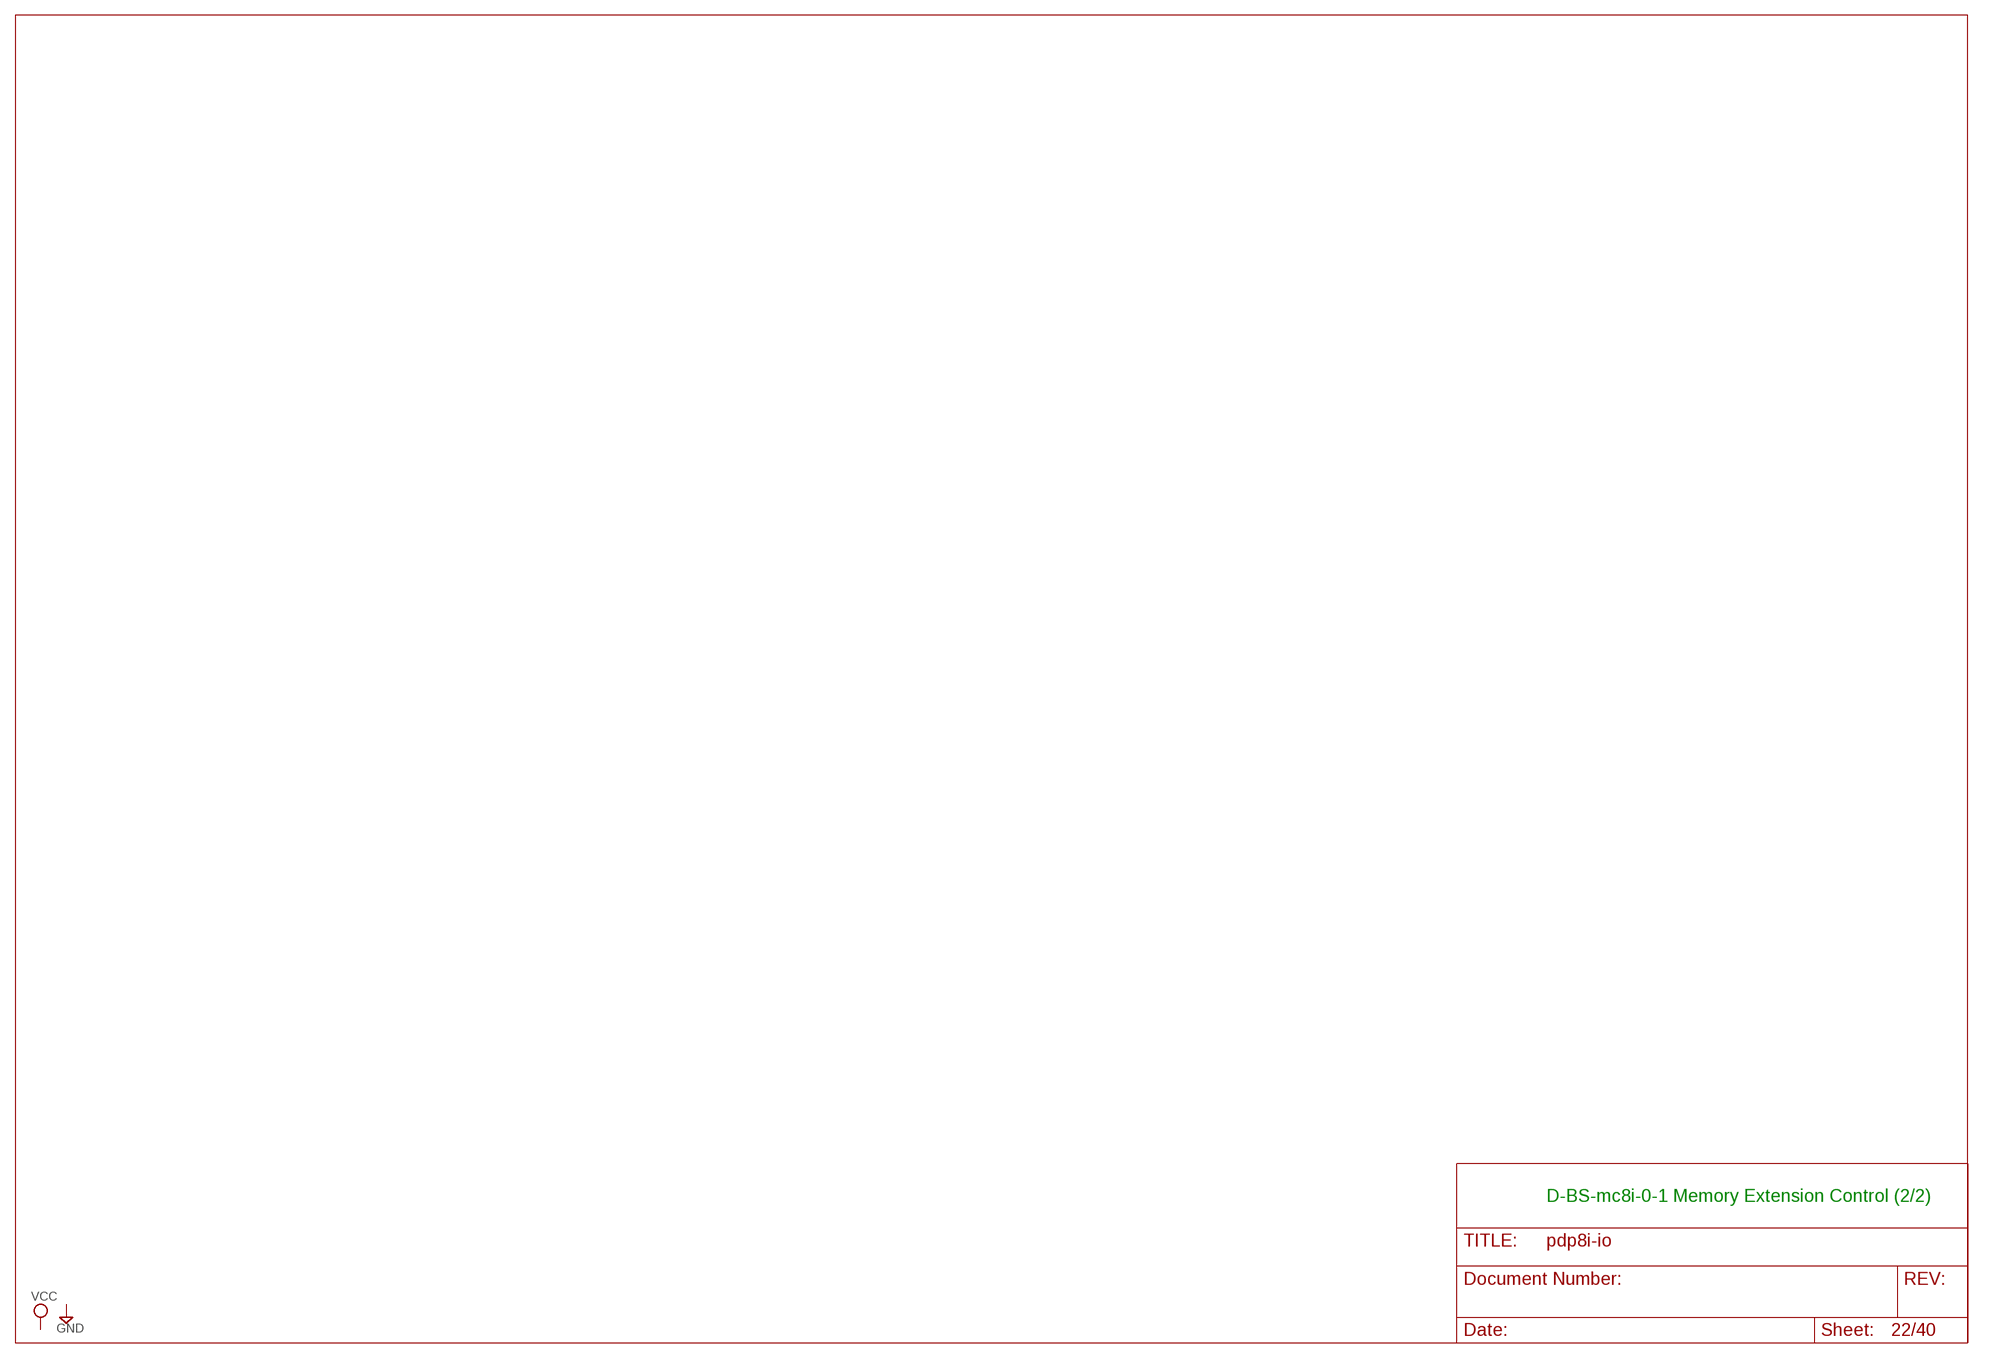
[diagram p21: schematic, sheet 22]

### Notes on the sheet
- D-BS-mc8i-0-1 Memory Extension Control (2/2)

## Sheet 23 of 40
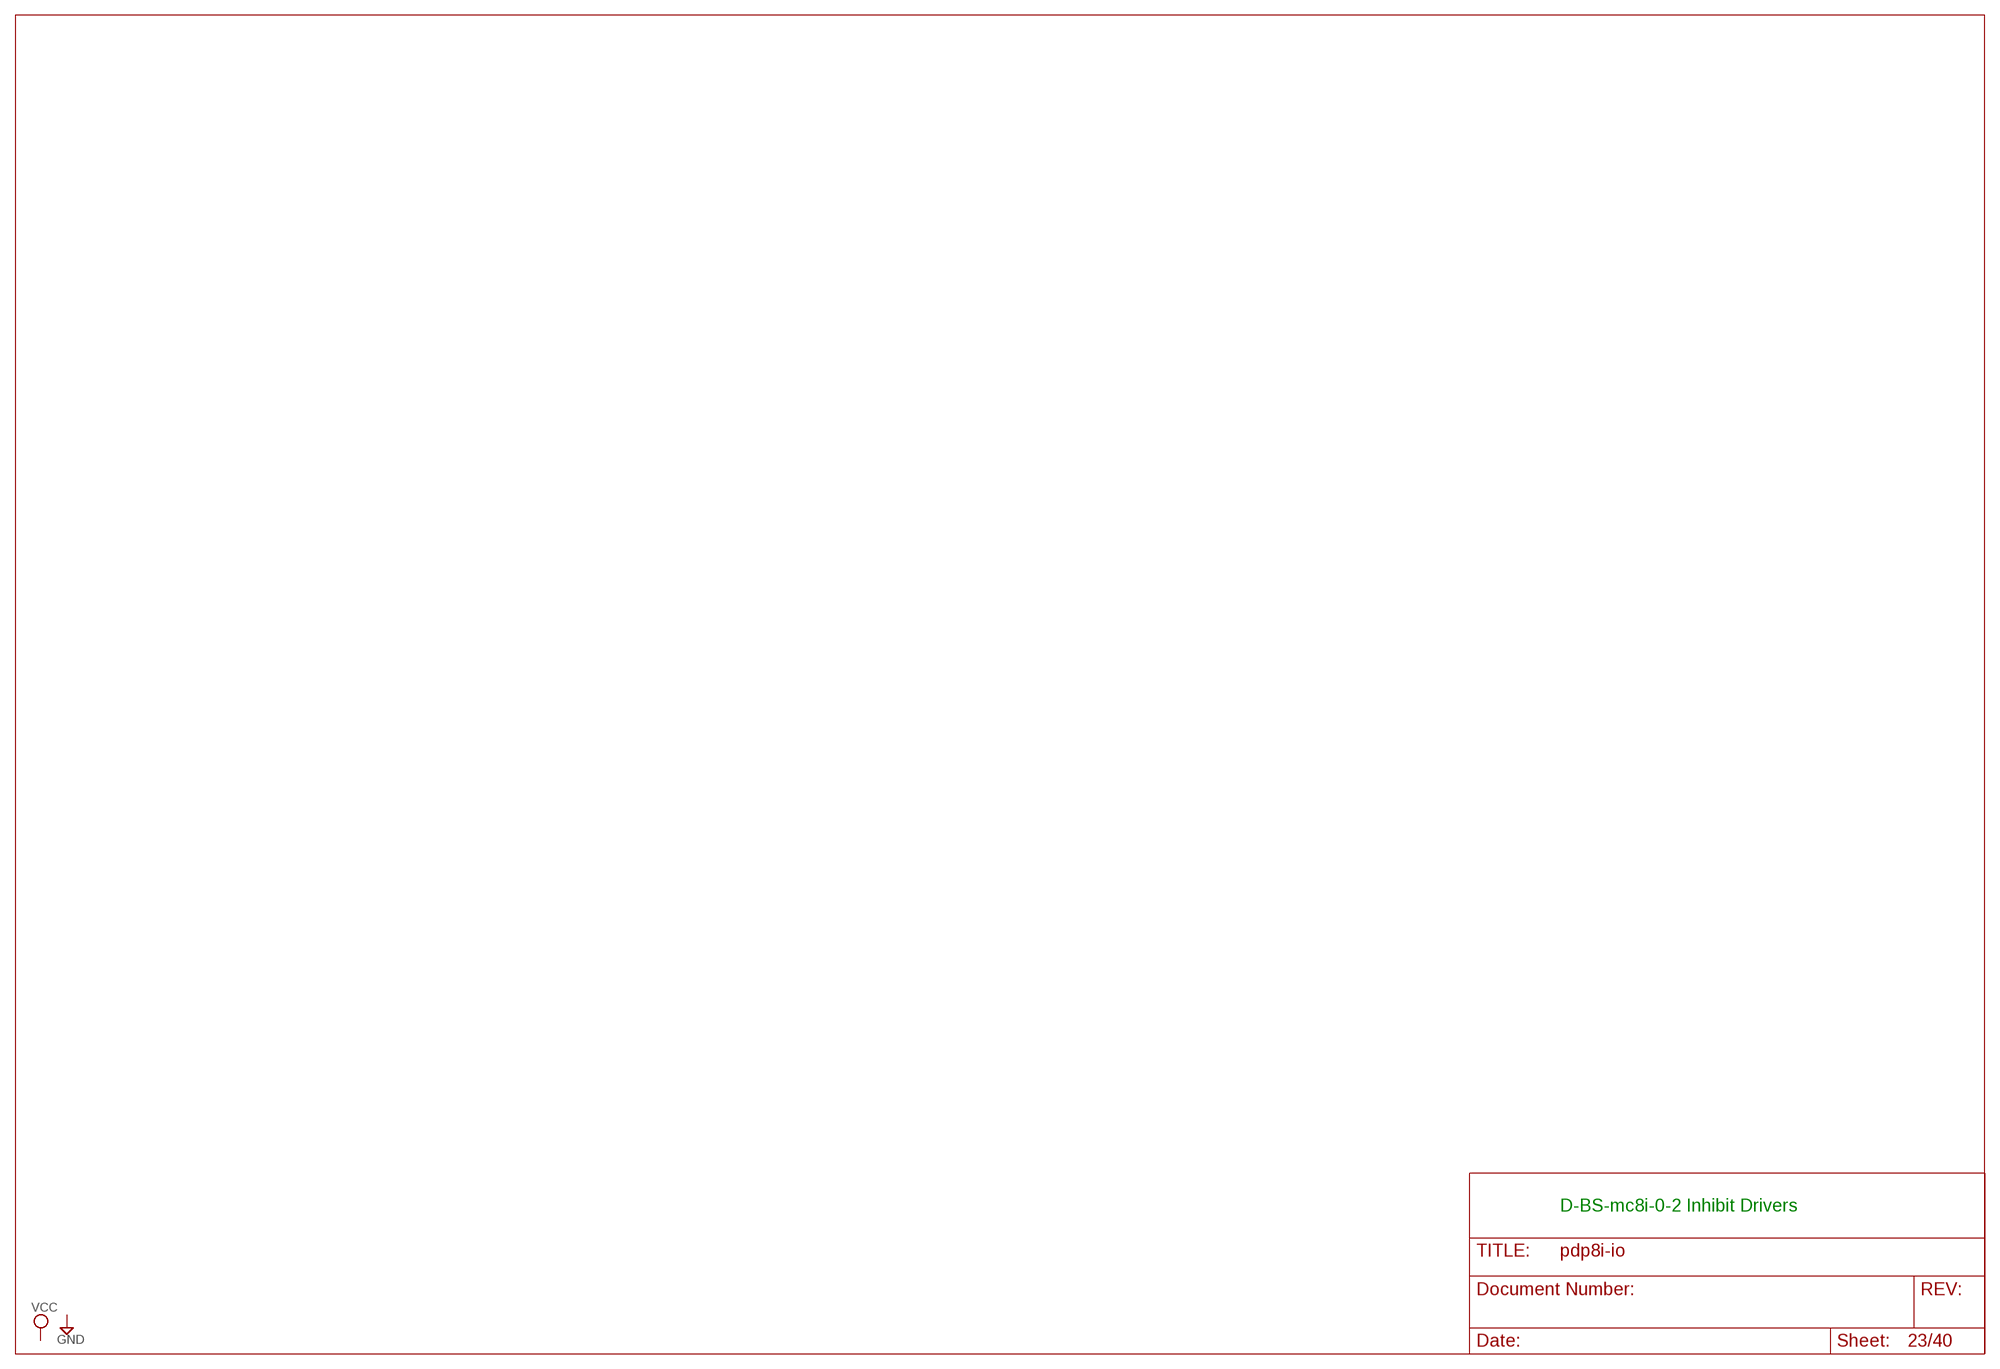
[diagram p22: schematic, sheet 23]

### Notes on the sheet
- D-BS-mc8i-0-2 Inhibit Drivers

## Sheet 24 of 40
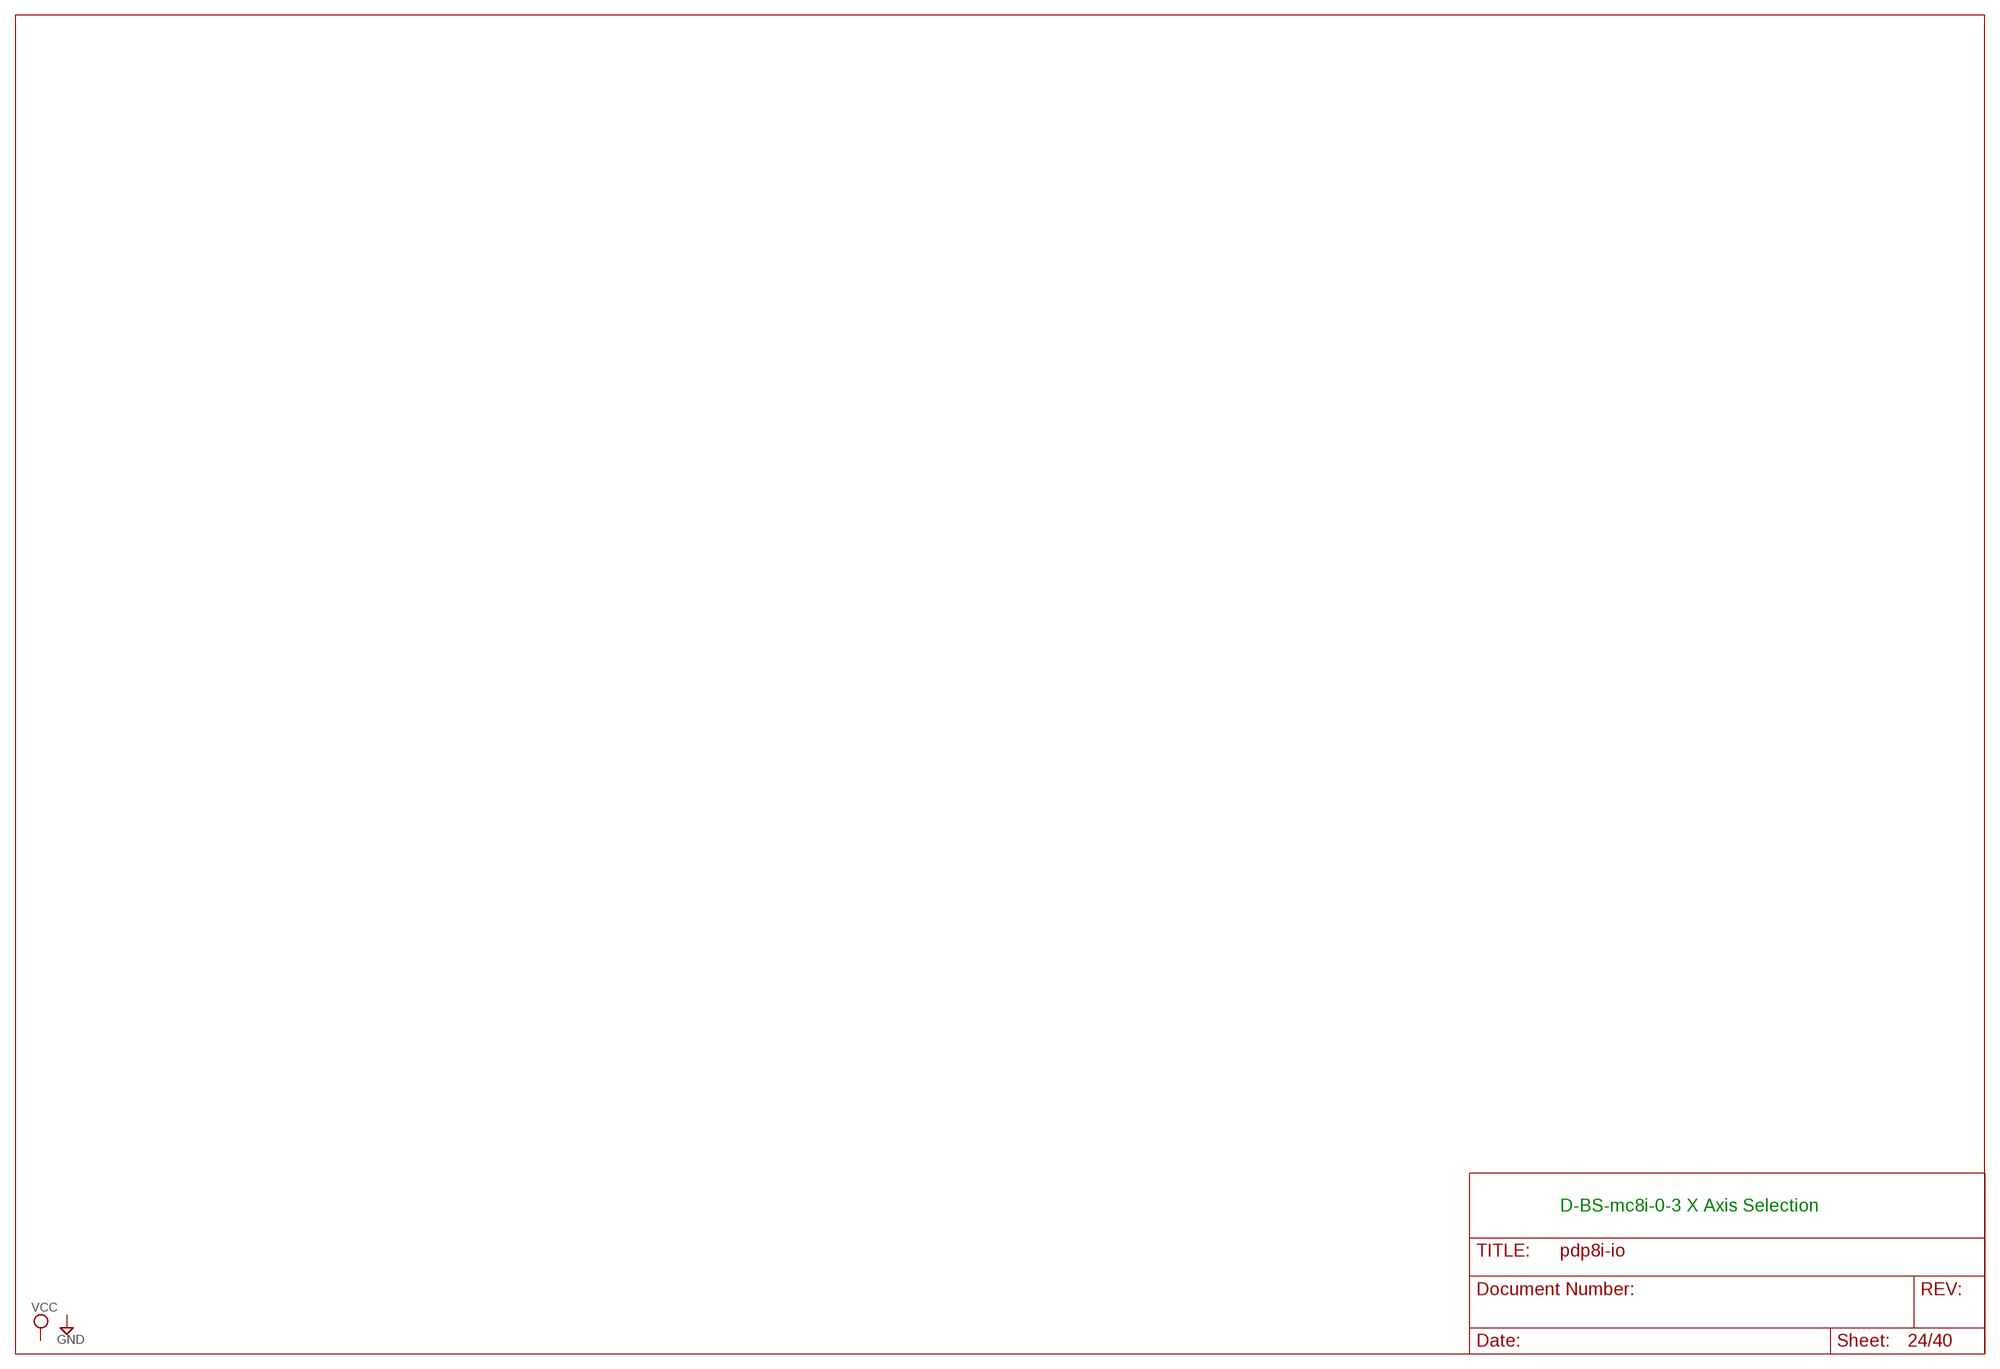
[diagram p23: schematic, sheet 24]

### Notes on the sheet
- D-BS-mc8i-0-3 X Axis Selection